# EAGLE schematic xio (EAGLE 9.1.0), part 1 of 2

## Sheet 1 of 16: Block diagram
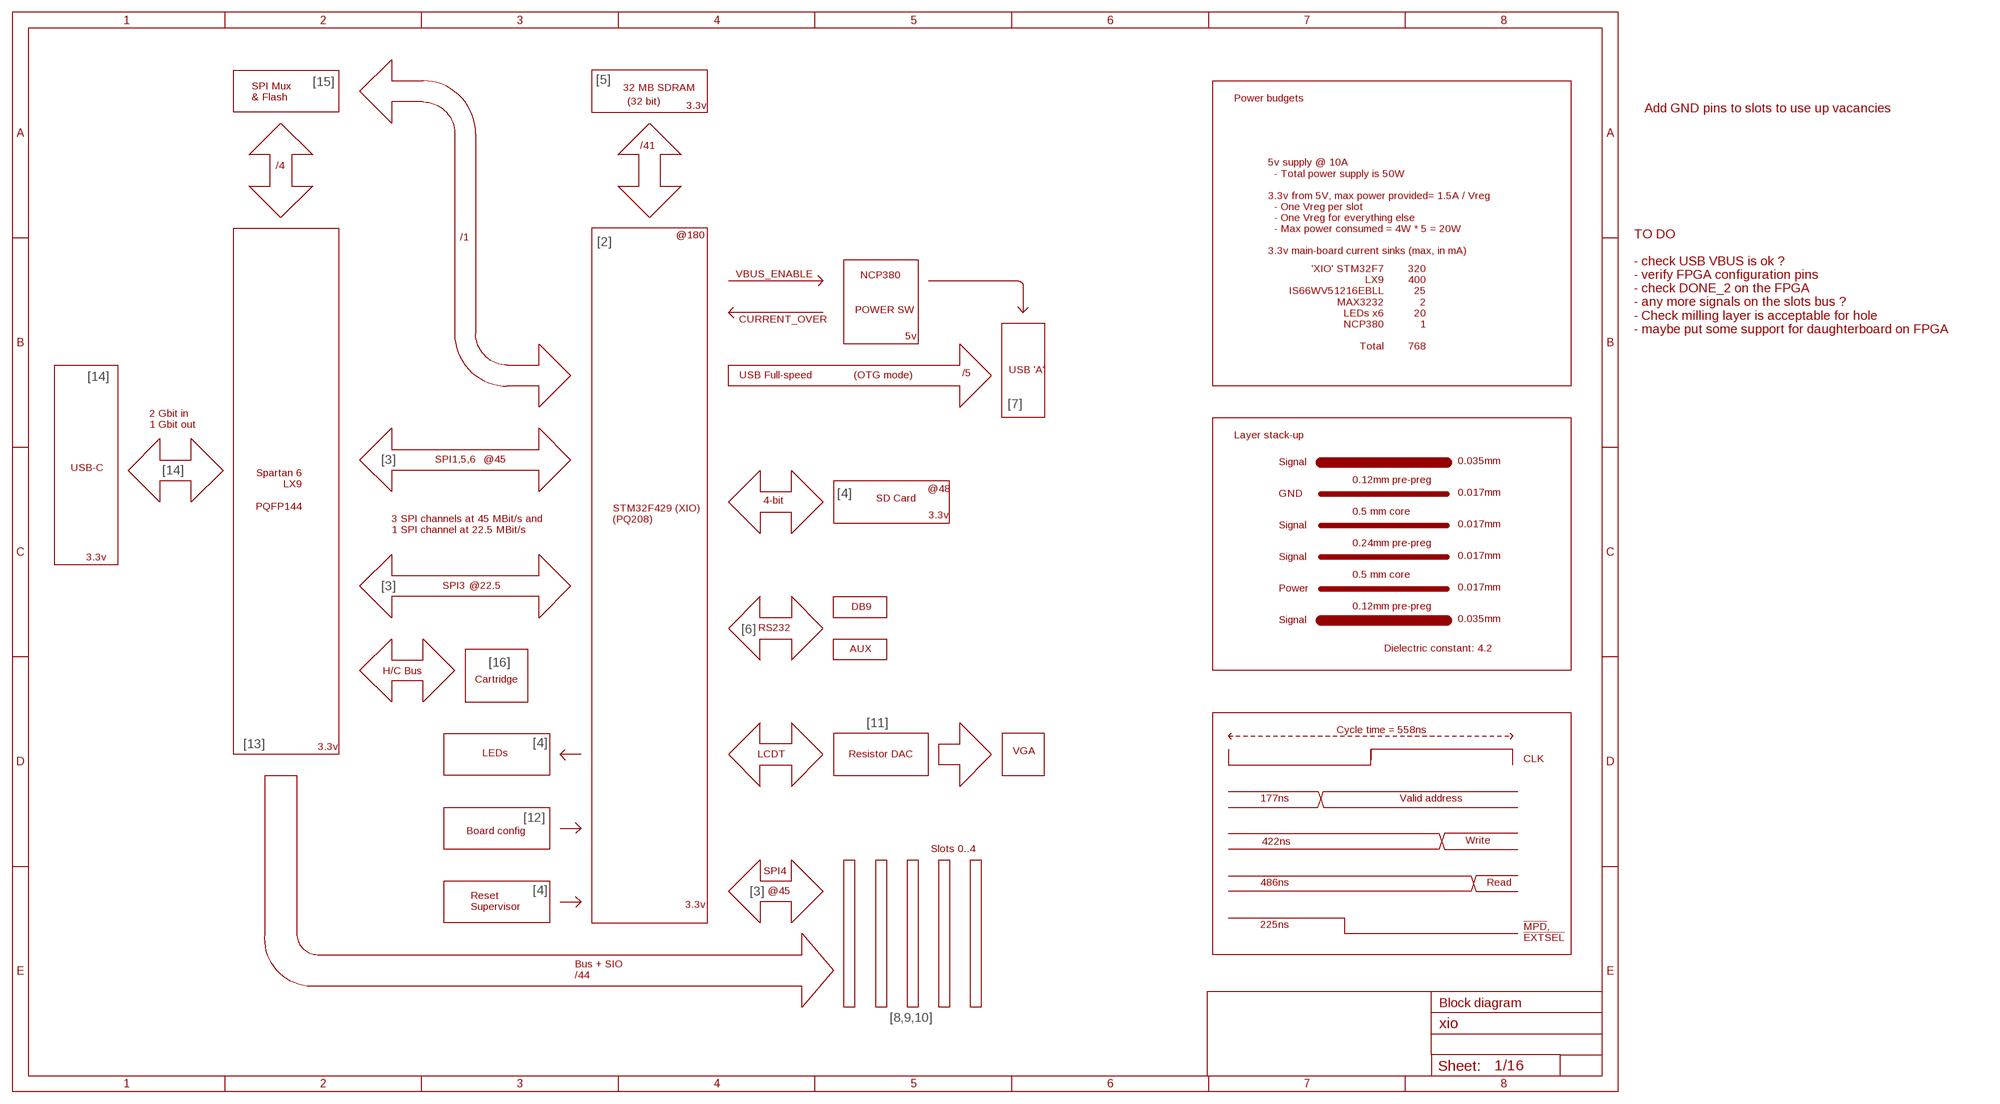
[diagram p0: schematic, sheet 1]

### Notes on the sheet
- [15] | [5]
- 32 MB SDRAM
- SPI Mux
  & Flash
- Power budgets
- (32 bit)
- 3.3v
- Add GND pins to slots to use up vacancies
- /41
- /4
- /1 | @180
- [2]
- 5v supply @ 10A
    - Total power supply is 50W
  
  3.3v from 5V, max power provided= 1.5A / Vreg
    - One Vreg per slot
    - One Vreg for everything else
    - Max power consumed = 4W * 5 = 20W 
  
  3.3v main-board current sinks (max, in mA)
- 'XIO' STM32F7
  LX9
  IS66WV51216EBLL
  MAX3232
  LEDs x6
  NCP380
  
  Total
- 320
  400
  25
  2
  20
  1
  
  768
- VBUS_ENABLE
- NCP380
- POWER SW
- CURRENT_OVER
- TO DO
  
  - check USB VBUS is ok ?
  - verify FPGA configuration pins
  - check DONE_2 on the FPGA
  - any more signals on the slots bus ?
  - Check milling layer is acceptable for hole
  - maybe put some support for daughterboard on FPGA
- 5v
- USB 'A'
- USB Full-speed | (OTG mode) | /5
- [14]
- [7]
- 2 Gbit in
  1 Gbit out
- Layer stack-up
- SPI1,5,6 | @45
- [3] | Signal | 0.035mm
- Spartan 6
      LX9
  
   PQFP144
- USB-C
- [14]
- 0.12mm pre-preg
- @48
- [4] | GND | 0.017mm
- 4-bit | SD Card
- 0.5 mm core
- 3.3v
- STM32F429 (XIO)
  (PQ208)
- Signal | 0.017mm
- 3 SPI channels at 45 MBit/s and
  1 SPI channel at 22.5 MBit/s
- 0.24mm pre-preg
- 3.3v | Signal | 0.017mm
- 0.5 mm core
- SPI3 | @22.5
- [3] | Power | 0.017mm
- DB9 | 0.12mm pre-preg
- Signal | 0.035mm
- [6] | RS232
- AUX | Dielectric constant: 4.2
- [16]
- H/C Bus
- Cartridge
- [11]
- Cycle time = 558ns
- [13] | [4]
- 3.3v
- LEDs | VGA
- LCDT | Resistor DAC
- CLK
- 177ns | Valid address
- [12]
- Board config
- 422ns | Write
- Slots 0..4
- SPI4
- @45 | 486ns | Read
- [4] | [3]
- 3.3v
- Reset
  Supervisor
- 225ns
- !MPD!,
  !EXTSEL!
- Bus + SIO
  /44
- Block diagram
- [8,9,10]

## Sheet 2 of 16: XIO Power
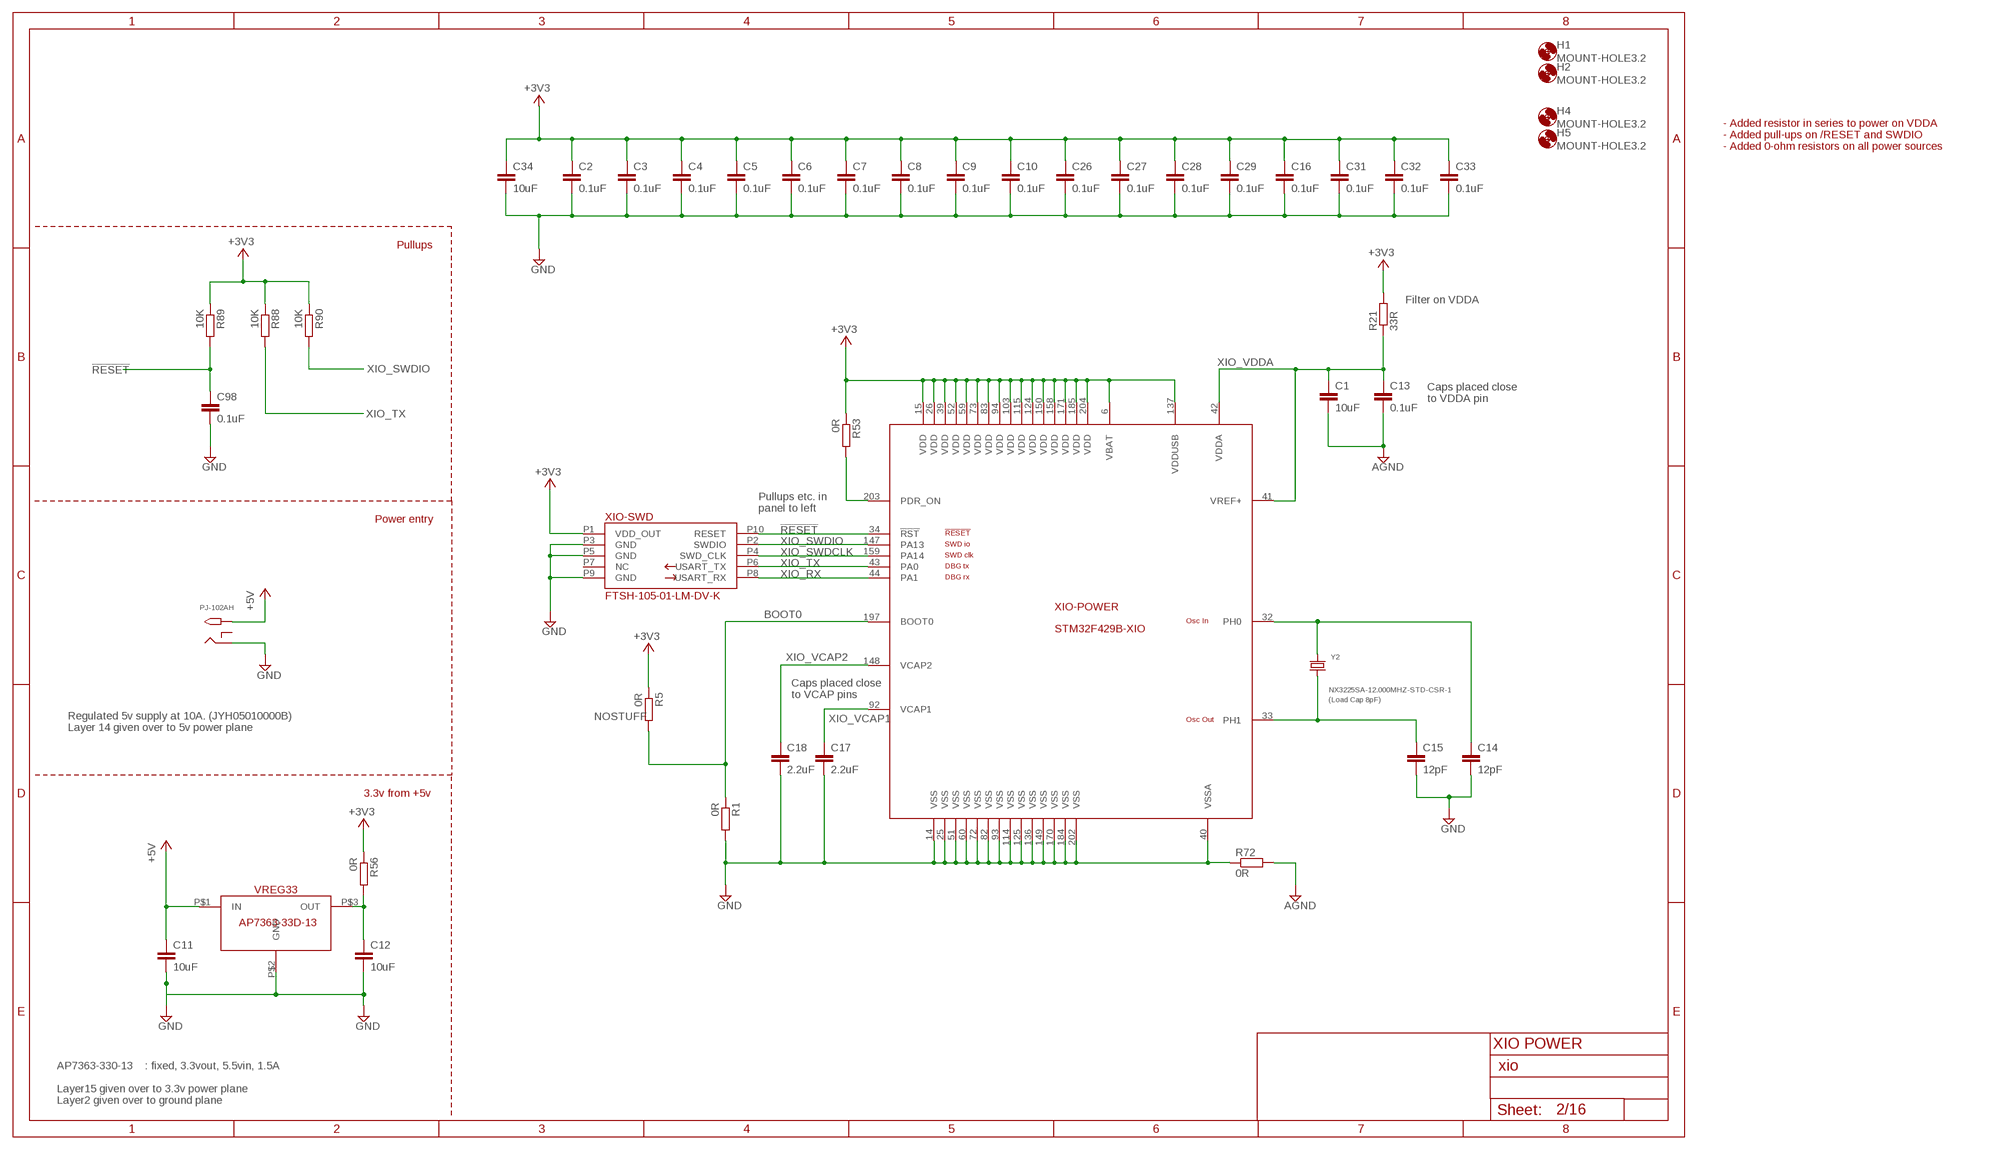
[diagram p1: schematic, sheet 2]

### Parts
C1  10uF  C-EUC0402K  [C0402K]
C2  0.1uF  C-EUC0402K  [C0402K]
C3  0.1uF  C-EUC0402K  [C0402K]
C4  0.1uF  C-EUC0402K  [C0402K]
C5  0.1uF  C-EUC0402K  [C0402K]
C6  0.1uF  C-EUC0402K  [C0402K]
C7  0.1uF  C-EUC0402K  [C0402K]
C8  0.1uF  C-EUC0402K  [C0402K]
C9  0.1uF  C-EUC0402K  [C0402K]
C10  0.1uF  C-EUC0402K  [C0402K]
C11  10uF  C-EUC0402K  [C0402K]
C12  10uF  C-EUC0402K  [C0402K]
C13  0.1uF  C-EUC0402K  [C0402K]
C14  12pF  C-EUC0402K  [C0402K]
C15  12pF  C-EUC0402K  [C0402K]
C16  0.1uF  C-EUC0402K  [C0402K]
C17  2.2uF  C-EUC0402K  [C0402K]
C18  2.2uF  C-EUC0402K  [C0402K]
C26  0.1uF  C-EUC0402K  [C0402K]
C27  0.1uF  C-EUC0402K  [C0402K]
C28  0.1uF  C-EUC0402K  [C0402K]
C29  0.1uF  C-EUC0402K  [C0402K]
C31  0.1uF  C-EUC0402K  [C0402K]
C32  0.1uF  C-EUC0402K  [C0402K]
C33  0.1uF  C-EUC0402K  [C0402K]
C34  10uF  C-EUC0402K  [C0402K]
C98  0.1uF  C-EUC0402K  [C0402K]
H1  MOUNT-HOLE3.2  [3,2]
H2  MOUNT-HOLE3.2  [3,2]
H4  MOUNT-HOLE3.2  [3,2]
H5  MOUNT-HOLE3.2  [3,2]
PJ-102AH  PJ-102AH  2.1MMJACKTHM  [PJ-102A]
R1  0R  R-EU_R0402  [R0402]
R5  0R  R-EU_R0402  [R0402]
R21  33R  R-EU_R0402  [R0402]
R53  0R  R-EU_R0402  [R0402]
R56  0R  R-EU_R0402  [R0402]
R72  0R  R-EU_R0402  [R0402]
R88  10K  R-EU_R0402  [R0402]
R89  10K  R-EU_R0402  [R0402]
R90  10K  R-EU_R0402  [R0402]
VREG33  AP7363-33D-13  AP7363  [TO252-3L]
XIO  STM32F429B-XIO  [PQFP208]
XIO-SWD  FTSH-105-01-LM-DV-K  STM_DEBUG  [SWD_DEBUG]
Y2  NX3225SA-12.000MHZ-STD-CSR-1  CRYSTALTHIN  [CRYSTAL_3.2X2.5]

### Nets
!RESET!: C98.1 R89.2 XIO-SWD.P10(RESET) XIO.34(-POWER:!RST!) ; also sheet 4
+3V3 [3v3]: C2.1 C3.1 C4.1 C5.1 C6.1 C7.1 C8.1 C9.1 C10.1 C16.1 C26.1 C27.1 C28.1 C29.1 C31.1 C32.1 C33.1 C34.1 R5.1 R21.2 R53.1 R56.1 R88.1 R89.1 R90.1 XIO-SWD.P1(VDD_OUT) XIO.6(-POWER:VBAT) XIO.15(-POWER:VDD) XIO.26(-POWER:VDD) XIO.39(-POWER:VDD) XIO.52(-POWER:VDD) XIO.59(-POWER:VDD) XIO.73(-POWER:VDD) XIO.83(-POWER:VDD) XIO.94(-POWER:VDD) XIO.103(-POWER:VDD) XIO.115(-POWER:VDD) XIO.124(-POWER:VDD) XIO.137(-POWER:VDDUSB) XIO.150(-POWER:VDD) XIO.158(-POWER:VDD) XIO.171(-POWER:VDD) XIO.185(-POWER:VDD) XIO.204(-POWER:VDD) ; also sheet 4,5,6,11,12,13,14,15,16
+5V: C11.1 PJ-102AH.TIP VREG33.P$1(IN) ; also sheet 7,8,9,10,11,16
AGND: C1.2 C13.2 R72.2
BOOT0: R1.1 R5.2 XIO.197(-POWER:BOOT0)
GND: C2.2 C3.2 C4.2 C5.2 C6.2 C7.2 C8.2 C9.2 C10.2 C11.2 C12.2 C14.2 C15.2 C16.2 C17.2 C18.2 C26.2 C27.2 C28.2 C29.2 C31.2 C32.2 C33.2 C34.2 C98.2 PJ-102AH.RING R1.2 R72.1 VREG33.P$2(GND) XIO-SWD.P3(GND) XIO-SWD.P5(GND) XIO-SWD.P9(GND) XIO.14(-POWER:VSS) XIO.25(-POWER:VSS) XIO.40(-POWER:VSSA) XIO.51(-POWER:VSS) XIO.60(-POWER:VSS) XIO.72(-POWER:VSS) XIO.82(-POWER:VSS) XIO.93(-POWER:VSS) XIO.114(-POWER:VSS) XIO.125(-POWER:VSS) XIO.136(-POWER:VSS) XIO.149(-POWER:VSS) XIO.170(-POWER:VSS) XIO.184(-POWER:VSS) XIO.202(-POWER:VSS) ; also sheet 4,5,6,7,8,9,10,11,12,13,14,15,16
N$1: C15.1 XIO.33(-POWER:PH1) Y2.1
N$2: C14.1 XIO.32(-POWER:PH0) Y2.2
N$9: C12.1 R56.2 VREG33.P$3(OUT)
PDR_ON: R53.2 XIO.203(-POWER:PDR_ON)
XIO_RX: XIO-SWD.P8(USART_RX) XIO.44(-POWER:PA1)
XIO_SWDCLK: XIO-SWD.P4(SWD_CLK) XIO.159(-POWER:PA14)
XIO_SWDIO: R90.2 XIO-SWD.P2(SWDIO) XIO.147(-POWER:PA13)
XIO_TX: R88.2 XIO-SWD.P6(USART_TX) XIO.43(-POWER:PA0)
XIO_VCAP1: C17.1 XIO.92(-POWER:VCAP1)
XIO_VCAP2: C18.1 XIO.148(-POWER:VCAP2)
XIO_VDDA: C1.1 C13.1 R21.1 XIO.41(-POWER:VREF+) XIO.42(-POWER:VDDA)
Unconnected: PJ-102AH.RING_SW XIO-SWD.P7(NC)

### Notes on the sheet
- - Added resistor in series to power on VDDA
  - Added pull-ups on /RESET and SWDIO
  - Added 0-ohm resistors on all power sources
- Pullups
- Filter on VDDA
- Caps placed close 
  to VDDA pin
- Pullups etc. in
  panel to left
- Power entry
- Caps placed close 
  to VCAP pins
- (Load Cap 8pF)
- Regulated 5v supply at 10A. (JYH05010000B)
  Layer 14 given over to 5v power plane
- 3.3v from +5v
- XIO POWER
- AP7363-330-13    : fixed, 3.3vout, 5.5vin, 1.5A
  
  Layer15 given over to 3.3v power plane
  Layer2 given over to ground plane

## Sheet 3 of 16: XIO SPI, IO-BUS
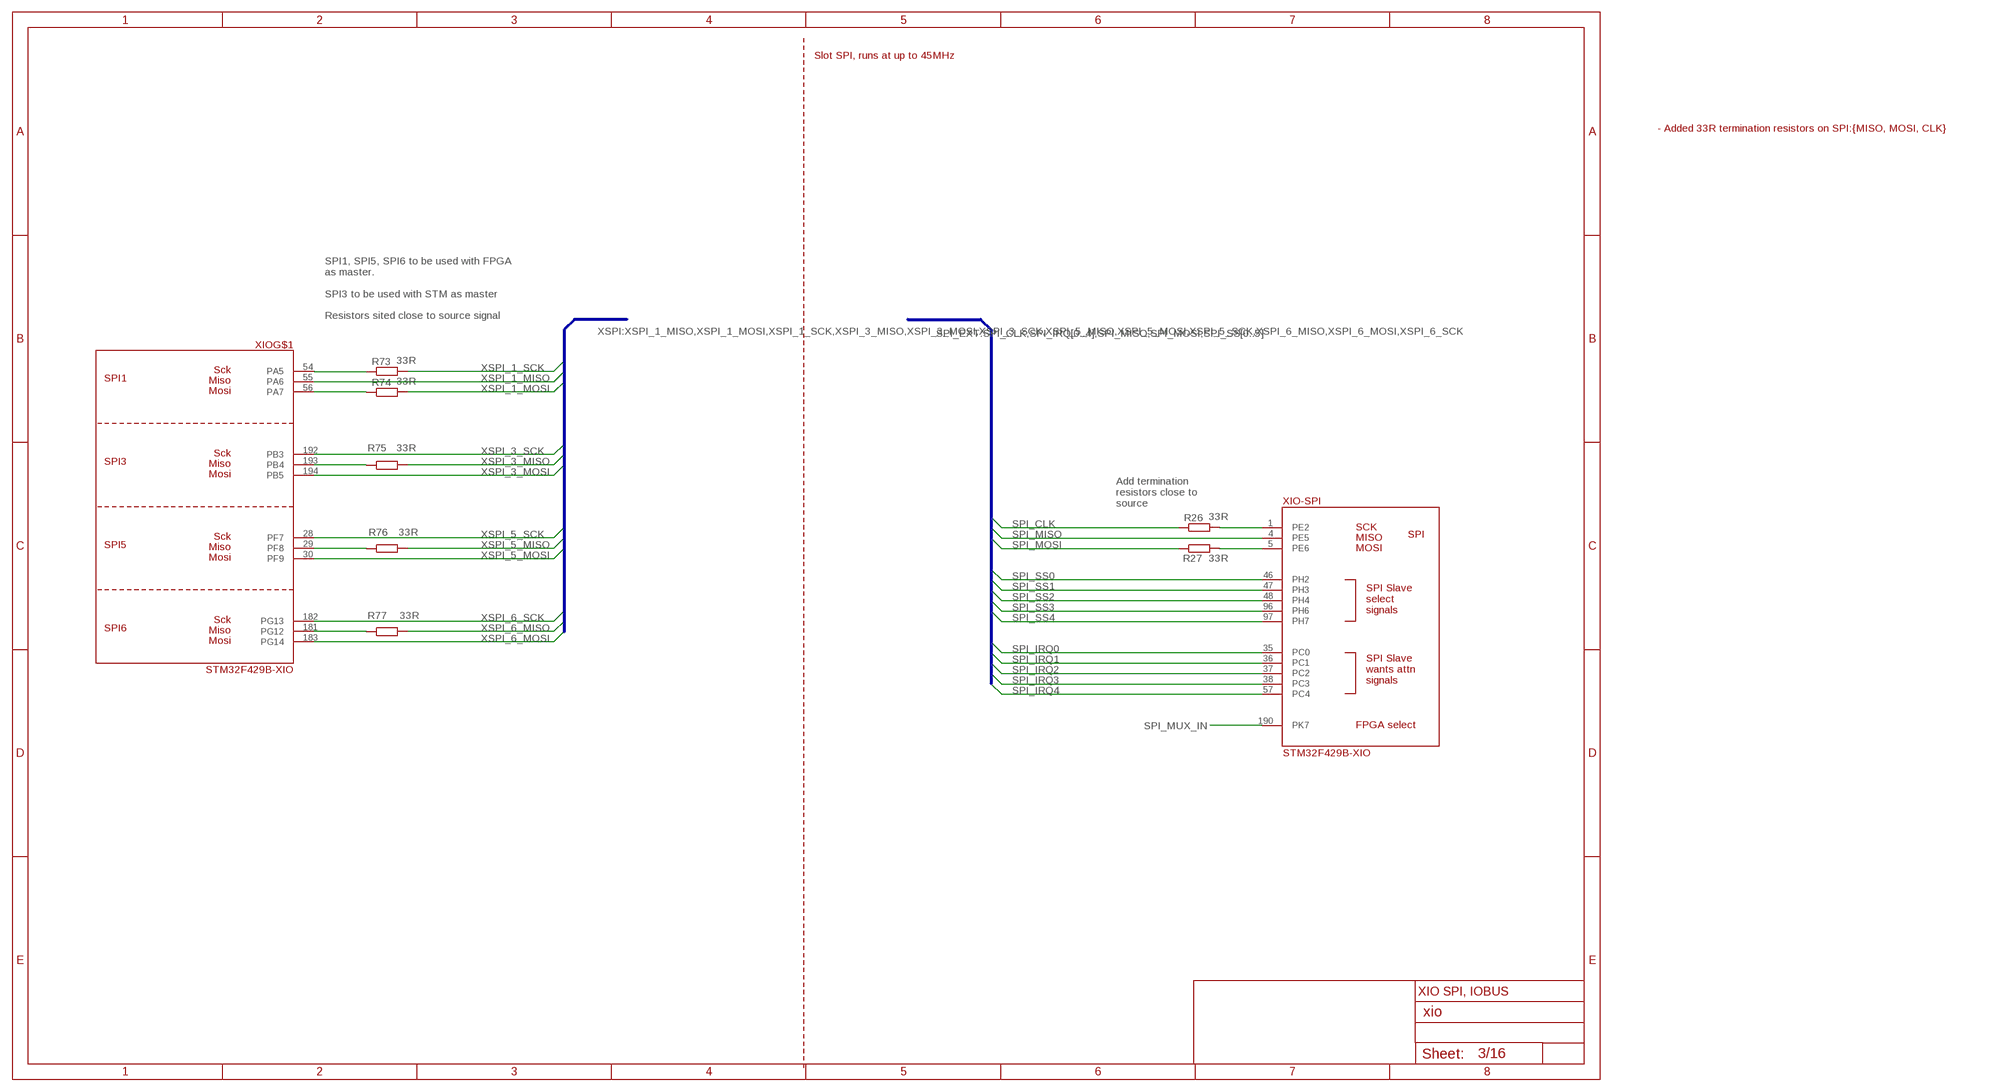
[diagram p2: schematic, sheet 3]

### Parts
R26  33R  R-EU_R0402  [R0402]
R27  33R  R-EU_R0402  [R0402]
R73  33R  R-EU_R0402  [R0402]
R74  33R  R-EU_R0402  [R0402]
R75  33R  R-EU_R0402  [R0402]
R76  33R  R-EU_R0402  [R0402]
R77  33R  R-EU_R0402  [R0402]

### Nets
N$57: R26.2 XIO.1(-SPI:PE2)
N$61: R27.2 XIO.5(-SPI:PE6)
N$72: R75.1 XIO.193(PB4)
N$73: R76.1 XIO.29(PF8)
N$74: R77.1 XIO.181(PG12)
N$75: R73.1 XIO.54(PA5)
N$76: R74.1 XIO.56(PA7)
SPI_CLK: R26.1 ; also sheet 8,9,10,15
SPI_IRQ0: XIO.35(-SPI:PC0) ; also sheet 8
SPI_IRQ1: XIO.36(-SPI:PC1) ; also sheet 8
SPI_IRQ2: XIO.37(-SPI:PC2) ; also sheet 9
SPI_IRQ3: XIO.38(-SPI:PC3) ; also sheet 9
SPI_IRQ4: XIO.57(-SPI:PC4) ; also sheet 10
SPI_MISO: XIO.4(-SPI:PE5) ; also sheet 8,9,10,15
SPI_MOSI: R27.1 ; also sheet 8,9,10,15
SPI_MUX_IN: XIO.190(-SPI:PK7) ; also sheet 15
SPI_SS0: XIO.46(-SPI:PH2) ; also sheet 8
SPI_SS1: XIO.47(-SPI:PH3) ; also sheet 8
SPI_SS2: XIO.48(-SPI:PH4) ; also sheet 9
SPI_SS3: XIO.96(-SPI:PH6) ; also sheet 9
SPI_SS4: XIO.97(-SPI:PH7) ; also sheet 10
XSPI_1_MISO: XIO.55(PA6) ; also sheet 14
XSPI_1_MOSI: R74.2 ; also sheet 14
XSPI_1_SCK: R73.2 ; also sheet 14
XSPI_3_MISO: R75.2 ; also sheet 14
XSPI_3_MOSI: XIO.194(PB5) ; also sheet 14
XSPI_3_SCK: XIO.192(PB3) ; also sheet 14
XSPI_5_MISO: R76.2 ; also sheet 14
XSPI_5_MOSI: XIO.30(PF9) ; also sheet 14
XSPI_5_SCK: XIO.28(PF7) ; also sheet 14
XSPI_6_MISO: R77.2 ; also sheet 14
XSPI_6_MOSI: XIO.183(PG14) ; also sheet 14
XSPI_6_SCK: XIO.182(PG13) ; also sheet 14

### Buses
SPI_EXT:SPI_CLK,SPI_IRQ[0..4],SPI_MISO,SPI_MOSI,SPI_SS[0..5]
XSPI:XSPI_1_MISO,XSPI_1_MOSI,XSPI_1_SCK,XSPI_3_MISO,XSPI_3_MOSI,XSPI_3_SCK,XSPI_5_MISO,XSPI_5_MOSI,XSPI_5_SCK,XSPI_6_MISO,XSPI_6_MOSI,XSPI_6_SCK

### Notes on the sheet
- Slot SPI, runs at up to 45MHz
- - Added 33R termination resistors on SPI:{MISO, MOSI, CLK}
- SPI1, SPI5, SPI6 to be used with FPGA
  as master. 
  
  SPI3 to be used with STM as master
  
  Resistors sited close to source signal
- Add termination 
  resistors close to
  source
- XIO SPI, IOBUS

## Sheet 4 of 16: Reset / GPIO / Leds / SD card
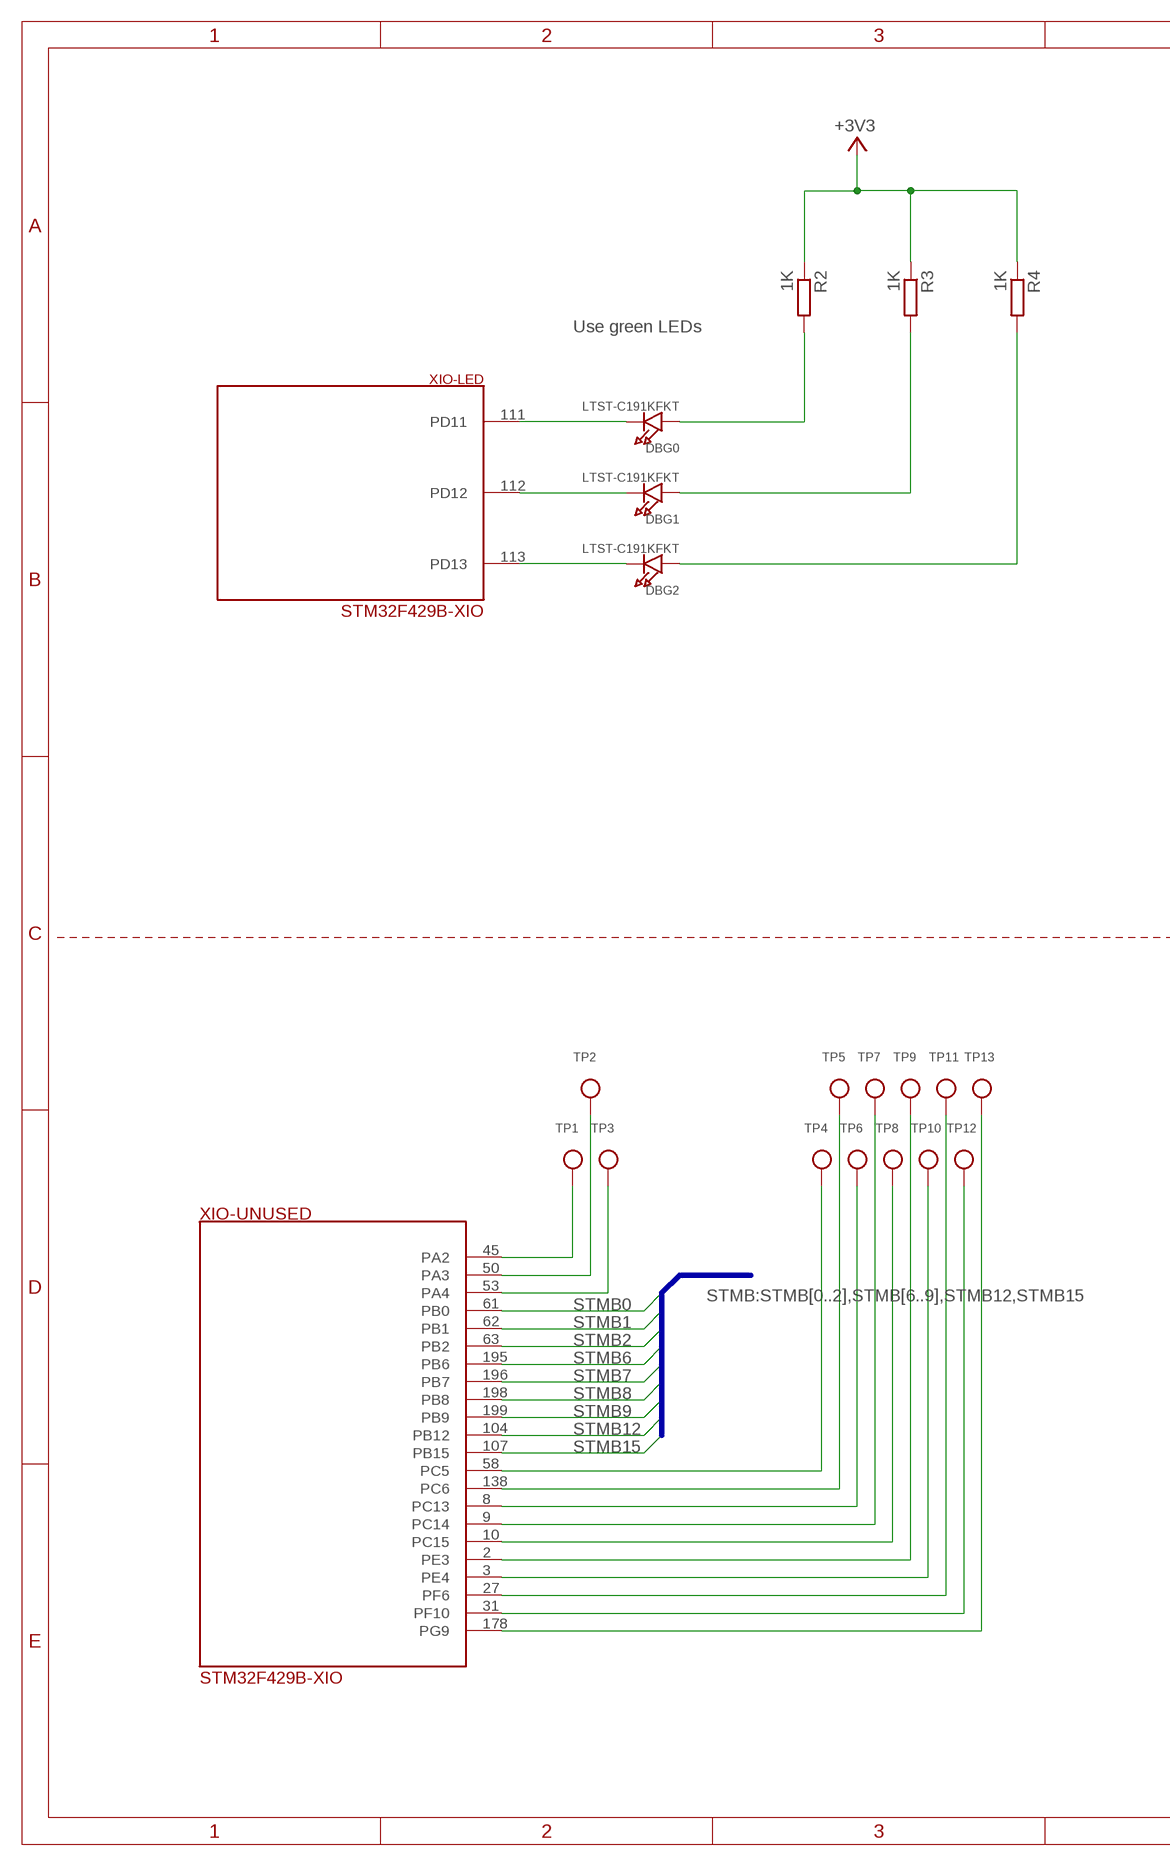
[diagram p3: schematic, sheet 4, part 1 of 2]
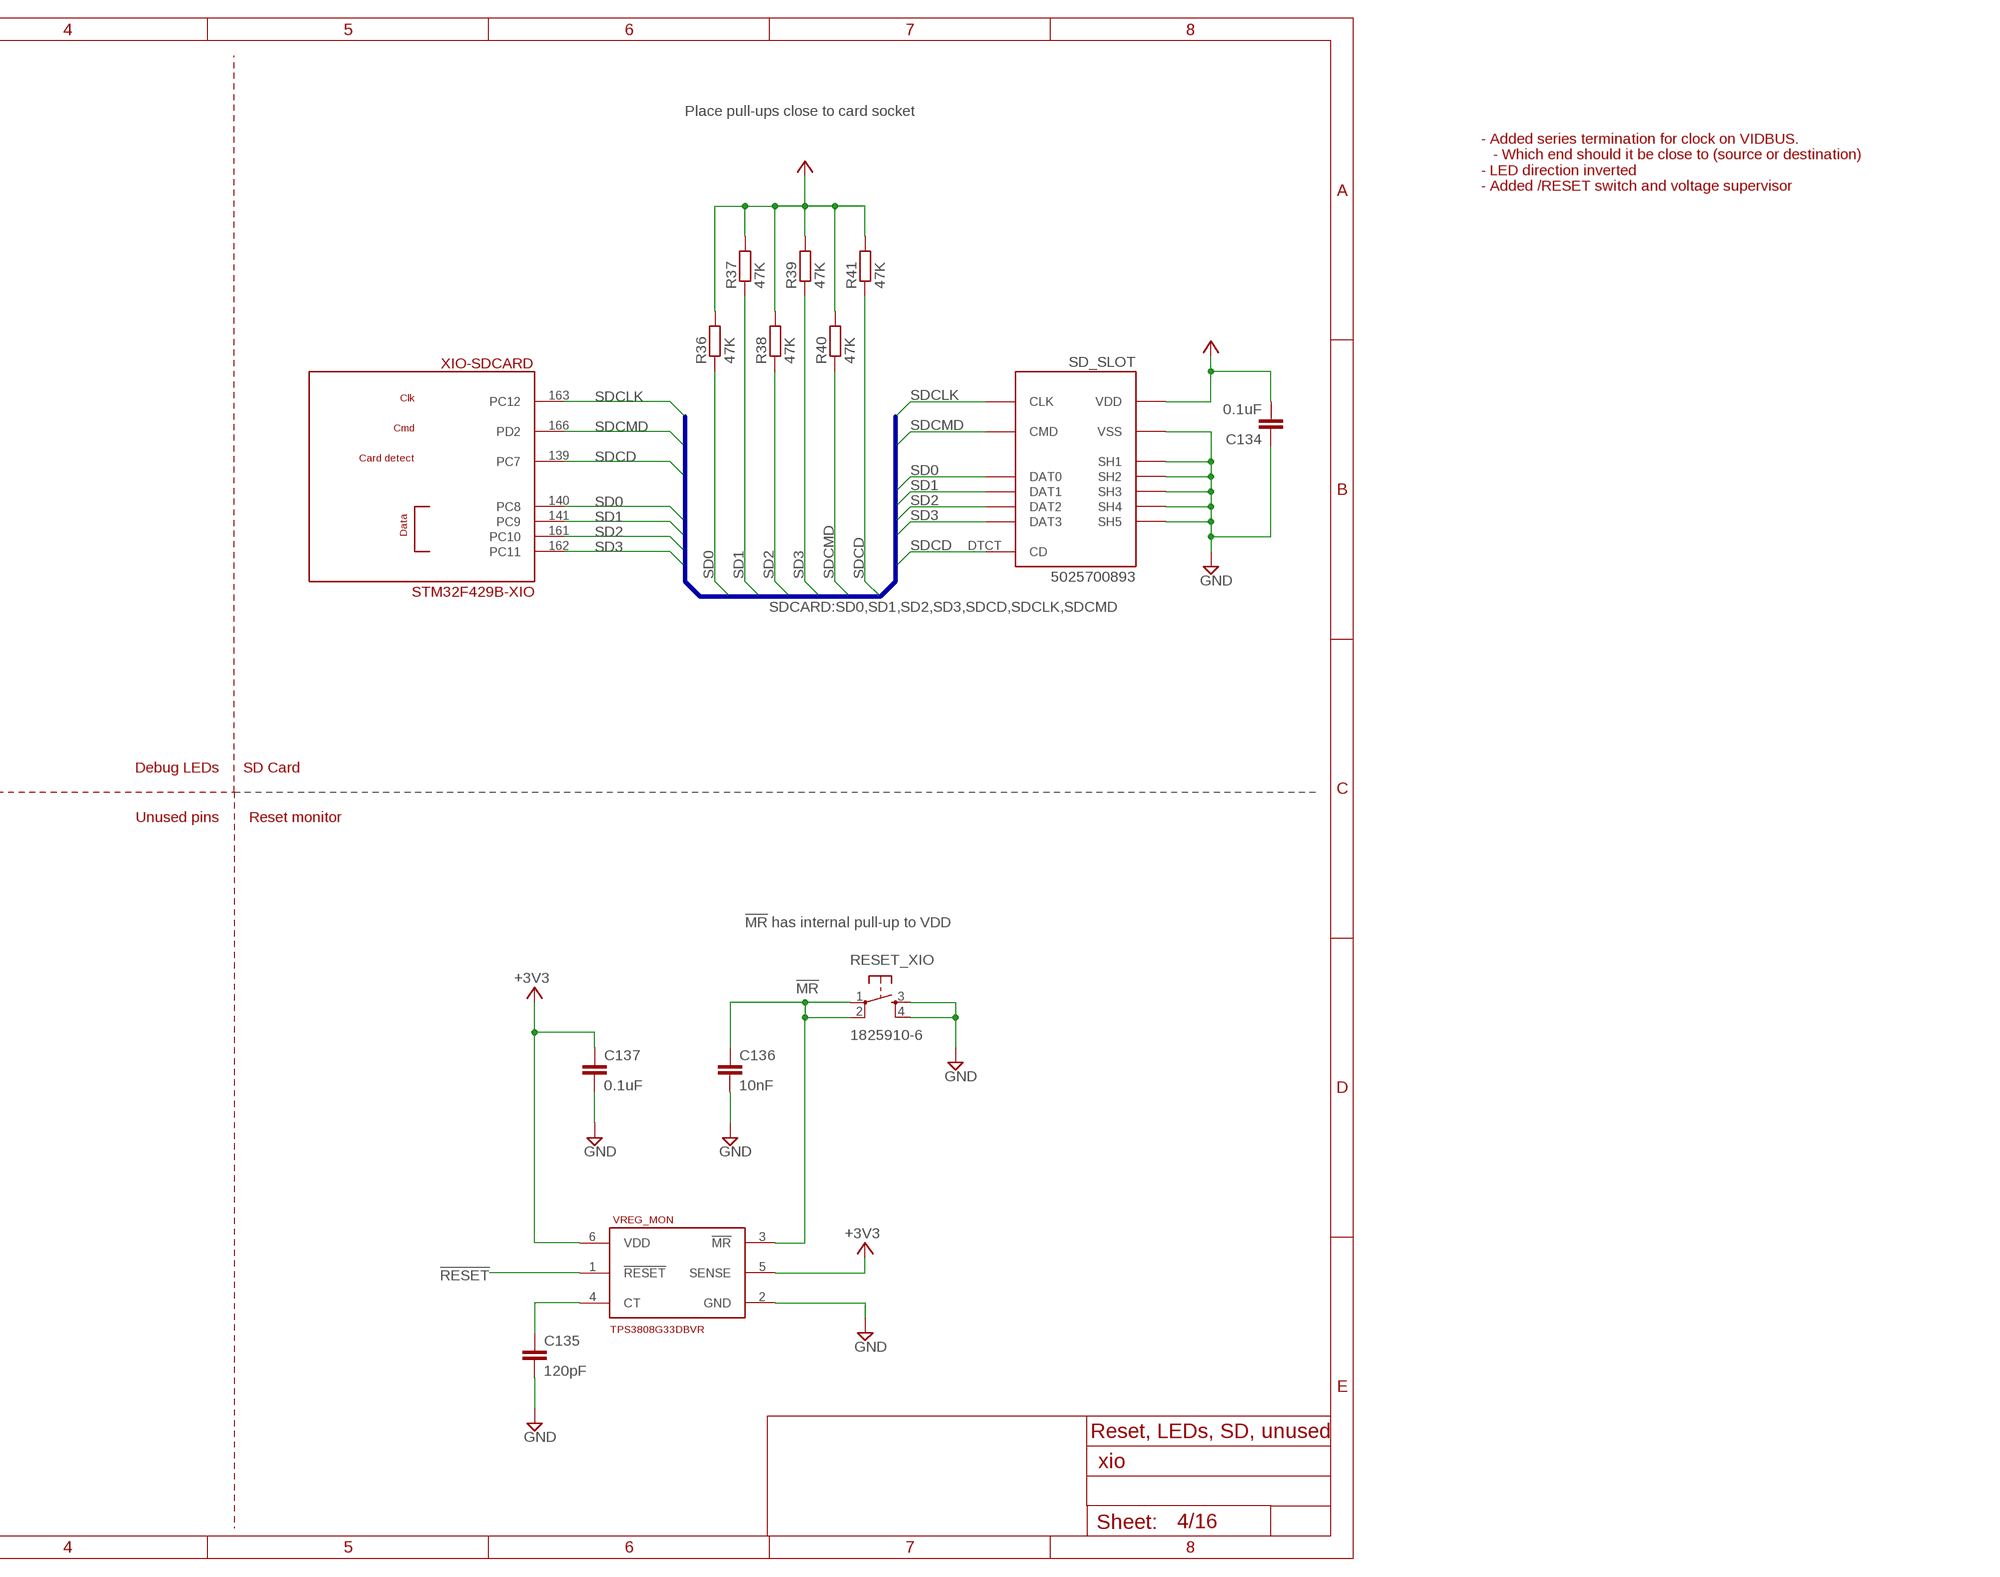
[diagram p4: schematic, sheet 4, part 2 of 2]

### Parts
C134  0.1uF  C-EUC0402K  [C0402K]
C135  120pF  C-EUC0402K  [C0402K]
C136  10nF  C-EUC0402K  [C0402K]
C137  0.1uF  C-EUC0402K  [C0402K]
DBG0  LTST-C191KFKT  LED0603  [CHIPLED_0603]
DBG1  LTST-C191KFKT  LED0603  [CHIPLED_0603]
DBG2  LTST-C191KFKT  LED0603  [CHIPLED_0603]
R2  1K  R-EU_R0402  [R0402]
R3  1K  R-EU_R0402  [R0402]
R4  1K  R-EU_R0402  [R0402]
R36  47K  R-EU_R0402  [R0402]
R37  47K  R-EU_R0402  [R0402]
R38  47K  R-EU_R0402  [R0402]
R39  47K  R-EU_R0402  [R0402]
R40  47K  R-EU_R0402  [R0402]
R41  47K  R-EU_R0402  [R0402]
RESET_XIO  1825910-6  TAC_SWITCHPTH  [TACTILE-PTH]
SD_SLOT  5025700893  MICROSD_MOLEX_5025700893  [5025700893]
TP1  TESTPOINTROUND0.5MM  [TESTPOINT_ROUND_0.5MM]
TP2  TESTPOINTROUND0.5MM  [TESTPOINT_ROUND_0.5MM]
TP3  TESTPOINTROUND0.5MM  [TESTPOINT_ROUND_0.5MM]
TP4  TESTPOINTROUND0.5MM  [TESTPOINT_ROUND_0.5MM]
TP5  TESTPOINTROUND0.5MM  [TESTPOINT_ROUND_0.5MM]
TP6  TESTPOINTROUND0.5MM  [TESTPOINT_ROUND_0.5MM]
TP7  TESTPOINTROUND0.5MM  [TESTPOINT_ROUND_0.5MM]
TP8  TESTPOINTROUND0.5MM  [TESTPOINT_ROUND_0.5MM]
TP9  TESTPOINTROUND0.5MM  [TESTPOINT_ROUND_0.5MM]
TP10  TESTPOINTROUND0.5MM  [TESTPOINT_ROUND_0.5MM]
TP11  TESTPOINTROUND0.5MM  [TESTPOINT_ROUND_0.5MM]
TP12  TESTPOINTROUND0.5MM  [TESTPOINT_ROUND_0.5MM]
TP13  TESTPOINTROUND0.5MM  [TESTPOINT_ROUND_0.5MM]
VREG_MON  TPS3808G33DBVR  TPS3808DBVR  [SOT23-6]

### Nets
!MR!: C136.1 RESET_XIO.1 RESET_XIO.2 VREG_MON.3(!MR!)
!RESET!: VREG_MON.1(!RESET!) ; also sheet 2
+3V3 [3v3]: C134.2 C137.1 R2.1 R3.1 R4.1 R36.2 R37.2 R38.2 R39.2 R40.2 R41.2 SD_SLOT.P$4(VDD) VREG_MON.5(SENSE) VREG_MON.6(VDD) ; also sheet 2,5,6,11,12,13,14,15,16
GND: C134.1 C135.2 C136.2 C137.2 RESET_XIO.3 RESET_XIO.4 SD_SLOT.GND0(SH1) SD_SLOT.GND1(SH2) SD_SLOT.GND2(SH3) SD_SLOT.GND3(SH4) SD_SLOT.GND4(SH5) SD_SLOT.P$6(VSS) VREG_MON.2(GND) ; also sheet 2,5,6,7,8,9,10,11,12,13,14,15,16
N$12: DBG0.A R2.2
N$13: DBG0.C XIO.111(-LED:PD11)
N$14: DBG1.C XIO.112(-LED:PD12)
N$15: DBG2.C XIO.113(-LED:PD13)
N$16: DBG1.A R3.2
N$19: DBG2.A R4.2
N$60: C135.1 VREG_MON.4(CT)
N$85: TP1.P$1 XIO.45(-UNUSED:PA2)
N$86: TP2.P$1 XIO.50(-UNUSED:PA3)
N$87: TP3.P$1 XIO.53(-UNUSED:PA4)
N$88: TP4.P$1 XIO.58(-UNUSED:PC5)
N$89: TP5.P$1 XIO.138(-UNUSED:PC6)
N$90: TP6.P$1 XIO.8(-UNUSED:PC13)
N$91: TP7.P$1 XIO.9(-UNUSED:PC14)
N$92: TP8.P$1 XIO.10(-UNUSED:PC15)
N$93: TP9.P$1 XIO.2(-UNUSED:PE3)
N$94: TP10.P$1 XIO.3(-UNUSED:PE4)
N$95: TP11.P$1 XIO.27(-UNUSED:PF6)
N$96: TP12.P$1 XIO.31(-UNUSED:PF10)
N$97: TP13.P$1 XIO.178(-UNUSED:PG9)
SD0: R36.1 SD_SLOT.P$7(DAT0) XIO.140(-SDCARD:PC8)
SD1: R37.1 SD_SLOT.P$8(DAT1) XIO.141(-SDCARD:PC9)
SD2: R38.1 SD_SLOT.P$1(DAT2) XIO.161(-SDCARD:PC10)
SD3: R39.1 SD_SLOT.P$2(DAT3) XIO.162(-SDCARD:PC11)
SDCD: R41.1 SD_SLOT.DTCT(CD) XIO.139(-SDCARD:PC7)
SDCLK: SD_SLOT.P$5(CLK) XIO.163(-SDCARD:PC12)
SDCMD: R40.1 SD_SLOT.P$3(CMD) XIO.166(-SDCARD:PD2)
STMB0: XIO.61(-UNUSED:PB0) ; also sheet 8,9,10
STMB1: XIO.62(-UNUSED:PB1) ; also sheet 8,9,10
STMB2: XIO.63(-UNUSED:PB2) ; also sheet 8,9,10
STMB6: XIO.195(-UNUSED:PB6) ; also sheet 8,9,10
STMB7: XIO.196(-UNUSED:PB7) ; also sheet 8,9,10
STMB8: XIO.198(-UNUSED:PB8) ; also sheet 8,9,10
STMB9: XIO.199(-UNUSED:PB9) ; also sheet 8,9,10
STMB12: XIO.104(-UNUSED:PB12) ; also sheet 8,9,10
STMB15: XIO.107(-UNUSED:PB15) ; also sheet 8,9,10

### Buses
SDCARD:SD0,SD1,SD2,SD3,SDCD,SDCLK,SDCMD
STMB:STMB[0..2],STMB[6..9],STMB12,STMB15

### Notes on the sheet
- Place pull-ups close to card socket
- - Added series termination for clock on VIDBUS. 
     - Which end should it be close to (source or destination) 
  - LED direction inverted
  - Added /RESET switch and voltage supervisor
- Use green LEDs
- Debug LEDs | SD Card
- Unused pins
- Reset monitor
- !MR! has internal pull-up to VDD
- Reset, LEDs, SD, unused

## Sheet 5 of 16: XIO SDRAM
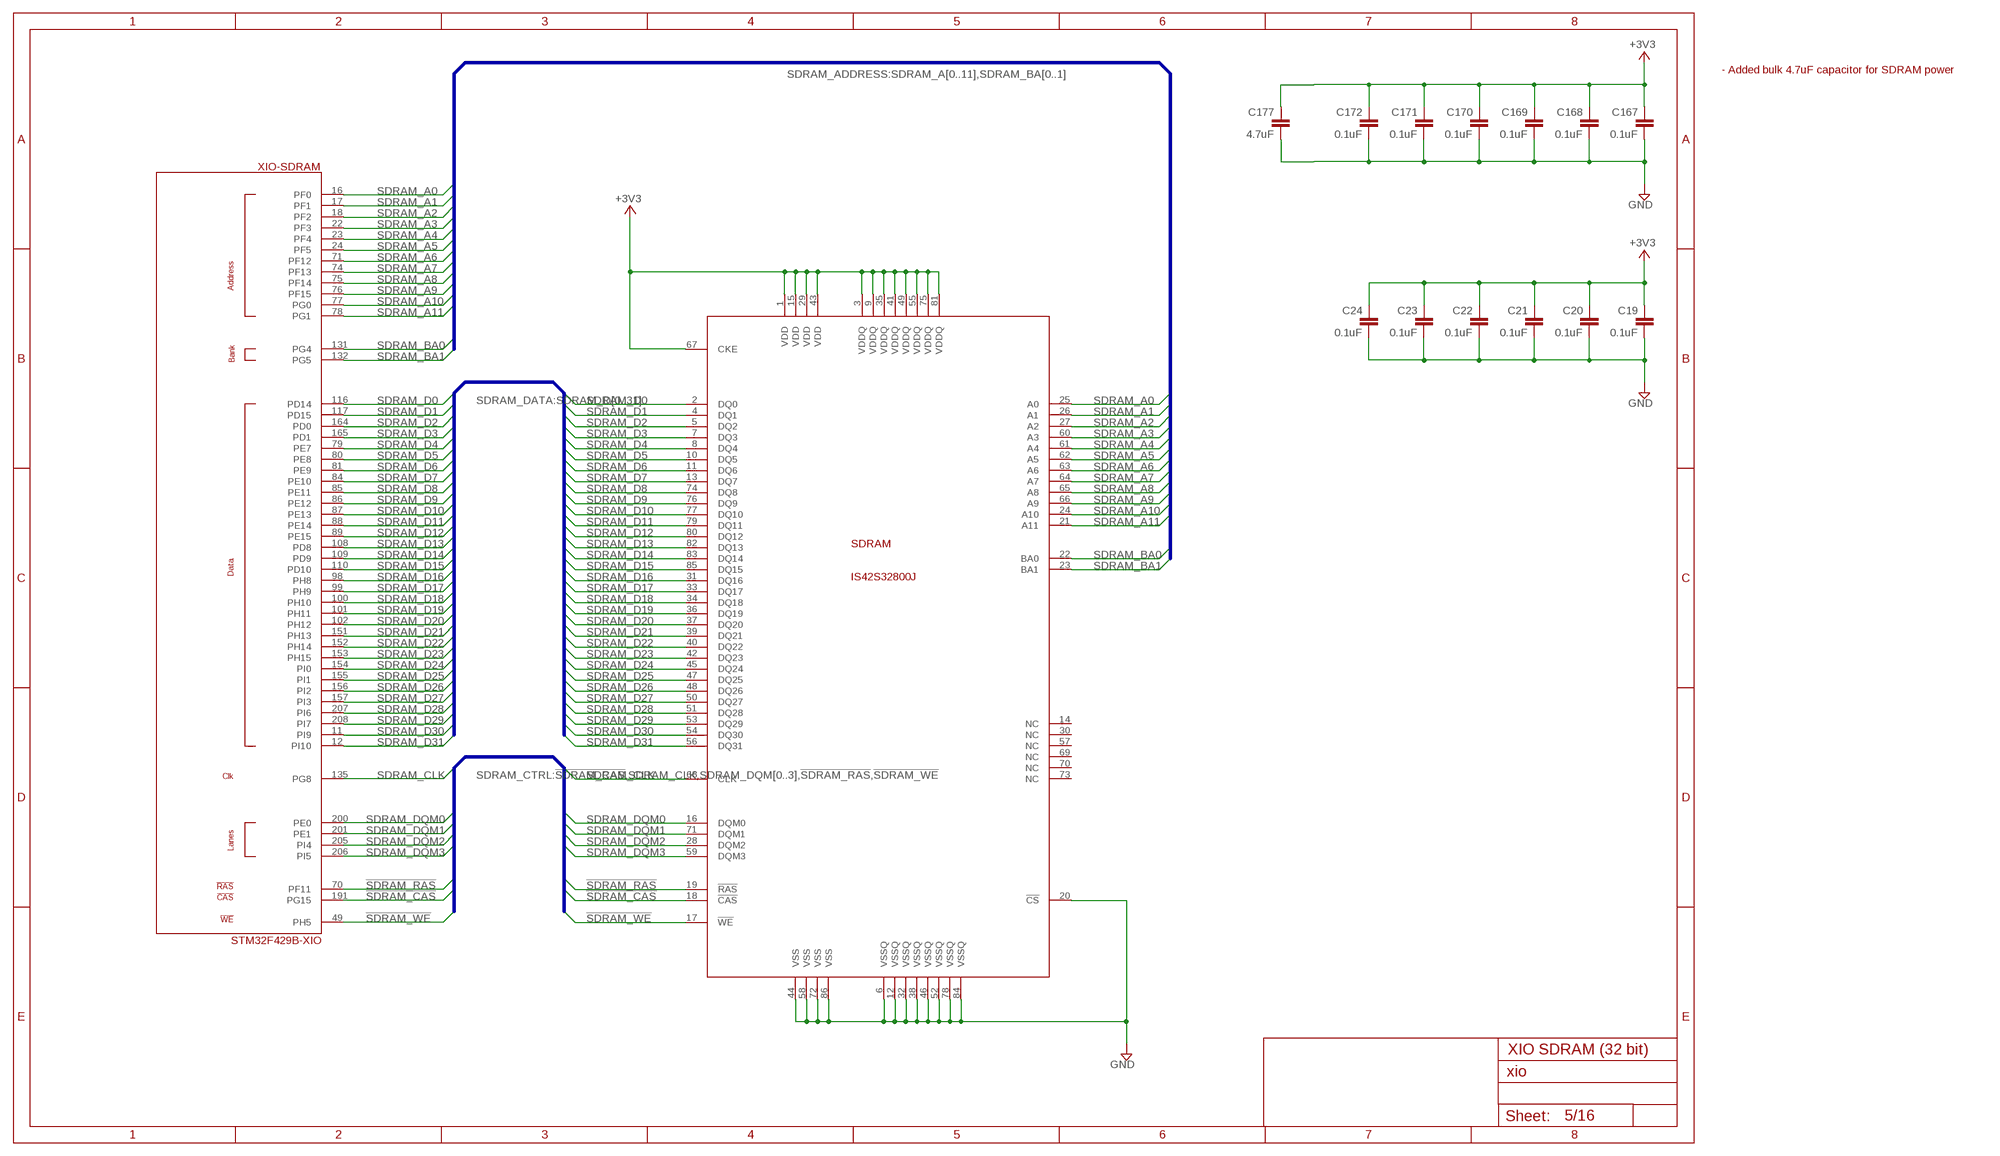
[diagram p5: schematic, sheet 5]

### Parts
C19  0.1uF  C-EUC0402K  [C0402K]
C20  0.1uF  C-EUC0402K  [C0402K]
C21  0.1uF  C-EUC0402K  [C0402K]
C22  0.1uF  C-EUC0402K  [C0402K]
C23  0.1uF  C-EUC0402K  [C0402K]
C24  0.1uF  C-EUC0402K  [C0402K]
C167  0.1uF  C-EUC0402K  [C0402K]
C168  0.1uF  C-EUC0402K  [C0402K]
C169  0.1uF  C-EUC0402K  [C0402K]
C170  0.1uF  C-EUC0402K  [C0402K]
C171  0.1uF  C-EUC0402K  [C0402K]
C172  0.1uF  C-EUC0402K  [C0402K]
C177  4.7uF  C-EUC0402K  [C0402K]
SDRAM  IS42S32800J  [SOP50P1176X120-86]

### Nets
!SDRAM_CAS!: SDRAM.18(!CAS!) XIO.191(-SDRAM:PG15)
!SDRAM_RAS!: SDRAM.19(!RAS!) XIO.70(-SDRAM:PF11)
!SDRAM_WE!: SDRAM.17(!WE!) XIO.49(-SDRAM:PH5)
+3V3 [3v3]: C19.1 C20.1 C21.1 C22.1 C23.1 C24.1 C167.1 C168.1 C169.1 C170.1 C171.1 C172.1 C177.1 SDRAM.1(VDD) SDRAM.3(VDDQ) SDRAM.9(VDDQ) SDRAM.15(VDD) SDRAM.29(VDD) SDRAM.35(VDDQ) SDRAM.41(VDDQ) SDRAM.43(VDD) SDRAM.49(VDDQ) SDRAM.55(VDDQ) SDRAM.67(CKE) SDRAM.75(VDDQ) SDRAM.81(VDDQ) ; also sheet 2,4,6,11,12,13,14,15,16
GND: C19.2 C20.2 C21.2 C22.2 C23.2 C24.2 C167.2 C168.2 C169.2 C170.2 C171.2 C172.2 C177.2 SDRAM.6(VSSQ) SDRAM.12(VSSQ) SDRAM.20(!CS!) SDRAM.32(VSSQ) SDRAM.38(VSSQ) SDRAM.44(VSS) SDRAM.46(VSSQ) SDRAM.52(VSSQ) SDRAM.58(VSS) SDRAM.72(VSS) SDRAM.78(VSSQ) SDRAM.84(VSSQ) SDRAM.86(VSS) ; also sheet 2,4,6,7,8,9,10,11,12,13,14,15,16
SDRAM_A0: SDRAM.25(A0) XIO.16(-SDRAM:PF0)
SDRAM_A1: SDRAM.26(A1) XIO.17(-SDRAM:PF1)
SDRAM_A2: SDRAM.27(A2) XIO.18(-SDRAM:PF2)
SDRAM_A3: SDRAM.60(A3) XIO.22(-SDRAM:PF3)
SDRAM_A4: SDRAM.61(A4) XIO.23(-SDRAM:PF4)
SDRAM_A5: SDRAM.62(A5) XIO.24(-SDRAM:PF5)
SDRAM_A6: SDRAM.63(A6) XIO.71(-SDRAM:PF12)
SDRAM_A7: SDRAM.64(A7) XIO.74(-SDRAM:PF13)
SDRAM_A8: SDRAM.65(A8) XIO.75(-SDRAM:PF14)
SDRAM_A9: SDRAM.66(A9) XIO.76(-SDRAM:PF15)
SDRAM_A10: SDRAM.24(A10) XIO.77(-SDRAM:PG0)
SDRAM_A11: SDRAM.21(A11) XIO.78(-SDRAM:PG1)
SDRAM_BA0: SDRAM.22(BA0) XIO.131(-SDRAM:PG4)
SDRAM_BA1: SDRAM.23(BA1) XIO.132(-SDRAM:PG5)
SDRAM_CLK: SDRAM.68(CLK) XIO.135(-SDRAM:PG8)
SDRAM_D0: SDRAM.2(DQ0) XIO.116(-SDRAM:PD14)
SDRAM_D1: SDRAM.4(DQ1) XIO.117(-SDRAM:PD15)
SDRAM_D2: SDRAM.5(DQ2) XIO.164(-SDRAM:PD0)
SDRAM_D3: SDRAM.7(DQ3) XIO.165(-SDRAM:PD1)
SDRAM_D4: SDRAM.8(DQ4) XIO.79(-SDRAM:PE7)
SDRAM_D5: SDRAM.10(DQ5) XIO.80(-SDRAM:PE8)
SDRAM_D6: SDRAM.11(DQ6) XIO.81(-SDRAM:PE9)
SDRAM_D7: SDRAM.13(DQ7) XIO.84(-SDRAM:PE10)
SDRAM_D8: SDRAM.74(DQ8) XIO.85(-SDRAM:PE11)
SDRAM_D9: SDRAM.76(DQ9) XIO.86(-SDRAM:PE12)
SDRAM_D10: SDRAM.77(DQ10) XIO.87(-SDRAM:PE13)
SDRAM_D11: SDRAM.79(DQ11) XIO.88(-SDRAM:PE14)
SDRAM_D12: SDRAM.80(DQ12) XIO.89(-SDRAM:PE15)
SDRAM_D13: SDRAM.82(DQ13) XIO.108(-SDRAM:PD8)
SDRAM_D14: SDRAM.83(DQ14) XIO.109(-SDRAM:PD9)
SDRAM_D15: SDRAM.85(DQ15) XIO.110(-SDRAM:PD10)
SDRAM_D16: SDRAM.31(DQ16) XIO.98(-SDRAM:PH8)
SDRAM_D17: SDRAM.33(DQ17) XIO.99(-SDRAM:PH9)
SDRAM_D18: SDRAM.34(DQ18) XIO.100(-SDRAM:PH10)
SDRAM_D19: SDRAM.36(DQ19) XIO.101(-SDRAM:PH11)
SDRAM_D20: SDRAM.37(DQ20) XIO.102(-SDRAM:PH12)
SDRAM_D21: SDRAM.39(DQ21) XIO.151(-SDRAM:PH13)
SDRAM_D22: SDRAM.40(DQ22) XIO.152(-SDRAM:PH14)
SDRAM_D23: SDRAM.42(DQ23) XIO.153(-SDRAM:PH15)
SDRAM_D24: SDRAM.45(DQ24) XIO.154(-SDRAM:PI0)
SDRAM_D25: SDRAM.47(DQ25) XIO.155(-SDRAM:PI1)
SDRAM_D26: SDRAM.48(DQ26) XIO.156(-SDRAM:PI2)
SDRAM_D27: SDRAM.50(DQ27) XIO.157(-SDRAM:PI3)
SDRAM_D28: SDRAM.51(DQ28) XIO.207(-SDRAM:PI6)
SDRAM_D29: SDRAM.53(DQ29) XIO.208(-SDRAM:PI7)
SDRAM_D30: SDRAM.54(DQ30) XIO.11(-SDRAM:PI9)
SDRAM_D31: SDRAM.56(DQ31) XIO.12(-SDRAM:PI10)
SDRAM_DQM0: SDRAM.16(DQM0) XIO.200(-SDRAM:PE0)
SDRAM_DQM1: SDRAM.71(DQM1) XIO.201(-SDRAM:PE1)
SDRAM_DQM2: SDRAM.28(DQM2) XIO.205(-SDRAM:PI4)
SDRAM_DQM3: SDRAM.59(DQM3) XIO.206(-SDRAM:PI5)
Unconnected: SDRAM.14(NC) SDRAM.30(NC) SDRAM.57(NC) SDRAM.69(NC) SDRAM.70(NC) SDRAM.73(NC)

### Buses
SDRAM_CTRL:!SDRAM_CAS!,SDRAM_CLK,SDRAM_DQM[0..3],!SDRAM_RAS!,!SDRAM_WE!
SDRAM_DATA:SDRAM_D[0..31]
SDRAM_ADDRESS:SDRAM_A[0..11],SDRAM_BA[0..1]

### Notes on the sheet
- - Added bulk 4.7uF capacitor for SDRAM power
- XIO SDRAM (32 bit)

## Sheet 6 of 16: XIO Serial I/O
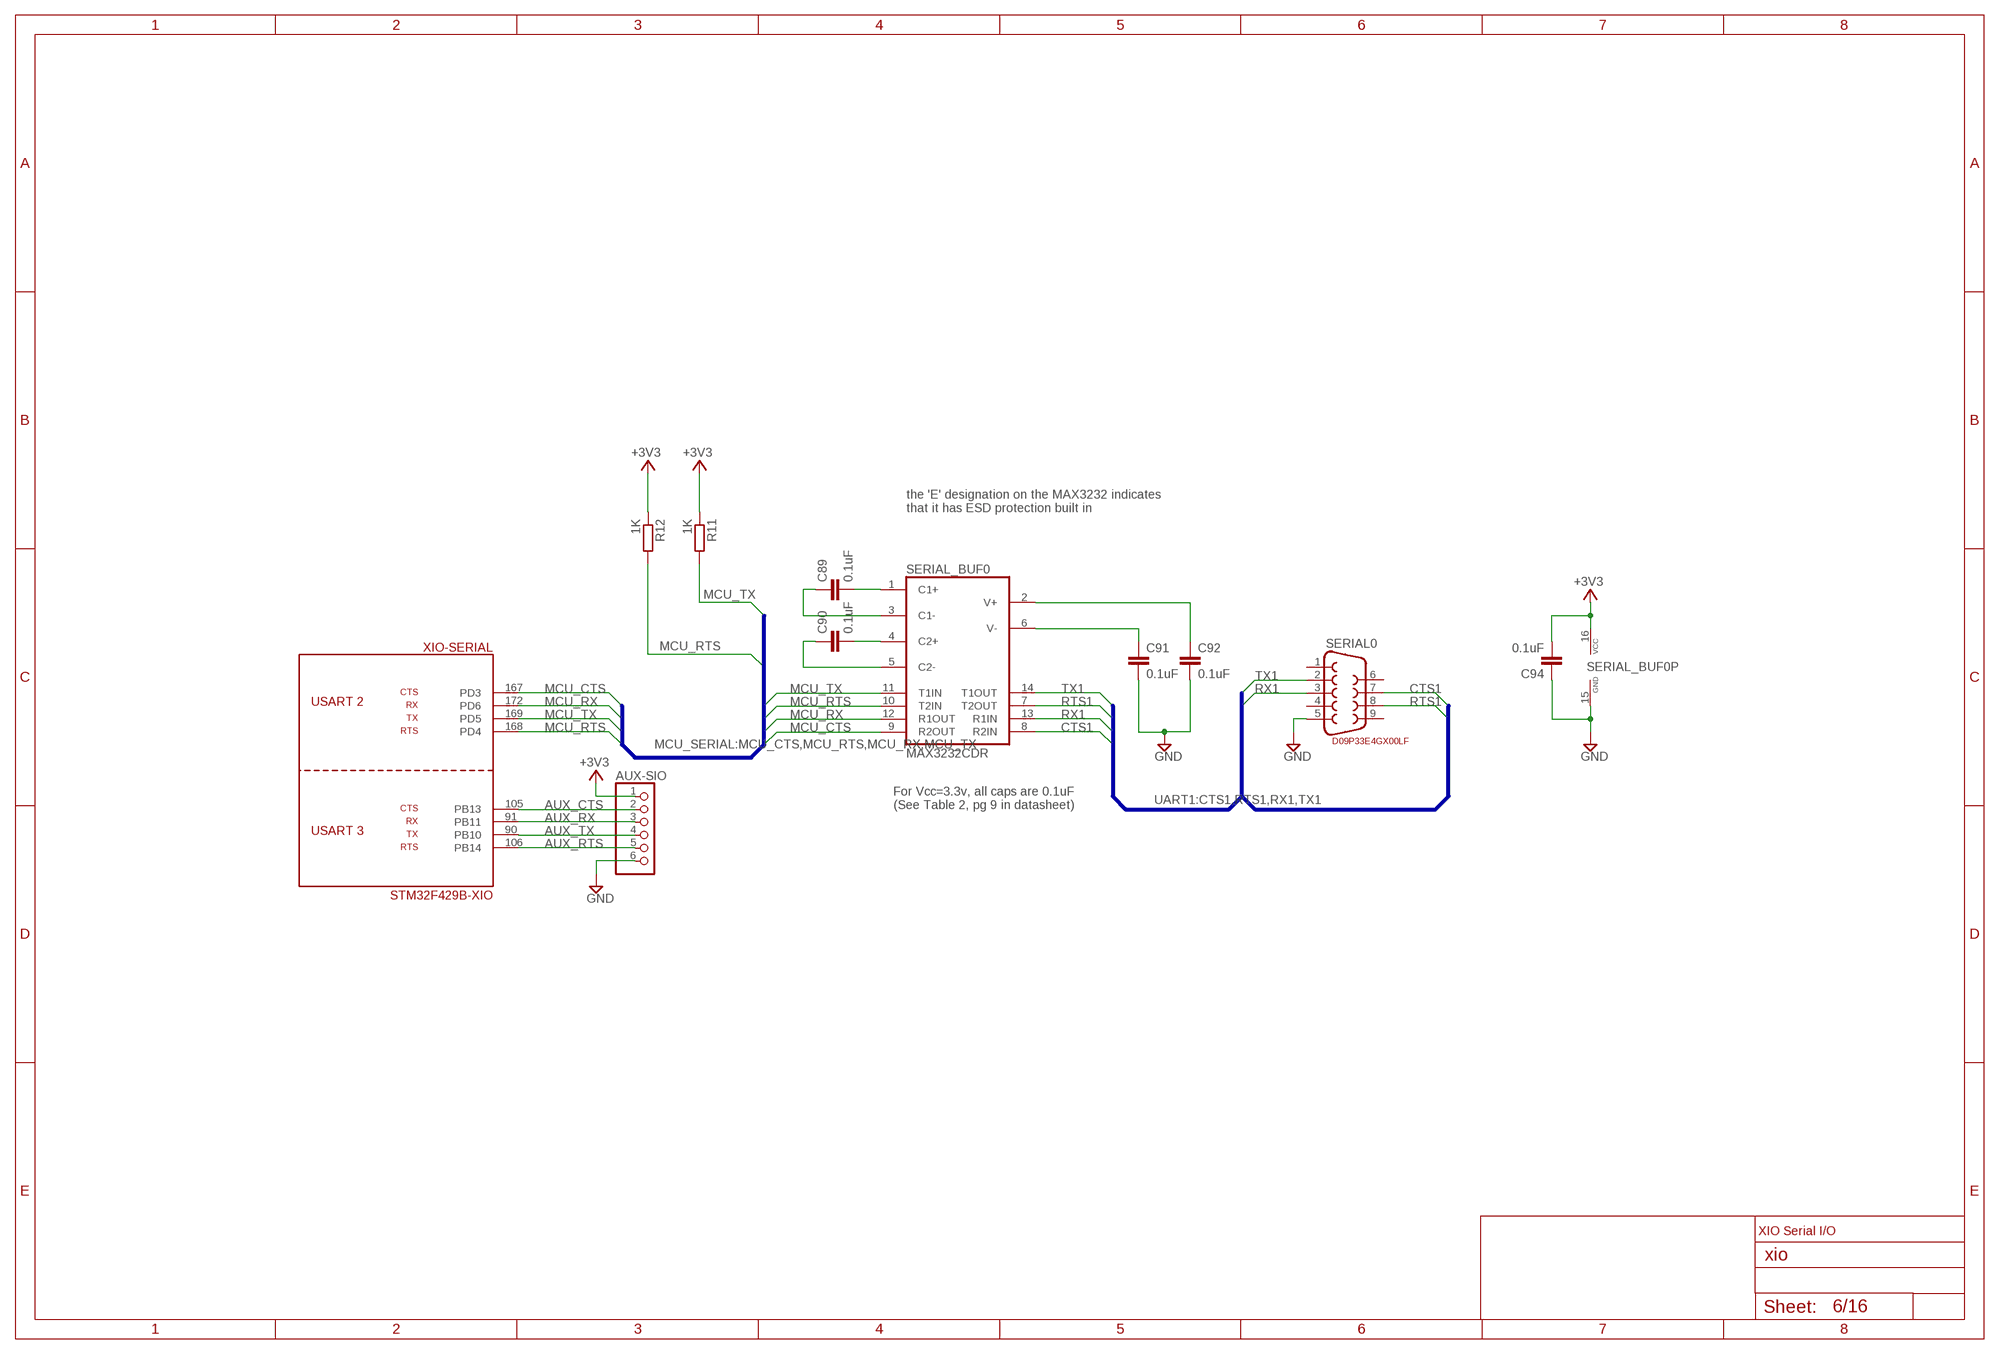
[diagram p6: schematic, sheet 6]

### Parts
AUX-SIO  PINHD-1X6  [1X06]
C89  0.1uF  C-EUC0402K  [C0402K]
C90  0.1uF  C-EUC0402K  [C0402K]
C91  0.1uF  C-EUC0402K  [C0402K]
C92  0.1uF  C-EUC0402K  [C0402K]
C94  0.1uF  C-EUC0402K  [C0402K]
R11  1K  R-EU_R0402  [R0402]
R12  1K  R-EU_R0402  [R0402]
SERIAL0  DB9  [DB9]
SERIAL_BUF0  MAX3232CDR  MAX3232CSE  [SO16]

### Nets
+3V3 [3v3]: AUX-SIO.1 C94.2 R11.1 R12.1 SERIAL_BUF0.16(VCC) ; also sheet 2,4,5,11,12,13,14,15,16
AUX_CTS: AUX-SIO.2 XIO.105(-SERIAL:PB13)
AUX_RTS: AUX-SIO.5 XIO.106(-SERIAL:PB14)
AUX_RX: AUX-SIO.3 XIO.91(-SERIAL:PB11)
AUX_TX: AUX-SIO.4 XIO.90(-SERIAL:PB10)
CTS1: SERIAL0.7 SERIAL_BUF0.8(R2IN)
GND: AUX-SIO.6 C91.2 C92.2 C94.1 SERIAL0.5 SERIAL_BUF0.15(GND) ; also sheet 2,4,5,7,8,9,10,11,12,13,14,15,16
MCU_CTS: SERIAL_BUF0.9(R2OUT) XIO.167(-SERIAL:PD3)
MCU_RTS: R12.2 SERIAL_BUF0.10(T2IN) XIO.168(-SERIAL:PD4)
MCU_RX: SERIAL_BUF0.12(R1OUT) XIO.172(-SERIAL:PD6)
MCU_TX: R11.2 SERIAL_BUF0.11(T1IN) XIO.169(-SERIAL:PD5)
N$28: C89.2 SERIAL_BUF0.1(C1+)
N$29: C89.1 SERIAL_BUF0.3(C1-)
N$30: C90.2 SERIAL_BUF0.4(C2+)
N$31: C90.1 SERIAL_BUF0.5(C2-)
N$32: C91.1 SERIAL_BUF0.6(V-)
N$33: C92.1 SERIAL_BUF0.2(V+)
RTS1: SERIAL0.8 SERIAL_BUF0.7(T2OUT)
RX1: SERIAL0.3 SERIAL_BUF0.13(R1IN)
TX1: SERIAL0.2 SERIAL_BUF0.14(T1OUT)
Unconnected: SERIAL0.1 SERIAL0.4 SERIAL0.6 SERIAL0.9

### Buses
UART1:CTS1,RTS1,RX1,TX1
MCU_SERIAL:MCU_CTS,MCU_RTS,MCU_RX,MCU_TX

### Notes on the sheet
- the 'E' designation on the MAX3232 indicates
  that it has ESD protection built in
- D09P33E4GX00LF
- For Vcc=3.3v, all caps are 0.1uF
  (See Table 2, pg 9 in datasheet)
- XIO Serial I/O

## Sheet 7 of 16: XIO USB OTG
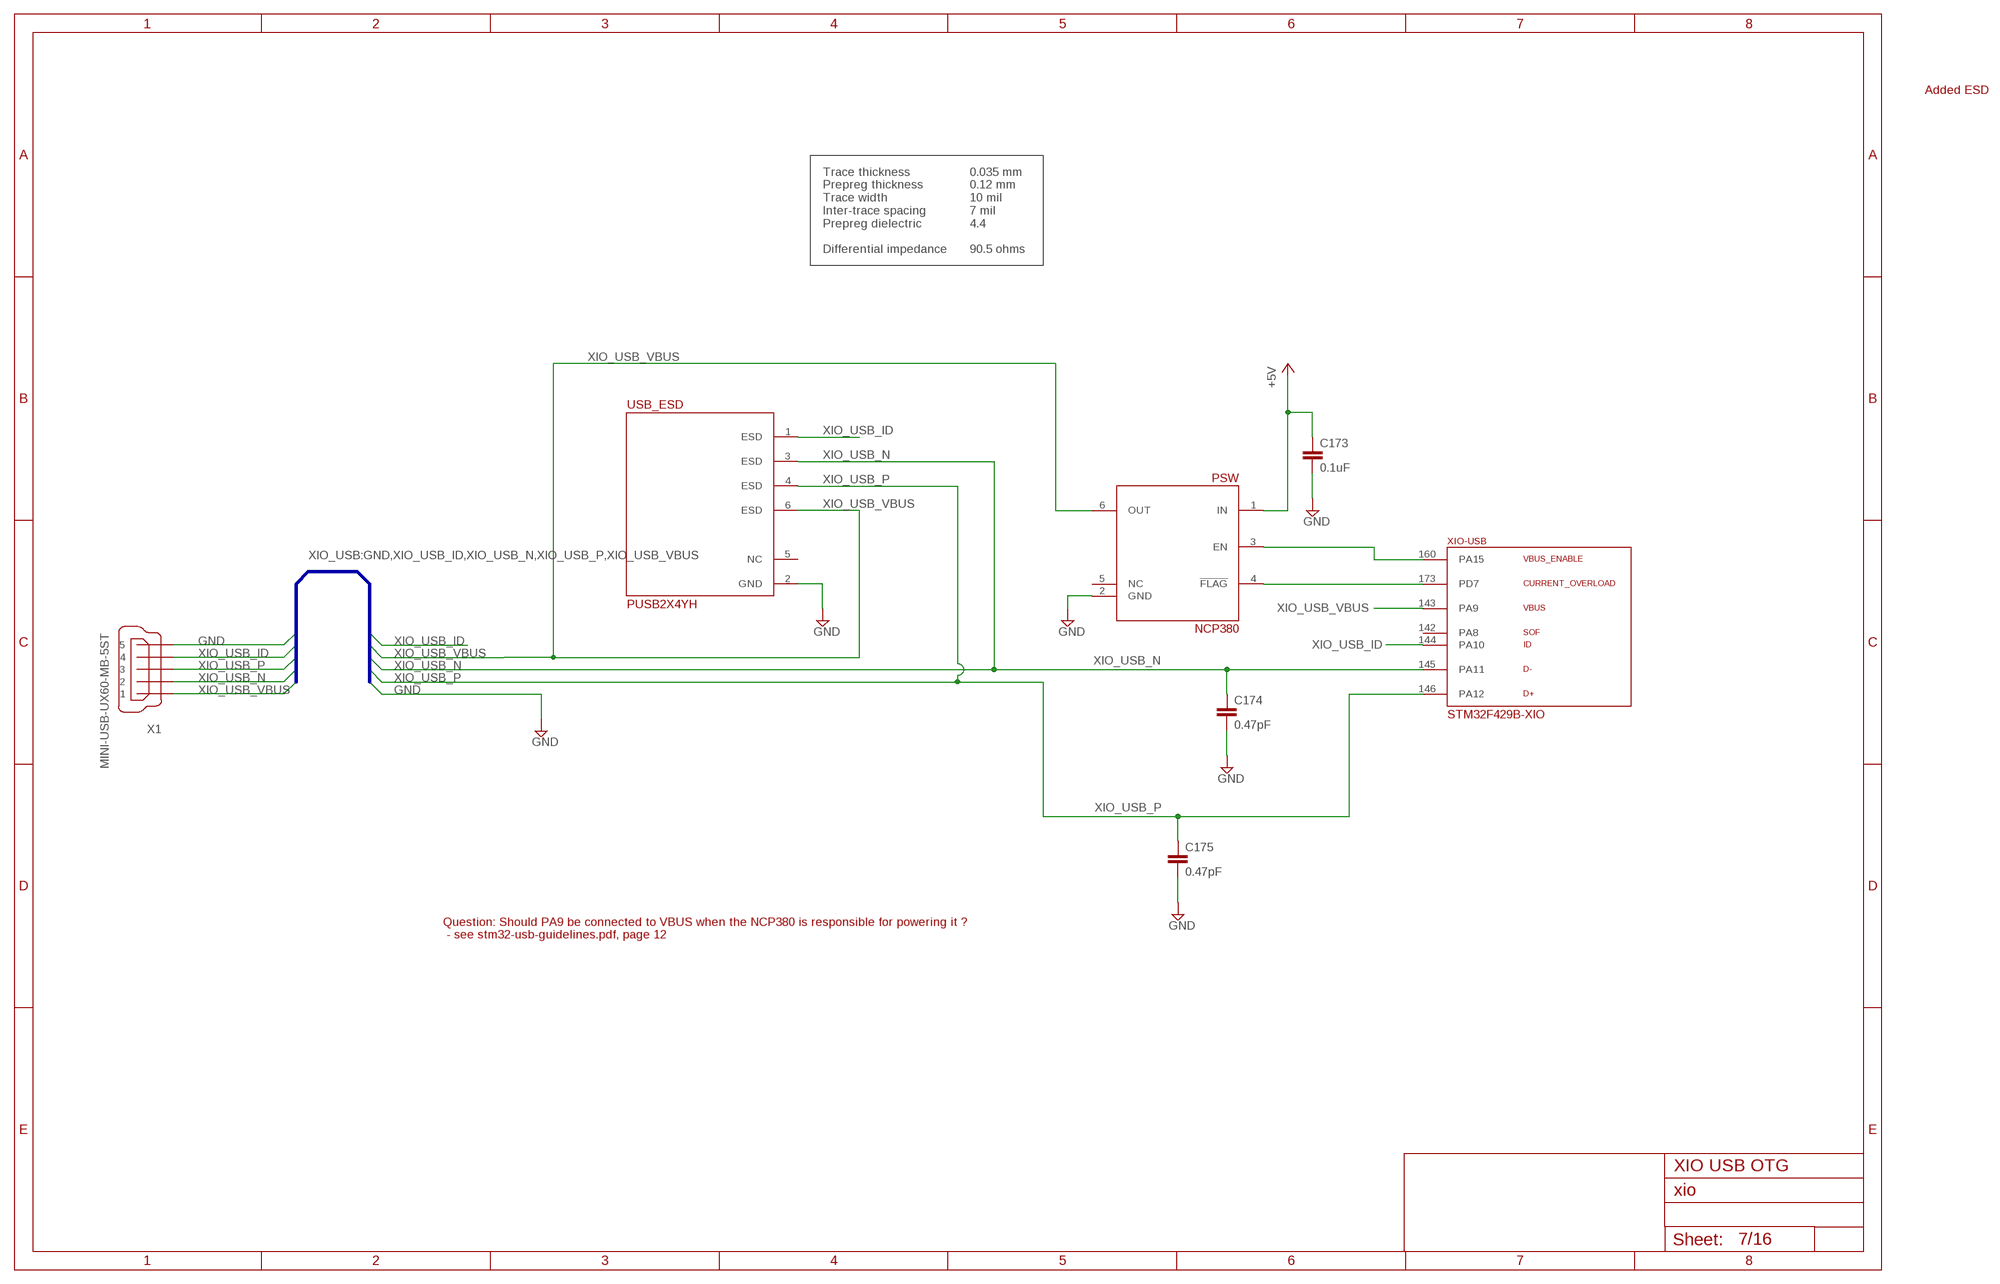
[diagram p7: schematic, sheet 7]

### Parts
C173  0.1uF  C-EUC0402K  [C0402K]
C174  0.47pF  C-EUC0402K  [C0402K]
C175  0.47pF  C-EUC0402K  [C0402K]
PSW  NCP380  [SOT23-6]
USB_ESD  PUSB2X4YH  [SOT363]
X1  MINI-USB-UX60-MB-5ST  [UX60-MB-5ST]

### Nets
+5V: C173.1 PSW.1(IN) ; also sheet 2,8,9,10,11,16
GND: C173.2 C174.2 C175.2 PSW.2(GND) USB_ESD.2(GND) X1.5 ; also sheet 2,4,5,6,8,9,10,11,12,13,14,15,16
N$64: PSW.3(EN) XIO.160(-USB:PA15)
N$65: PSW.4(!FLAG!) XIO.173(-USB:PD7)
XIO_USB_ID: USB_ESD.1(ESD) X1.4 XIO.144(-USB:PA10)
XIO_USB_N [usb90]: C174.1 USB_ESD.3(ESD) X1.2 XIO.145(-USB:PA11)
XIO_USB_P [usb90]: C175.1 USB_ESD.4(ESD) X1.3 XIO.146(-USB:PA12)
XIO_USB_VBUS: PSW.6(OUT) USB_ESD.6(ESD) X1.1 XIO.143(-USB:PA9)
Unconnected: PSW.5(NC) USB_ESD.5(NC) XIO.142(-USB:PA8)

### Buses
XIO_USB:GND,XIO_USB_ID,XIO_USB_N,XIO_USB_P,XIO_USB_VBUS

### Notes on the sheet
- Added ESD
- Trace thickness
  Prepreg thickness
  Trace width
  Inter-trace spacing
  Prepreg dielectric
  
  Differential impedance
- 0.035 mm
  0.12 mm
  10 mil
  7 mil
  4.4
  
  90.5 ohms
- Question: Should PA9 be connected to VBUS when the NCP380 is responsible for powering it ?
   - see stm32-usb-guidelines.pdf, page 12
- XIO USB OTG

## Sheet 8 of 16: Expansion slots 0 & 1
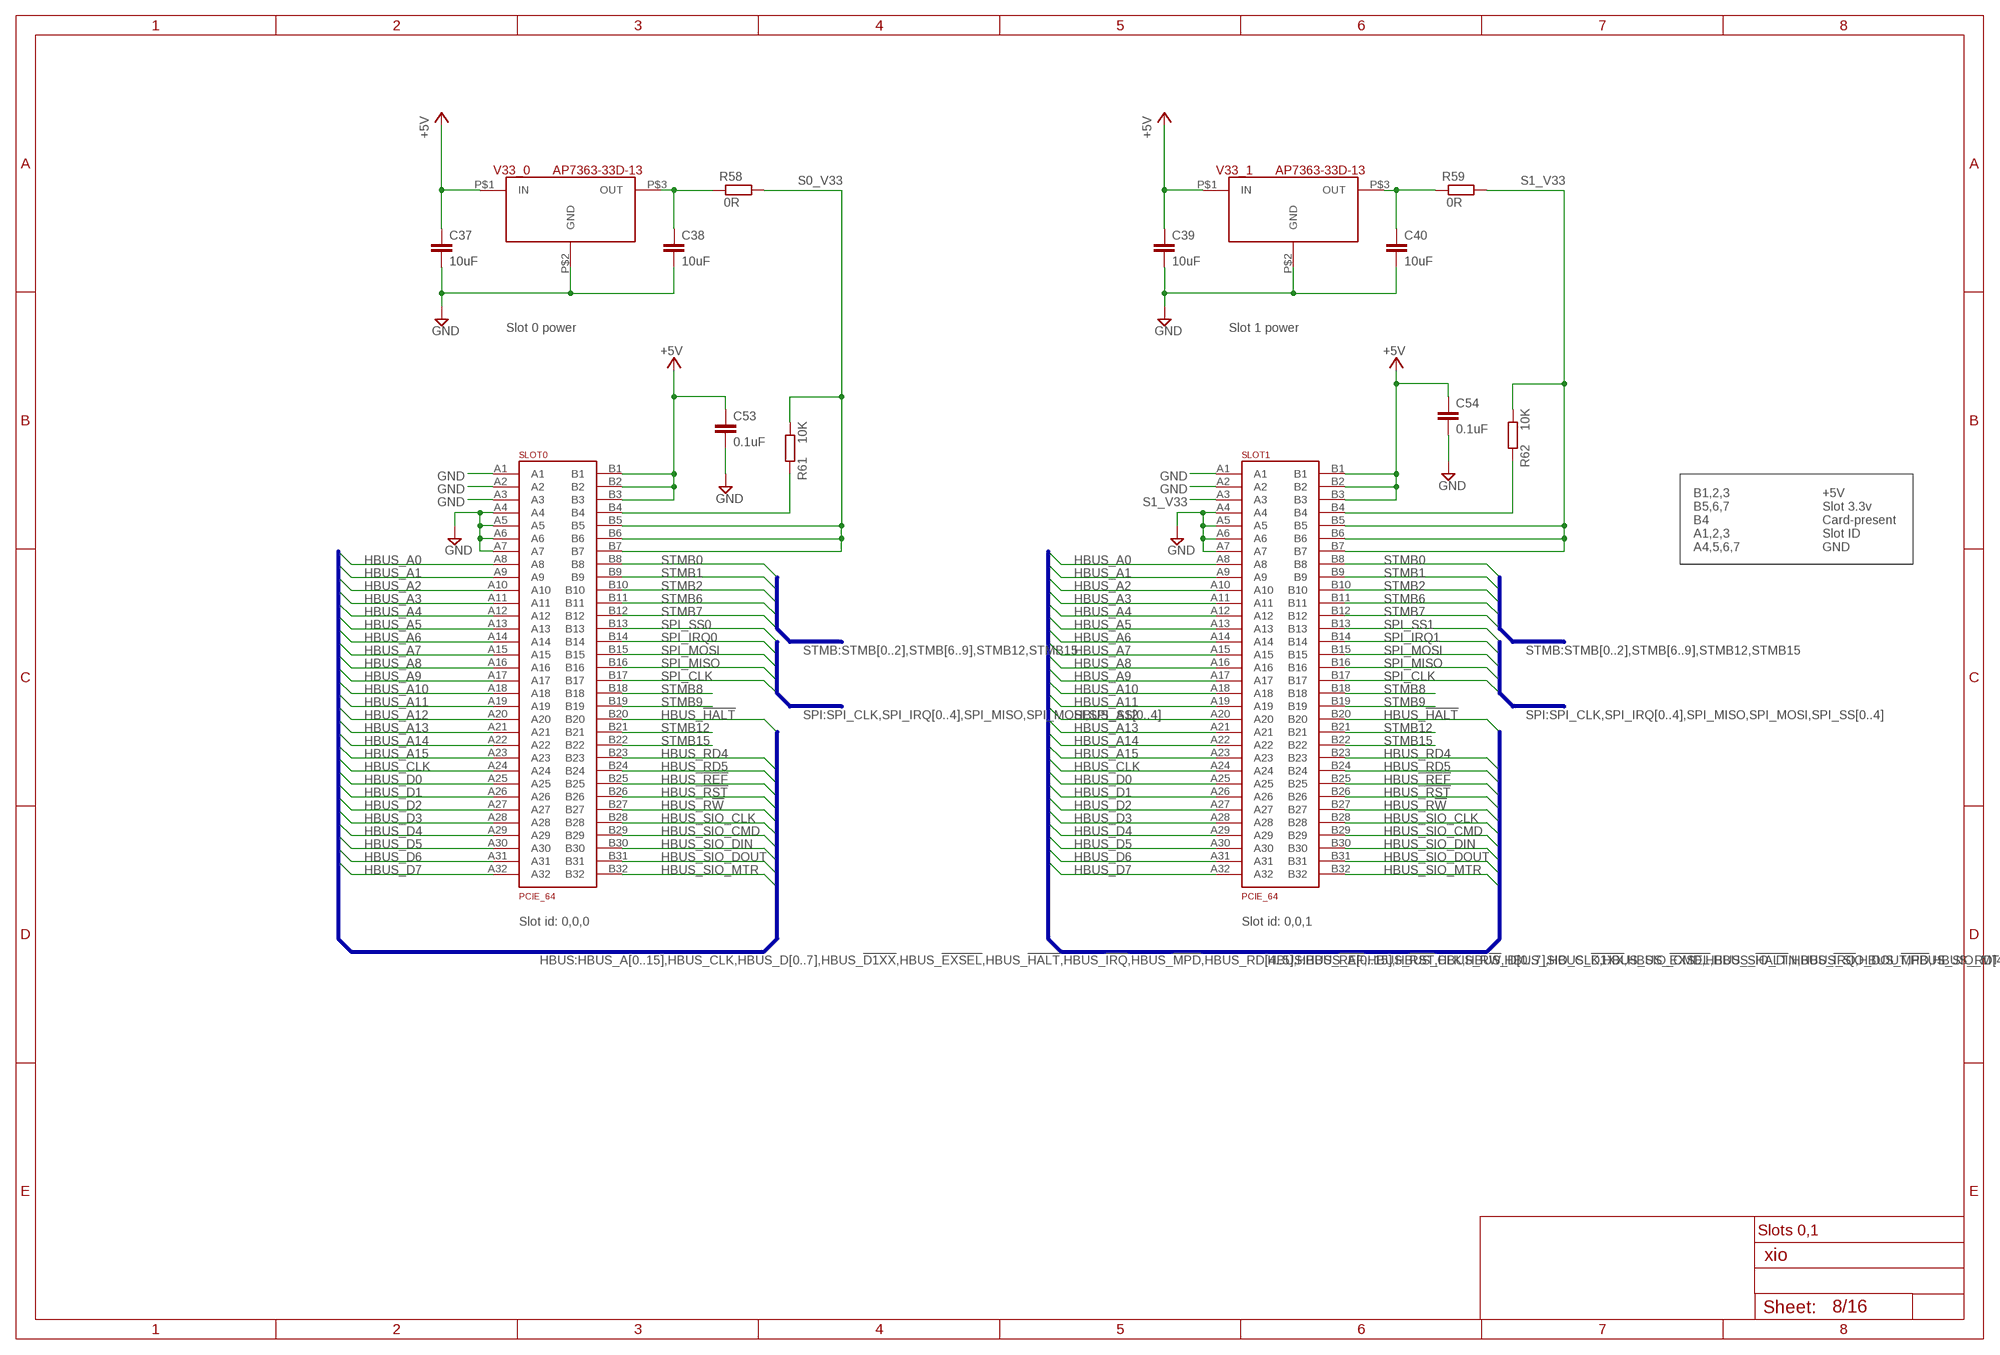
[diagram p8: schematic, sheet 8, part 1 of 2]
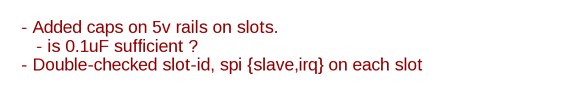
[diagram p9: schematic, sheet 8, part 2 of 2]

### Parts
C37  10uF  C-EUC0402K  [C0402K]
C38  10uF  C-EUC0402K  [C0402K]
C39  10uF  C-EUC0402K  [C0402K]
C40  10uF  C-EUC0402K  [C0402K]
C53  0.1uF  C-EUC0402K  [C0402K]
C54  0.1uF  C-EUC0402K  [C0402K]
R58  0R  R-EU_R0402  [R0402]
R59  0R  R-EU_R0402  [R0402]
R61  10K  R-EU_R0402  [R0402]
R62  10K  R-EU_R0402  [R0402]
SLOT0  PCIE_64  [PCI-E_64]
SLOT1  PCIE_64  [PCI-E_64]
V33_0  AP7363-33D-13  AP7363  [TO252-3L]
V33_1  AP7363-33D-13  AP7363  [TO252-3L]

### Nets
+5V: C37.1 C39.1 C53.1 C54.1 SLOT0.B1 SLOT0.B2 SLOT0.B3 SLOT1.B1 SLOT1.B2 SLOT1.B3 V33_0.P$1(IN) V33_1.P$1(IN) ; also sheet 2,7,9,10,11,16
GND: C37.2 C38.2 C39.2 C40.2 C53.2 C54.2 SLOT0.A1 SLOT0.A2 SLOT0.A3 SLOT0.A4 SLOT0.A5 SLOT0.A6 SLOT0.A7 SLOT1.A1 SLOT1.A2 SLOT1.A4 SLOT1.A5 SLOT1.A6 SLOT1.A7 V33_0.P$2(GND) V33_1.P$2(GND) ; also sheet 2,4,5,6,7,9,10,11,12,13,14,15,16
HBUS_!HALT!: SLOT0.B20 SLOT1.B20 ; also sheet 9,10
HBUS_!REF!: SLOT0.B25 SLOT1.B25 ; also sheet 9,10,15
HBUS_!RST!: SLOT0.B26 SLOT1.B26 ; also sheet 9,10,15
HBUS_A0: SLOT0.A8 SLOT1.A8 ; also sheet 9,10,16
HBUS_A1: SLOT0.A9 SLOT1.A9 ; also sheet 9,10,16
HBUS_A2: SLOT0.A10 SLOT1.A10 ; also sheet 9,10,16
HBUS_A3: SLOT0.A11 SLOT1.A11 ; also sheet 9,10,16
HBUS_A4: SLOT0.A12 SLOT1.A12 ; also sheet 9,10,16
HBUS_A5: SLOT0.A13 SLOT1.A13 ; also sheet 9,10,16
HBUS_A6: SLOT0.A14 SLOT1.A14 ; also sheet 9,10,16
HBUS_A7: SLOT0.A15 SLOT1.A15 ; also sheet 9,10,16
HBUS_A8: SLOT0.A16 SLOT1.A16 ; also sheet 9,10,16
HBUS_A9: SLOT0.A17 SLOT1.A17 ; also sheet 9,10,16
HBUS_A10: SLOT0.A18 SLOT1.A18 ; also sheet 9,10,16
HBUS_A11: SLOT0.A19 SLOT1.A19 ; also sheet 9,10,16
HBUS_A12: SLOT0.A20 SLOT1.A20 ; also sheet 9,10,16
HBUS_A13: SLOT0.A21 SLOT1.A21 ; also sheet 9,10,16
HBUS_A14: SLOT0.A22 SLOT1.A22 ; also sheet 9,10,16
HBUS_A15: SLOT0.A23 SLOT1.A23 ; also sheet 9,10,16
HBUS_CLK: SLOT0.A24 SLOT1.A24 ; also sheet 9,10,16
HBUS_D0: SLOT0.A25 SLOT1.A25 ; also sheet 9,10,16
HBUS_D1: SLOT0.A26 SLOT1.A26 ; also sheet 9,10,16
HBUS_D2: SLOT0.A27 SLOT1.A27 ; also sheet 9,10,16
HBUS_D3: SLOT0.A28 SLOT1.A28 ; also sheet 9,10,16
HBUS_D4: SLOT0.A29 SLOT1.A29 ; also sheet 9,10,16
HBUS_D5: SLOT0.A30 SLOT1.A30 ; also sheet 9,10,16
HBUS_D6: SLOT0.A31 SLOT1.A31 ; also sheet 9,10,16
HBUS_D7: SLOT0.A32 SLOT1.A32 ; also sheet 9,10,16
HBUS_R!W!: SLOT0.B27 SLOT1.B27 ; also sheet 9,10,15,16
HBUS_RD4: SLOT0.B23 SLOT1.B23 ; also sheet 9,10,15,16
HBUS_RD5: SLOT0.B24 SLOT1.B24 ; also sheet 9,10,15,16
HBUS_SIO_CLK: SLOT0.B28 SLOT1.B28 ; also sheet 9,10,15
HBUS_SIO_CMD: SLOT0.B29 SLOT1.B29 ; also sheet 9,10,15
HBUS_SIO_DIN: SLOT0.B30 SLOT1.B30 ; also sheet 9,10,15
HBUS_SIO_DOUT: SLOT0.B31 SLOT1.B31 ; also sheet 9,10,15
HBUS_SIO_MTR: SLOT0.B32 SLOT1.B32 ; also sheet 9,10,15
N$3: R62.2 SLOT1.B4
N$5 [Slot-power]: R61.2 SLOT0.B4
N$10 [Slot-power]: C38.1 R58.2 V33_0.P$3(OUT)
N$25 [Slot-power]: C40.1 R59.2 V33_1.P$3(OUT)
S0_V33 [Slot-power]: R58.1 R61.1 SLOT0.B5 SLOT0.B6 SLOT0.B7
S1_V33 [Slot-power]: R59.1 R62.1 SLOT1.A3 SLOT1.B5 SLOT1.B6 SLOT1.B7
SPI_CLK: SLOT0.B17 SLOT1.B17 ; also sheet 3,9,10,15
SPI_IRQ0: SLOT0.B14 ; also sheet 3
SPI_IRQ1: SLOT1.B14 ; also sheet 3
SPI_MISO: SLOT0.B16 SLOT1.B16 ; also sheet 3,9,10,15
SPI_MOSI: SLOT0.B15 SLOT1.B15 ; also sheet 3,9,10,15
SPI_SS0: SLOT0.B13 ; also sheet 3
SPI_SS1: SLOT1.B13 ; also sheet 3
STMB0: SLOT0.B8 SLOT1.B8 ; also sheet 4,9,10
STMB1: SLOT0.B9 SLOT1.B9 ; also sheet 4,9,10
STMB2: SLOT0.B10 SLOT1.B10 ; also sheet 4,9,10
STMB6: SLOT0.B11 SLOT1.B11 ; also sheet 4,9,10
STMB7: SLOT0.B12 SLOT1.B12 ; also sheet 4,9,10
STMB8: SLOT0.B18 SLOT1.B18 ; also sheet 4,9,10
STMB9: SLOT0.B19 SLOT1.B19 ; also sheet 4,9,10
STMB12: SLOT0.B21 SLOT1.B21 ; also sheet 4,9,10
STMB15: SLOT0.B22 SLOT1.B22 ; also sheet 4,9,10

### Buses
HBUS:HBUS_A[0..15],HBUS_CLK,HBUS_D[0..7],HBUS_!D1XX!,HBUS_!EXSEL!,HBUS_!HALT!,HBUS_!IRQ!,HBUS_!MPD!,HBUS_RD[4..5],HBUS_!REF!,HBUS_!RST!,HBUS_R!W!,HBUS_SIO_CLK,HBUS_SIO_CMD,HBUS_SIO_DIN,HBUS_SIO_DOUT,HBUS_SIO_MTR
SPI:SPI_CLK,SPI_IRQ[0..4],SPI_MISO,SPI_MOSI,SPI_SS[0..4]
STMB:STMB[0..2],STMB[6..9],STMB12,STMB15

### Notes on the sheet
- - Added caps on 5v rails on slots. 
     - is 0.1uF sufficient ?
  - Double-checked slot-id, spi {slave,irq} on each slot
- Slot 0 power | Slot 1 power
- B1,2,3
  B5,6,7
  B4
  A1,2,3
  A4,5,6,7
- +5V
  Slot 3.3v
  Card-present
  Slot ID
  GND
- Slot id: 0,0,0 | Slot id: 0,0,1
- Slots 0,1

## Sheet 9 of 16: Expansion slots 2 & 3
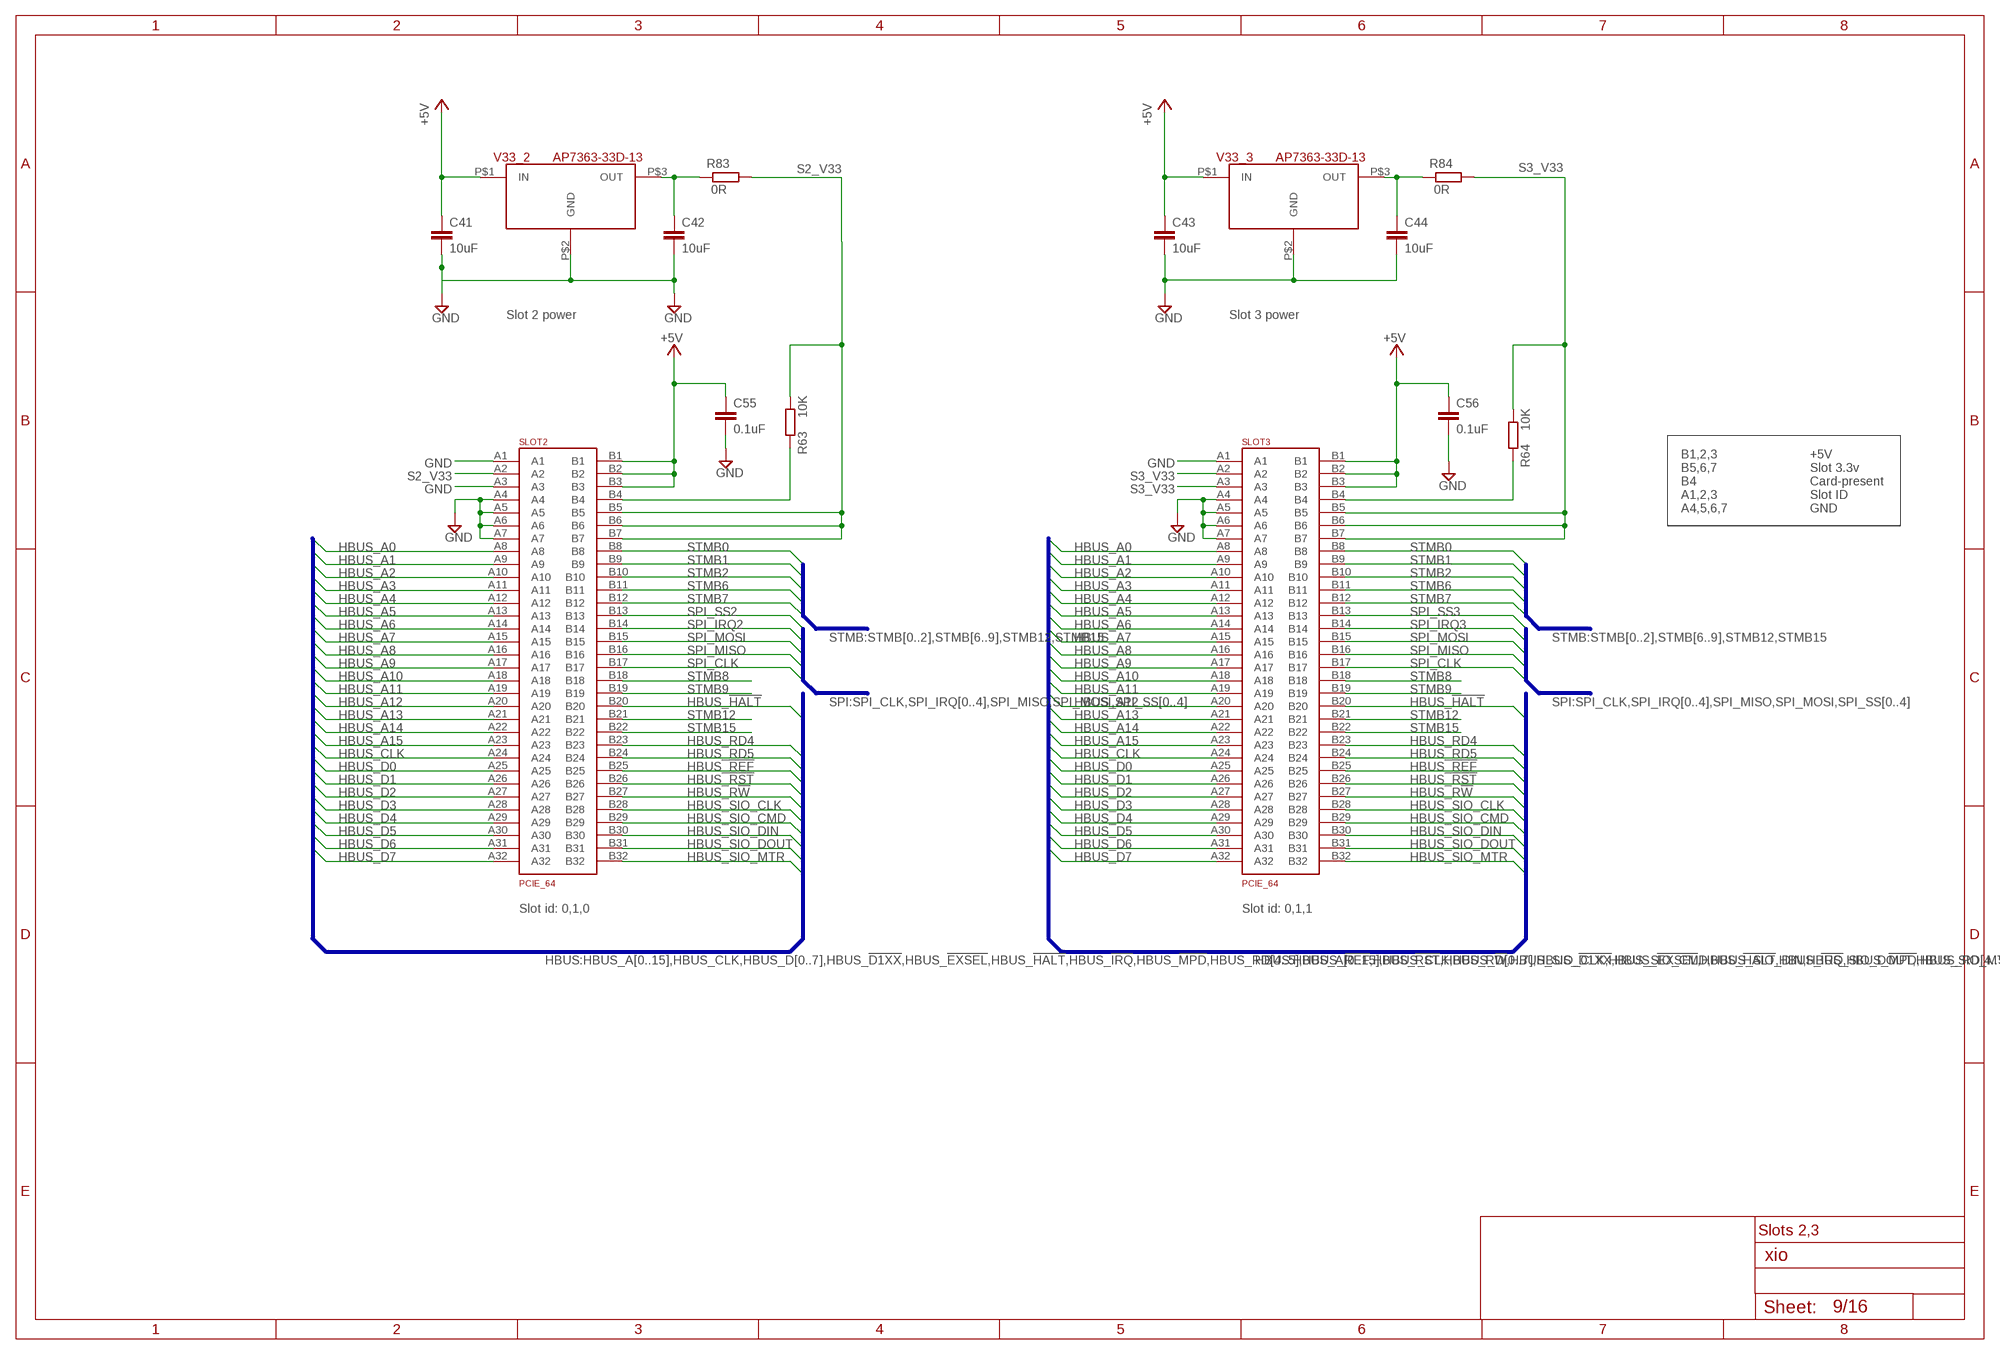
[diagram p10: schematic, sheet 9]

### Parts
C41  10uF  C-EUC0402K  [C0402K]
C42  10uF  C-EUC0402K  [C0402K]
C43  10uF  C-EUC0402K  [C0402K]
C44  10uF  C-EUC0402K  [C0402K]
C55  0.1uF  C-EUC0402K  [C0402K]
C56  0.1uF  C-EUC0402K  [C0402K]
R63  10K  R-EU_R0402  [R0402]
R64  10K  R-EU_R0402  [R0402]
R83  0R  R-EU_R0402  [R0402]
R84  0R  R-EU_R0402  [R0402]
SLOT2  PCIE_64  [PCI-E_64]
SLOT3  PCIE_64  [PCI-E_64]
V33_2  AP7363-33D-13  AP7363  [TO252-3L]
V33_3  AP7363-33D-13  AP7363  [TO252-3L]

### Nets
+5V: C41.1 C43.1 C55.1 C56.1 SLOT2.B1 SLOT2.B2 SLOT2.B3 SLOT3.B1 SLOT3.B2 SLOT3.B3 V33_2.P$1(IN) V33_3.P$1(IN) ; also sheet 2,7,8,10,11,16
GND: C41.2 C42.2 C43.2 C44.2 C55.2 C56.2 SLOT2.A1 SLOT2.A3 SLOT2.A4 SLOT2.A5 SLOT2.A6 SLOT2.A7 SLOT3.A1 SLOT3.A4 SLOT3.A5 SLOT3.A6 SLOT3.A7 V33_2.P$2(GND) V33_3.P$2(GND) ; also sheet 2,4,5,6,7,8,10,11,12,13,14,15,16
HBUS_!HALT!: SLOT2.B20 SLOT3.B20 ; also sheet 8,10
HBUS_!REF!: SLOT2.B25 SLOT3.B25 ; also sheet 8,10,15
HBUS_!RST!: SLOT2.B26 SLOT3.B26 ; also sheet 8,10,15
HBUS_A0: SLOT2.A8 SLOT3.A8 ; also sheet 8,10,16
HBUS_A1: SLOT2.A9 SLOT3.A9 ; also sheet 8,10,16
HBUS_A2: SLOT2.A10 SLOT3.A10 ; also sheet 8,10,16
HBUS_A3: SLOT2.A11 SLOT3.A11 ; also sheet 8,10,16
HBUS_A4: SLOT2.A12 SLOT3.A12 ; also sheet 8,10,16
HBUS_A5: SLOT2.A13 SLOT3.A13 ; also sheet 8,10,16
HBUS_A6: SLOT2.A14 SLOT3.A14 ; also sheet 8,10,16
HBUS_A7: SLOT2.A15 SLOT3.A15 ; also sheet 8,10,16
HBUS_A8: SLOT2.A16 SLOT3.A16 ; also sheet 8,10,16
HBUS_A9: SLOT2.A17 SLOT3.A17 ; also sheet 8,10,16
HBUS_A10: SLOT2.A18 SLOT3.A18 ; also sheet 8,10,16
HBUS_A11: SLOT2.A19 SLOT3.A19 ; also sheet 8,10,16
HBUS_A12: SLOT2.A20 SLOT3.A20 ; also sheet 8,10,16
HBUS_A13: SLOT2.A21 SLOT3.A21 ; also sheet 8,10,16
HBUS_A14: SLOT2.A22 SLOT3.A22 ; also sheet 8,10,16
HBUS_A15: SLOT2.A23 SLOT3.A23 ; also sheet 8,10,16
HBUS_CLK: SLOT2.A24 SLOT3.A24 ; also sheet 8,10,16
HBUS_D0: SLOT2.A25 SLOT3.A25 ; also sheet 8,10,16
HBUS_D1: SLOT2.A26 SLOT3.A26 ; also sheet 8,10,16
HBUS_D2: SLOT2.A27 SLOT3.A27 ; also sheet 8,10,16
HBUS_D3: SLOT2.A28 SLOT3.A28 ; also sheet 8,10,16
HBUS_D4: SLOT2.A29 SLOT3.A29 ; also sheet 8,10,16
HBUS_D5: SLOT2.A30 SLOT3.A30 ; also sheet 8,10,16
HBUS_D6: SLOT2.A31 SLOT3.A31 ; also sheet 8,10,16
HBUS_D7: SLOT2.A32 SLOT3.A32 ; also sheet 8,10,16
HBUS_R!W!: SLOT2.B27 SLOT3.B27 ; also sheet 8,10,15,16
HBUS_RD4: SLOT2.B23 SLOT3.B23 ; also sheet 8,10,15,16
HBUS_RD5: SLOT2.B24 SLOT3.B24 ; also sheet 8,10,15,16
HBUS_SIO_CLK: SLOT2.B28 SLOT3.B28 ; also sheet 8,10,15
HBUS_SIO_CMD: SLOT2.B29 SLOT3.B29 ; also sheet 8,10,15
HBUS_SIO_DIN: SLOT2.B30 SLOT3.B30 ; also sheet 8,10,15
HBUS_SIO_DOUT: SLOT2.B31 SLOT3.B31 ; also sheet 8,10,15
HBUS_SIO_MTR: SLOT2.B32 SLOT3.B32 ; also sheet 8,10,15
N$37 [Slot-power]: C42.1 R83.2 V33_2.P$3(OUT)
N$53 [Slot-power]: C44.1 R84.2 V33_3.P$3(OUT)
N$82 [Slot-power]: R63.2 SLOT2.B4
N$83: R64.2 SLOT3.B4
S2_V33 [Slot-power]: R63.1 R83.1 SLOT2.A2 SLOT2.B5 SLOT2.B6 SLOT2.B7
S3_V33 [Slot-power]: R64.1 R84.1 SLOT3.A2 SLOT3.A3 SLOT3.B5 SLOT3.B6 SLOT3.B7
SPI_CLK: SLOT2.B17 SLOT3.B17 ; also sheet 3,8,10,15
SPI_IRQ2: SLOT2.B14 ; also sheet 3
SPI_IRQ3: SLOT3.B14 ; also sheet 3
SPI_MISO: SLOT2.B16 SLOT3.B16 ; also sheet 3,8,10,15
SPI_MOSI: SLOT2.B15 SLOT3.B15 ; also sheet 3,8,10,15
SPI_SS2: SLOT2.B13 ; also sheet 3
SPI_SS3: SLOT3.B13 ; also sheet 3
STMB0: SLOT2.B8 SLOT3.B8 ; also sheet 4,8,10
STMB1: SLOT2.B9 SLOT3.B9 ; also sheet 4,8,10
STMB2: SLOT2.B10 SLOT3.B10 ; also sheet 4,8,10
STMB6: SLOT2.B11 SLOT3.B11 ; also sheet 4,8,10
STMB7: SLOT2.B12 SLOT3.B12 ; also sheet 4,8,10
STMB8: SLOT2.B18 SLOT3.B18 ; also sheet 4,8,10
STMB9: SLOT2.B19 SLOT3.B19 ; also sheet 4,8,10
STMB12: SLOT2.B21 SLOT3.B21 ; also sheet 4,8,10
STMB15: SLOT2.B22 SLOT3.B22 ; also sheet 4,8,10

### Buses
SPI:SPI_CLK,SPI_IRQ[0..4],SPI_MISO,SPI_MOSI,SPI_SS[0..4]
HBUS:HBUS_A[0..15],HBUS_CLK,HBUS_D[0..7],HBUS_!D1XX!,HBUS_!EXSEL!,HBUS_!HALT!,HBUS_!IRQ!,HBUS_!MPD!,HBUS_RD[4..5],HBUS_!REF!,HBUS_!RST!,HBUS_R!W!,HBUS_SIO_CLK,HBUS_SIO_CMD,HBUS_SIO_DIN,HBUS_SIO_DOUT,HBUS_SIO_MTR
STMB:STMB[0..2],STMB[6..9],STMB12,STMB15

### Notes on the sheet
- Slot 2 power | Slot 3 power
- B1,2,3
  B5,6,7
  B4
  A1,2,3
  A4,5,6,7
- +5V
  Slot 3.3v
  Card-present
  Slot ID
  GND
- Slot id: 0,1,0 | Slot id: 0,1,1
- Slots 2,3

## Sheet 10 of 16: Expansion slots 4 & 5
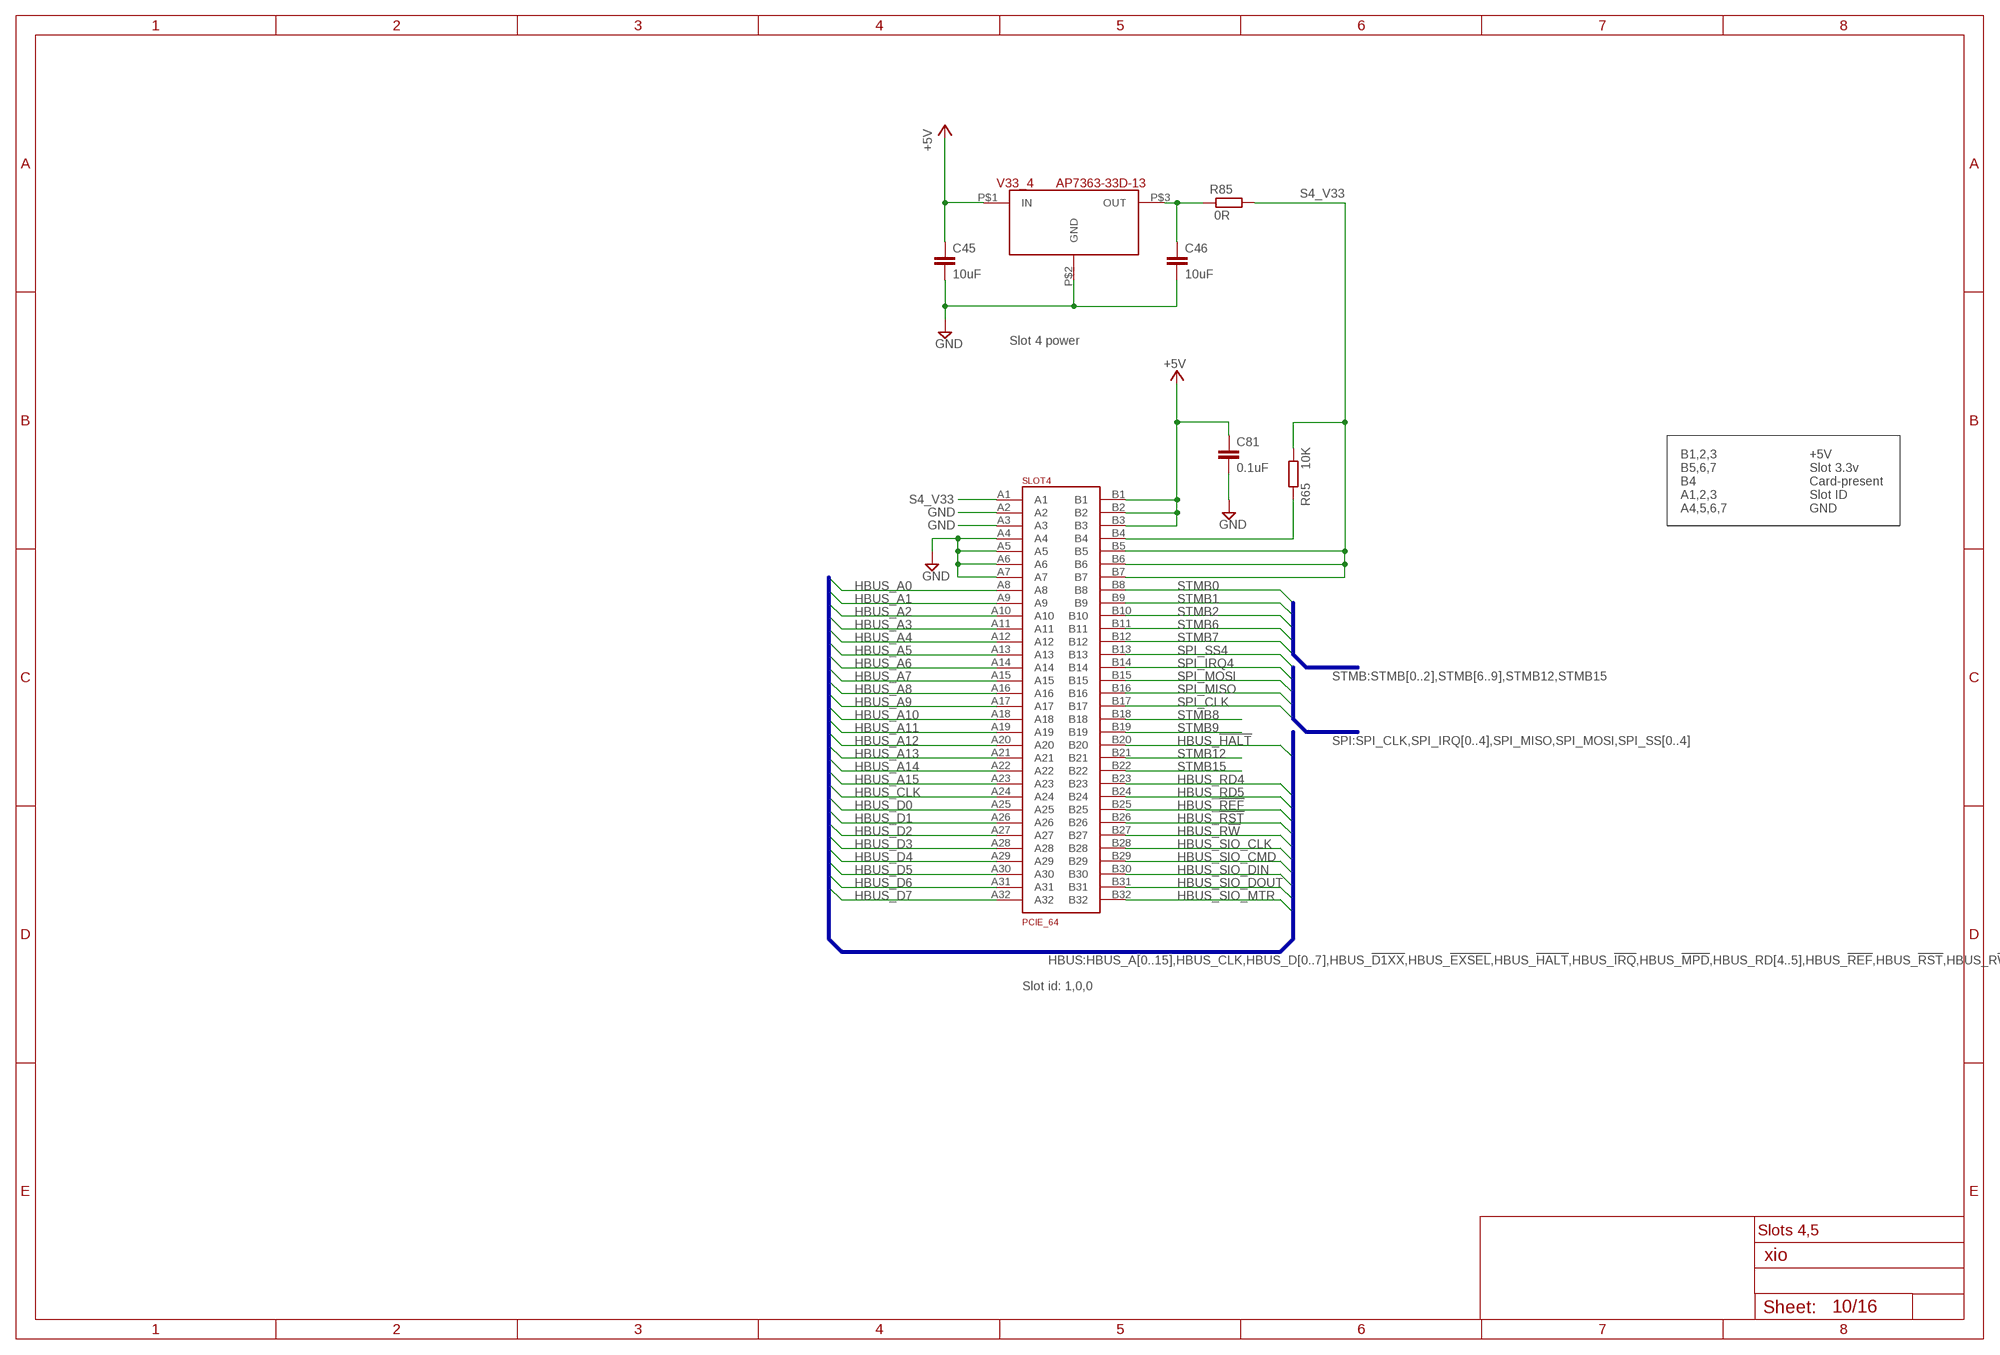
[diagram p11: schematic, sheet 10]

### Parts
C45  10uF  C-EUC0402K  [C0402K]
C46  10uF  C-EUC0402K  [C0402K]
C81  0.1uF  C-EUC0402K  [C0402K]
R65  10K  R-EU_R0402  [R0402]
R85  0R  R-EU_R0402  [R0402]
SLOT4  PCIE_64  [PCI-E_64]
V33_4  AP7363-33D-13  AP7363  [TO252-3L]

### Nets
+5V: C45.1 C81.1 SLOT4.B1 SLOT4.B2 SLOT4.B3 V33_4.P$1(IN) ; also sheet 2,7,8,9,11,16
GND: C45.2 C46.2 C81.2 SLOT4.A2 SLOT4.A3 SLOT4.A4 SLOT4.A5 SLOT4.A6 SLOT4.A7 V33_4.P$2(GND) ; also sheet 2,4,5,6,7,8,9,11,12,13,14,15,16
HBUS_!HALT!: SLOT4.B20 ; also sheet 8,9
HBUS_!REF!: SLOT4.B25 ; also sheet 8,9,15
HBUS_!RST!: SLOT4.B26 ; also sheet 8,9,15
HBUS_A0: SLOT4.A8 ; also sheet 8,9,16
HBUS_A1: SLOT4.A9 ; also sheet 8,9,16
HBUS_A2: SLOT4.A10 ; also sheet 8,9,16
HBUS_A3: SLOT4.A11 ; also sheet 8,9,16
HBUS_A4: SLOT4.A12 ; also sheet 8,9,16
HBUS_A5: SLOT4.A13 ; also sheet 8,9,16
HBUS_A6: SLOT4.A14 ; also sheet 8,9,16
HBUS_A7: SLOT4.A15 ; also sheet 8,9,16
HBUS_A8: SLOT4.A16 ; also sheet 8,9,16
HBUS_A9: SLOT4.A17 ; also sheet 8,9,16
HBUS_A10: SLOT4.A18 ; also sheet 8,9,16
HBUS_A11: SLOT4.A19 ; also sheet 8,9,16
HBUS_A12: SLOT4.A20 ; also sheet 8,9,16
HBUS_A13: SLOT4.A21 ; also sheet 8,9,16
HBUS_A14: SLOT4.A22 ; also sheet 8,9,16
HBUS_A15: SLOT4.A23 ; also sheet 8,9,16
HBUS_CLK: SLOT4.A24 ; also sheet 8,9,16
HBUS_D0: SLOT4.A25 ; also sheet 8,9,16
HBUS_D1: SLOT4.A26 ; also sheet 8,9,16
HBUS_D2: SLOT4.A27 ; also sheet 8,9,16
HBUS_D3: SLOT4.A28 ; also sheet 8,9,16
HBUS_D4: SLOT4.A29 ; also sheet 8,9,16
HBUS_D5: SLOT4.A30 ; also sheet 8,9,16
HBUS_D6: SLOT4.A31 ; also sheet 8,9,16
HBUS_D7: SLOT4.A32 ; also sheet 8,9,16
HBUS_R!W!: SLOT4.B27 ; also sheet 8,9,15,16
HBUS_RD4: SLOT4.B23 ; also sheet 8,9,15,16
HBUS_RD5: SLOT4.B24 ; also sheet 8,9,15,16
HBUS_SIO_CLK: SLOT4.B28 ; also sheet 8,9,15
HBUS_SIO_CMD: SLOT4.B29 ; also sheet 8,9,15
HBUS_SIO_DIN: SLOT4.B30 ; also sheet 8,9,15
HBUS_SIO_DOUT: SLOT4.B31 ; also sheet 8,9,15
HBUS_SIO_MTR: SLOT4.B32 ; also sheet 8,9,15
N$54 [Slot-power]: C46.1 R85.2 V33_4.P$3(OUT)
N$84: R65.2 SLOT4.B4
S4_V33 [Slot-power]: R65.1 R85.1 SLOT4.A1 SLOT4.B5 SLOT4.B6 SLOT4.B7
SPI_CLK: SLOT4.B17 ; also sheet 3,8,9,15
SPI_IRQ4: SLOT4.B14 ; also sheet 3
SPI_MISO: SLOT4.B16 ; also sheet 3,8,9,15
SPI_MOSI: SLOT4.B15 ; also sheet 3,8,9,15
SPI_SS4: SLOT4.B13 ; also sheet 3
STMB0: SLOT4.B8 ; also sheet 4,8,9
STMB1: SLOT4.B9 ; also sheet 4,8,9
STMB2: SLOT4.B10 ; also sheet 4,8,9
STMB6: SLOT4.B11 ; also sheet 4,8,9
STMB7: SLOT4.B12 ; also sheet 4,8,9
STMB8: SLOT4.B18 ; also sheet 4,8,9
STMB9: SLOT4.B19 ; also sheet 4,8,9
STMB12: SLOT4.B21 ; also sheet 4,8,9
STMB15: SLOT4.B22 ; also sheet 4,8,9

### Buses
HBUS:HBUS_A[0..15],HBUS_CLK,HBUS_D[0..7],HBUS_!D1XX!,HBUS_!EXSEL!,HBUS_!HALT!,HBUS_!IRQ!,HBUS_!MPD!,HBUS_RD[4..5],HBUS_!REF!,HBUS_!RST!,HBUS_R!W!,HBUS_SIO_CLK,HBUS_SIO_CMD,HBUS_SIO_DIN,HBUS_SIO_DOUT,HBUS_SIO_MTR
SPI:SPI_CLK,SPI_IRQ[0..4],SPI_MISO,SPI_MOSI,SPI_SS[0..4]
STMB:STMB[0..2],STMB[6..9],STMB12,STMB15

### Notes on the sheet
- Slot 4 power
- B1,2,3
  B5,6,7
  B4
  A1,2,3
  A4,5,6,7
- +5V
  Slot 3.3v
  Card-present
  Slot ID
  GND
- Slot id: 1,0,0
- Slots 4,5

## Sheet 11 of 16: LTDC VGA
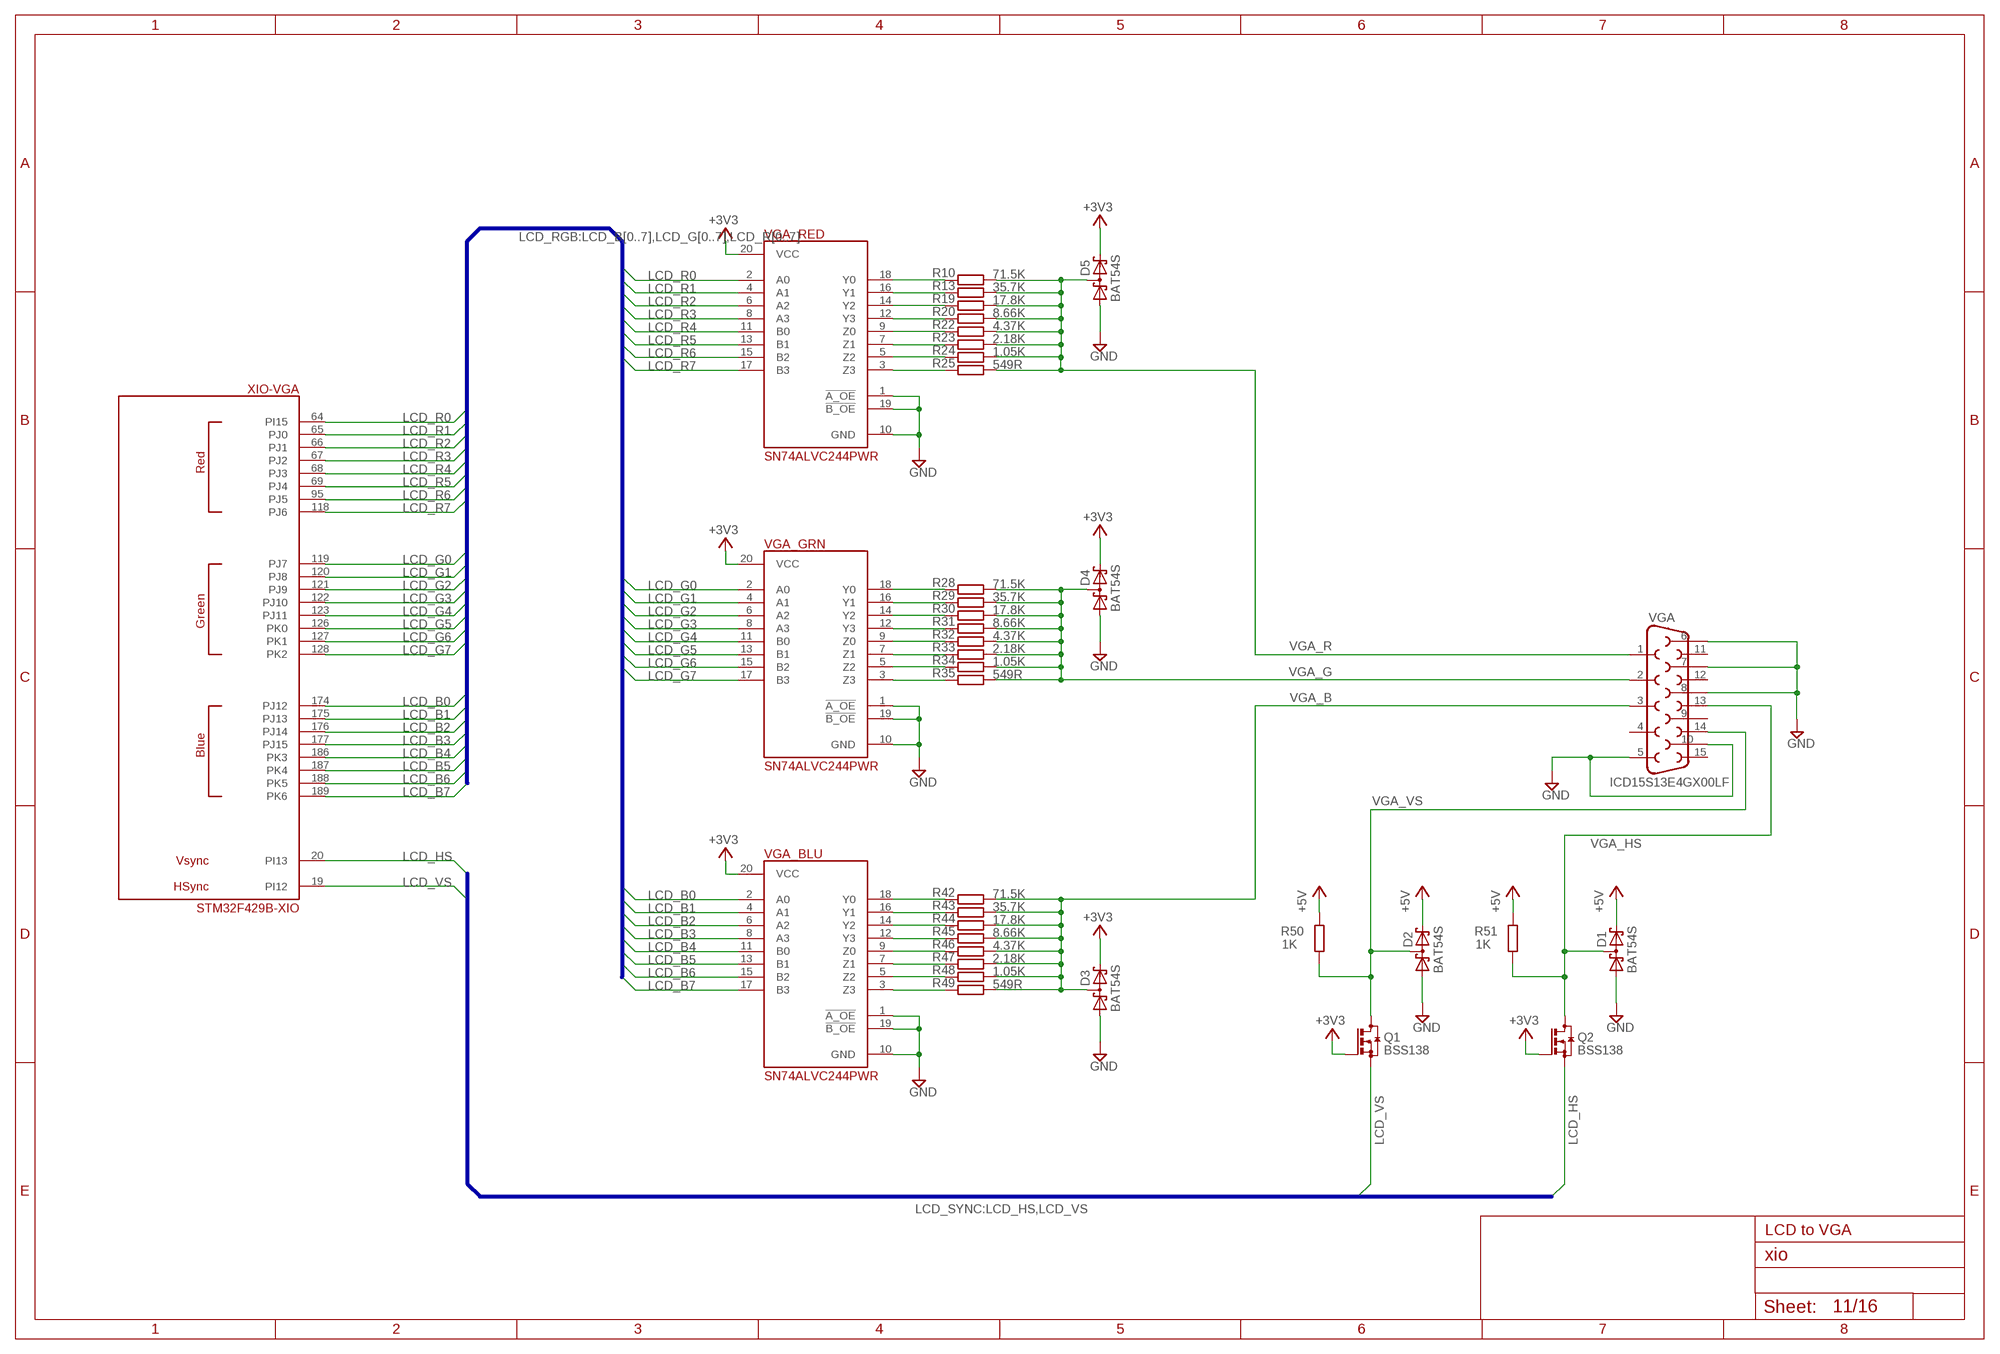
[diagram p12: schematic, sheet 11]

### Parts
D1  BAT54S  [SOT23]
D2  BAT54S  [SOT23]
D3  BAT54S  [SOT23]
D4  BAT54S  [SOT23]
D5  BAT54S  [SOT23]
Q1  BSS138  BSS123  [SOT23]
Q2  BSS138  BSS123  [SOT23]
R10  71.5K  R-EU_R0402  [R0402]
R13  35.7K  R-EU_R0402  [R0402]
R19  17.8K  R-EU_R0402  [R0402]
R20  8.66K  R-EU_R0402  [R0402]
R22  4.37K  R-EU_R0402  [R0402]
R23  2.18K  R-EU_R0402  [R0402]
R24  1.05K  R-EU_R0402  [R0402]
R25  549R  R-EU_R0402  [R0402]
R28  71.5K  R-EU_R0402  [R0402]
R29  35.7K  R-EU_R0402  [R0402]
R30  17.8K  R-EU_R0402  [R0402]
R31  8.66K  R-EU_R0402  [R0402]
R32  4.37K  R-EU_R0402  [R0402]
R33  2.18K  R-EU_R0402  [R0402]
R34  1.05K  R-EU_R0402  [R0402]
R35  549R  R-EU_R0402  [R0402]
R42  71.5K  R-EU_R0402  [R0402]
R43  35.7K  R-EU_R0402  [R0402]
R44  17.8K  R-EU_R0402  [R0402]
R45  8.66K  R-EU_R0402  [R0402]
R46  4.37K  R-EU_R0402  [R0402]
R47  2.18K  R-EU_R0402  [R0402]
R48  1.05K  R-EU_R0402  [R0402]
R49  549R  R-EU_R0402  [R0402]
R50  1K  R-EU_R0402  [R0402]
R51  1K  R-EU_R0402  [R0402]
VGA  ICD15S13E4GX00LF  DB15  [DB15]
VGA_BLU  SN74ALVC244PWR  SN74ALVC244  [TSSOP20]
VGA_GRN  SN74ALVC244PWR  SN74ALVC244  [TSSOP20]
VGA_RED  SN74ALVC244PWR  SN74ALVC244  [TSSOP20]

### Nets
+3V3 [3v3]: D3.2(C2) D4.2(C2) D5.2(C2) Q1.1(G) Q2.1(G) VGA_BLU.20(VCC) VGA_GRN.20(VCC) VGA_RED.20(VCC) ; also sheet 2,4,5,6,12,13,14,15,16
+5V: D1.2(C2) D2.2(C2) R50.1 R51.1 ; also sheet 2,7,8,9,10,16
GND: D1.1(A1) D2.1(A1) D3.1(A1) D4.1(A1) D5.1(A1) VGA.5 VGA.6 VGA.7 VGA.8 VGA.10 VGA_BLU.1(!A_OE!) VGA_BLU.10(GND) VGA_BLU.19(!B_OE!) VGA_GRN.1(!A_OE!) VGA_GRN.10(GND) VGA_GRN.19(!B_OE!) VGA_RED.1(!A_OE!) VGA_RED.10(GND) VGA_RED.19(!B_OE!) ; also sheet 2,4,5,6,7,8,9,10,12,13,14,15,16
LCD_B0: VGA_BLU.2(A0) XIO.174(-VGA:PJ12)
LCD_B1: VGA_BLU.4(A1) XIO.175(-VGA:PJ13)
LCD_B2: VGA_BLU.6(A2) XIO.176(-VGA:PJ14)
LCD_B3: VGA_BLU.8(A3) XIO.177(-VGA:PJ15)
LCD_B4: VGA_BLU.11(B0) XIO.186(-VGA:PK3)
LCD_B5: VGA_BLU.13(B1) XIO.187(-VGA:PK4)
LCD_B6: VGA_BLU.15(B2) XIO.188(-VGA:PK5)
LCD_B7: VGA_BLU.17(B3) XIO.189(-VGA:PK6)
LCD_G0: VGA_GRN.2(A0) XIO.119(-VGA:PJ7)
LCD_G1: VGA_GRN.4(A1) XIO.120(-VGA:PJ8)
LCD_G2: VGA_GRN.6(A2) XIO.121(-VGA:PJ9)
LCD_G3: VGA_GRN.8(A3) XIO.122(-VGA:PJ10)
LCD_G4: VGA_GRN.11(B0) XIO.123(-VGA:PJ11)
LCD_G5: VGA_GRN.13(B1) XIO.126(-VGA:PK0)
LCD_G6: VGA_GRN.15(B2) XIO.127(-VGA:PK1)
LCD_G7: VGA_GRN.17(B3) XIO.128(-VGA:PK2)
LCD_HS: Q2.2(S) XIO.20(-VGA:PI13)
LCD_R0: VGA_RED.2(A0) XIO.64(-VGA:PI15)
LCD_R1: VGA_RED.4(A1) XIO.65(-VGA:PJ0)
LCD_R2: VGA_RED.6(A2) XIO.66(-VGA:PJ1)
LCD_R3: VGA_RED.8(A3) XIO.67(-VGA:PJ2)
LCD_R4: VGA_RED.11(B0) XIO.68(-VGA:PJ3)
LCD_R5: VGA_RED.13(B1) XIO.69(-VGA:PJ4)
LCD_R6: VGA_RED.15(B2) XIO.95(-VGA:PJ5)
LCD_R7: VGA_RED.17(B3) XIO.118(-VGA:PJ6)
LCD_VS: Q1.2(S) XIO.19(-VGA:PI12)
N$6: R10.2 VGA_RED.18(Y0)
N$8: R13.2 VGA_RED.16(Y1)
N$17: R19.2 VGA_RED.14(Y2)
N$18: R20.2 VGA_RED.12(Y3)
N$20: R22.2 VGA_RED.9(Z0)
N$21: R23.2 VGA_RED.7(Z1)
N$22: R24.2 VGA_RED.5(Z2)
N$23: R25.2 VGA_RED.3(Z3)
N$24: R35.2 VGA_GRN.3(Z3)
N$26: R34.2 VGA_GRN.5(Z2)
N$27: R33.2 VGA_GRN.7(Z1)
N$34: R32.2 VGA_GRN.9(Z0)
N$35: R31.2 VGA_GRN.12(Y3)
N$36: R30.2 VGA_GRN.14(Y2)
N$38: R29.2 VGA_GRN.16(Y1)
N$39: R28.2 VGA_GRN.18(Y0)
N$40: R49.2 VGA_BLU.3(Z3)
N$41: R48.2 VGA_BLU.5(Z2)
N$42: R47.2 VGA_BLU.7(Z1)
N$43: R46.2 VGA_BLU.9(Z0)
N$44: R45.2 VGA_BLU.12(Y3)
N$45: R44.2 VGA_BLU.14(Y2)
N$46: R43.2 VGA_BLU.16(Y1)
N$47: R42.2 VGA_BLU.18(Y0)
VGA_B: D3.3(C1A2) R42.1 R43.1 R44.1 R45.1 R46.1 R47.1 R48.1 R49.1 VGA.3
VGA_G: D4.3(C1A2) R28.1 R29.1 R30.1 R31.1 R32.1 R33.1 R34.1 R35.1 VGA.2
VGA_HS: D1.3(C1A2) Q2.3(D) R51.2 VGA.13
VGA_R: D5.3(C1A2) R10.1 R13.1 R19.1 R20.1 R22.1 R23.1 R24.1 R25.1 VGA.1
VGA_VS: D2.3(C1A2) Q1.3(D) R50.2 VGA.14
Unconnected: VGA.4 VGA.9 VGA.11 VGA.12 VGA.15

### Buses
LCD_RGB:LCD_B[0..7],LCD_G[0..7],LCD_R[0..7]
LCD_SYNC:LCD_HS,LCD_VS

### Notes on the sheet
- LCD to VGA

## Sheet 12 of 16: Board config
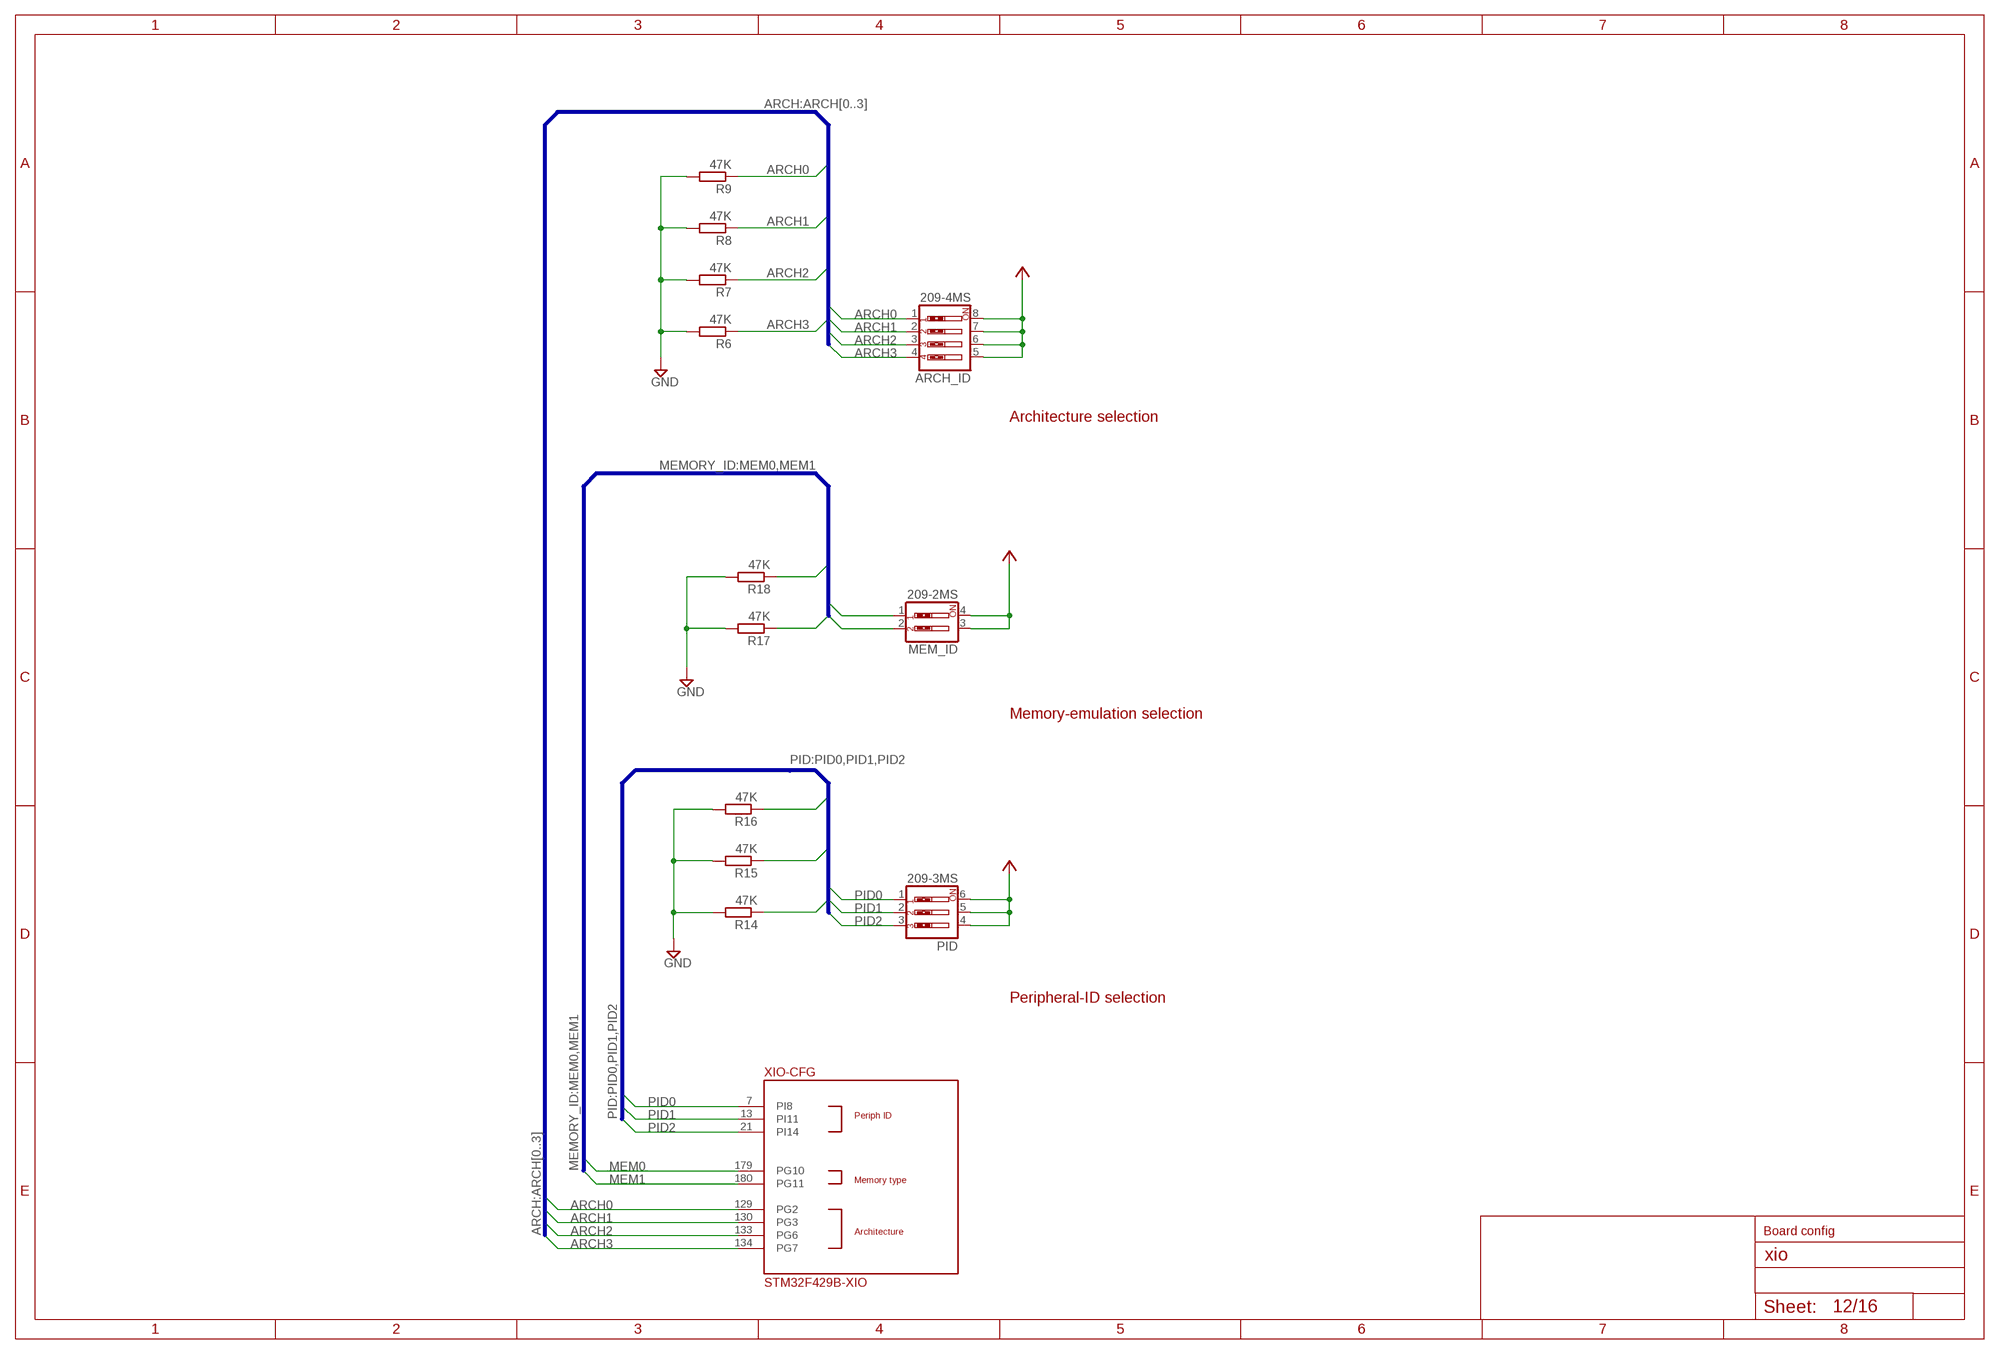
[diagram p13: schematic, sheet 12]

### Parts
ARCH_ID  209-4MS  SW_DIP-4  [EDG-04]
MEM_ID  209-2MS  SW_DIP-2  [EDG-02]
PID  209-3MS  SW_DIP-3  [EDG-03]
R6  47K  R-EU_R0402  [R0402]
R7  47K  R-EU_R0402  [R0402]
R8  47K  R-EU_R0402  [R0402]
R9  47K  R-EU_R0402  [R0402]
R14  47K  R-EU_R0402  [R0402]
R15  47K  R-EU_R0402  [R0402]
R16  47K  R-EU_R0402  [R0402]
R17  47K  R-EU_R0402  [R0402]
R18  47K  R-EU_R0402  [R0402]

### Nets
+3V3 [3v3]: ARCH_ID.5 ARCH_ID.6 ARCH_ID.7 ARCH_ID.8 MEM_ID.3 MEM_ID.4 PID.4 PID.5 PID.6 ; also sheet 2,4,5,6,11,13,14,15,16
ARCH0: ARCH_ID.1 R9.1 XIO.129(-CFG:PG2)
ARCH1: ARCH_ID.2 R8.1 XIO.130(-CFG:PG3)
ARCH2: ARCH_ID.3 R7.1 XIO.133(-CFG:PG6)
ARCH3: ARCH_ID.4 R6.1 XIO.134(-CFG:PG7)
GND: R6.2 R7.2 R8.2 R9.2 R14.2 R15.2 R16.2 R17.2 R18.2 ; also sheet 2,4,5,6,7,8,9,10,11,13,14,15,16
MEM0: MEM_ID.1 R18.1 XIO.179(-CFG:PG10)
MEM1: MEM_ID.2 R17.1 XIO.180(-CFG:PG11)
PID0: PID.1 R16.1 XIO.7(-CFG:PI8)
PID1: PID.2 R15.1 XIO.13(-CFG:PI11)
PID2: PID.3 R14.1 XIO.21(-CFG:PI14)

### Buses
PID:PID0,PID1,PID2
MEMORY_ID:MEM0,MEM1
ARCH:ARCH[0..3]

### Notes on the sheet
- Architecture selection
- Memory-emulation selection
- Peripheral-ID selection
- Board config

## Sheet 13 of 16: FPGA Power
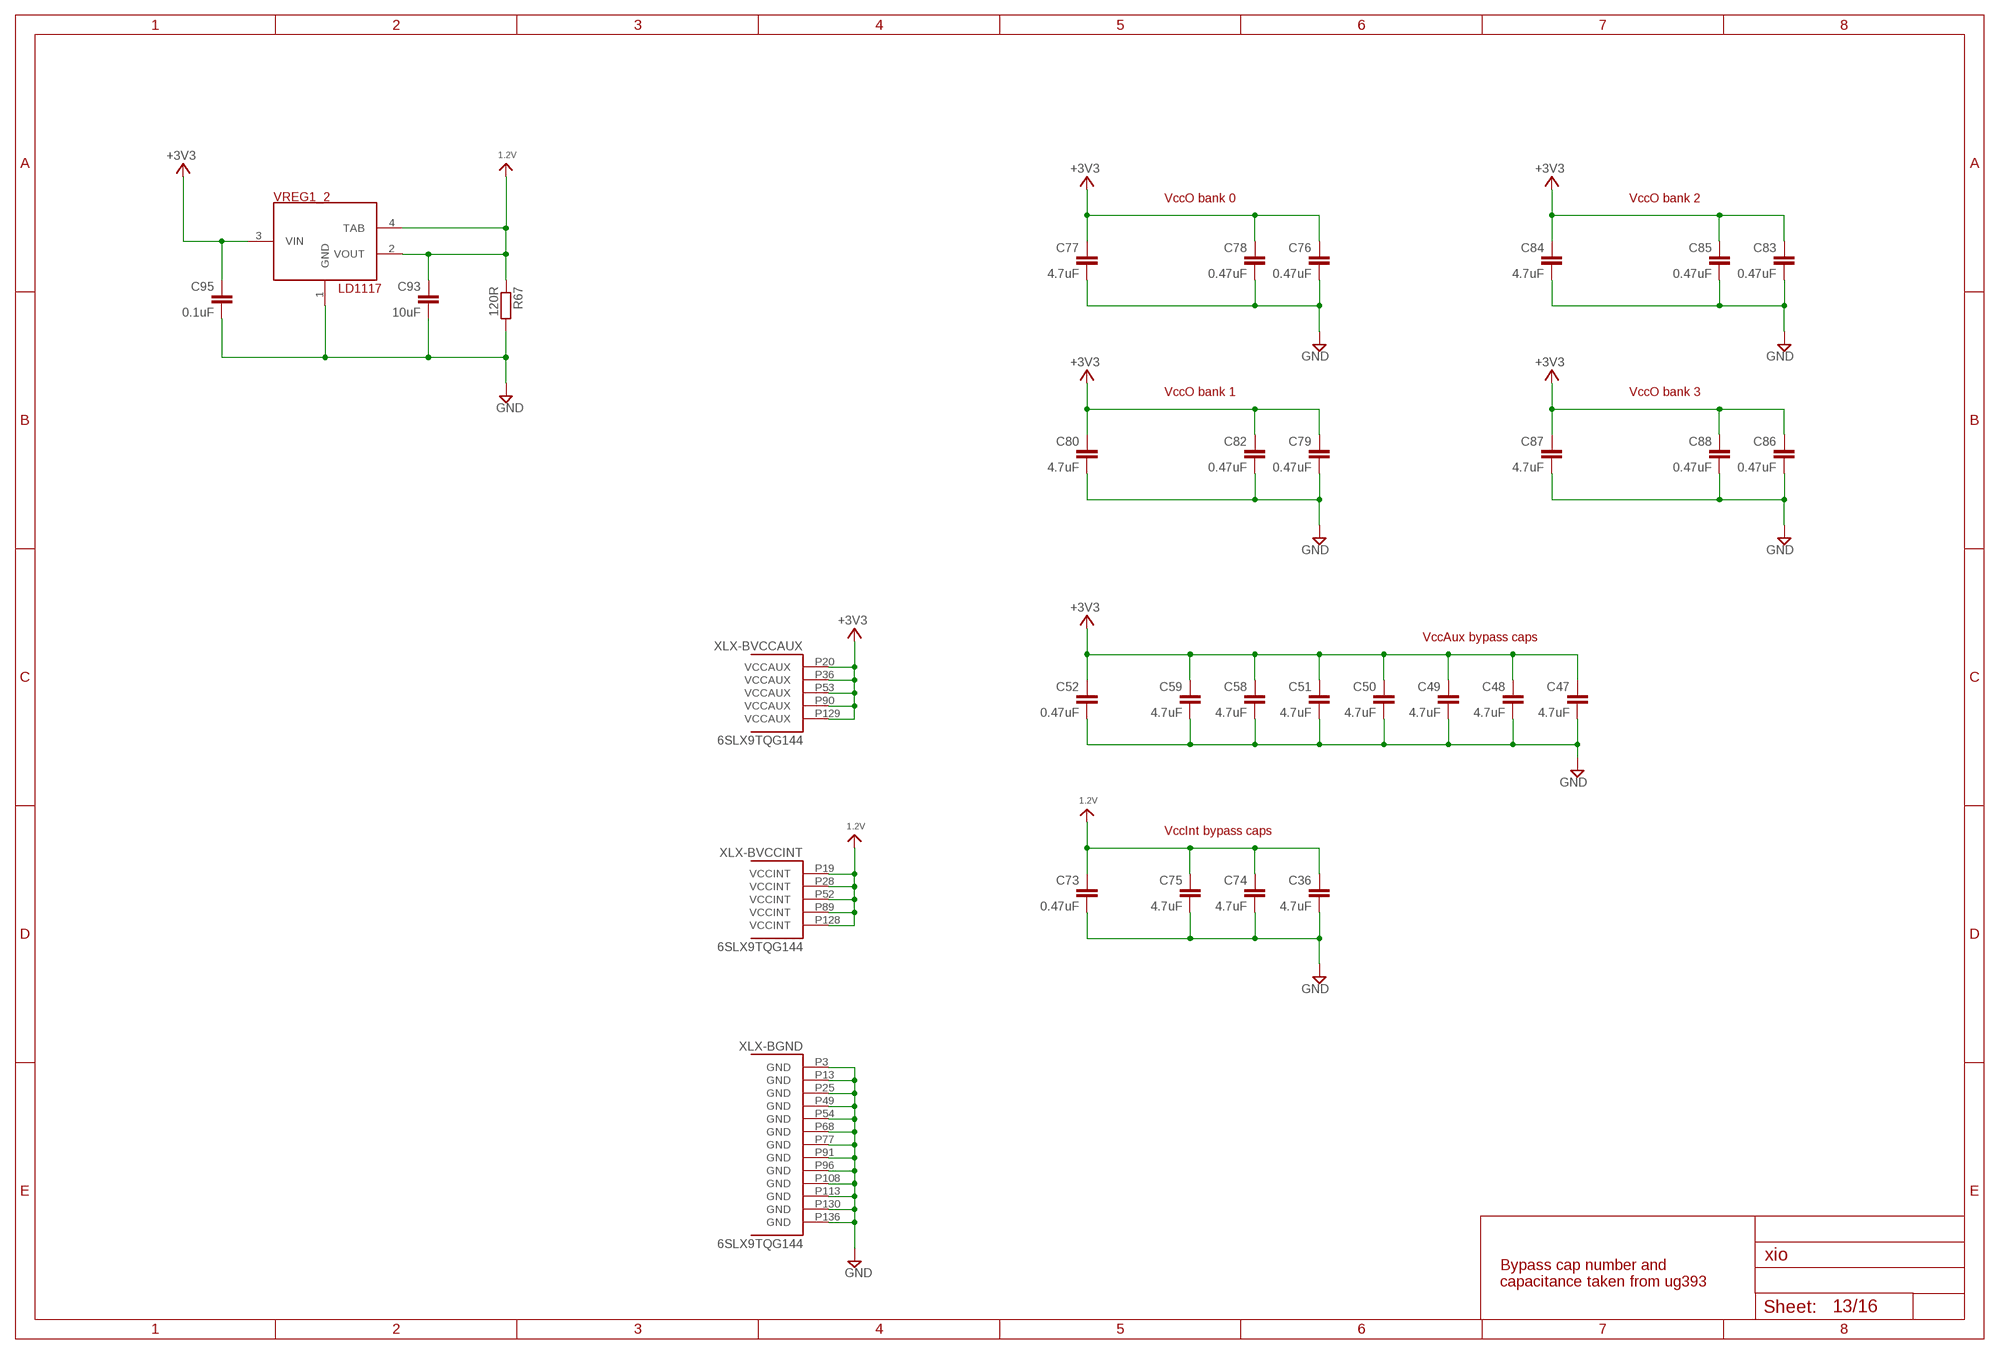
[diagram p14: schematic, sheet 13]

### Parts
C36  4.7uF  C-EUC0402K  [C0402K]
C47  4.7uF  C-EUC0402K  [C0402K]
C48  4.7uF  C-EUC0402K  [C0402K]
C49  4.7uF  C-EUC0402K  [C0402K]
C50  4.7uF  C-EUC0402K  [C0402K]
C51  4.7uF  C-EUC0402K  [C0402K]
C52  0.47uF  C-EUC0402K  [C0402K]
C58  4.7uF  C-EUC0402K  [C0402K]
C59  4.7uF  C-EUC0402K  [C0402K]
C73  0.47uF  C-EUC0402K  [C0402K]
C74  4.7uF  C-EUC0402K  [C0402K]
C75  4.7uF  C-EUC0402K  [C0402K]
C76  0.47uF  C-EUC0402K  [C0402K]
C77  4.7uF  C-EUC0402K  [C0402K]
C78  0.47uF  C-EUC0402K  [C0402K]
C79  0.47uF  C-EUC0402K  [C0402K]
C80  4.7uF  C-EUC0402K  [C0402K]
C82  0.47uF  C-EUC0402K  [C0402K]
C83  0.47uF  C-EUC0402K  [C0402K]
C84  4.7uF  C-EUC0402K  [C0402K]
C85  0.47uF  C-EUC0402K  [C0402K]
C86  0.47uF  C-EUC0402K  [C0402K]
C87  4.7uF  C-EUC0402K  [C0402K]
C88  0.47uF  C-EUC0402K  [C0402K]
C93  10uF  C-EUC0402K  [C0402K]
C95  0.1uF  C-EUC0402K  [C0402K]
R67  120R  R-EU_R0402  [R0402]
VREG1_2  LD1117  [SOT223]
XLX-  6SLX9TQG144  [TQ144]

### Nets
1.2V: C36.1 C73.1 C74.1 C75.1 C93.1 R67.1 VREG1_2.2(VOUT) VREG1_2.4(TAB) XLX-.P19(BVCCINT:VCCINT) XLX-.P28(BVCCINT:VCCINT) XLX-.P52(BVCCINT:VCCINT) XLX-.P89(BVCCINT:VCCINT) XLX-.P128(BVCCINT:VCCINT)
+3V3 [3v3]: C47.1 C48.1 C49.1 C50.1 C51.1 C52.1 C58.1 C59.1 C76.1 C77.1 C78.1 C79.1 C80.1 C82.1 C83.1 C84.1 C85.1 C86.1 C87.1 C88.1 C95.1 VREG1_2.3(VIN) XLX-.P20(BVCCAUX:VCCAUX) XLX-.P36(BVCCAUX:VCCAUX) XLX-.P53(BVCCAUX:VCCAUX) XLX-.P90(BVCCAUX:VCCAUX) XLX-.P129(BVCCAUX:VCCAUX) ; also sheet 2,4,5,6,11,12,14,15,16
GND: C36.2 C47.2 C48.2 C49.2 C50.2 C51.2 C52.2 C58.2 C59.2 C73.2 C74.2 C75.2 C76.2 C77.2 C78.2 C79.2 C80.2 C82.2 C83.2 C84.2 C85.2 C86.2 C87.2 C88.2 C93.2 C95.2 R67.2 VREG1_2.1(GND) XLX-.P3(BGND:GND) XLX-.P13(BGND:GND) XLX-.P25(BGND:GND) XLX-.P49(BGND:GND) XLX-.P54(BGND:GND) XLX-.P68(BGND:GND) XLX-.P77(BGND:GND) XLX-.P91(BGND:GND) XLX-.P96(BGND:GND) XLX-.P108(BGND:GND) XLX-.P113(BGND:GND) XLX-.P130(BGND:GND) XLX-.P136(BGND:GND) ; also sheet 2,4,5,6,7,8,9,10,11,12,14,15,16

### Notes on the sheet
- VccO bank 0 | VccO bank 2
- VccO bank 1 | VccO bank 3
- VccAux bypass caps
- VccInt bypass caps
- Bypass cap number and
  capacitance taken from ug393

## Sheet 14 of 16: FPGA Clock, Banks 0,1
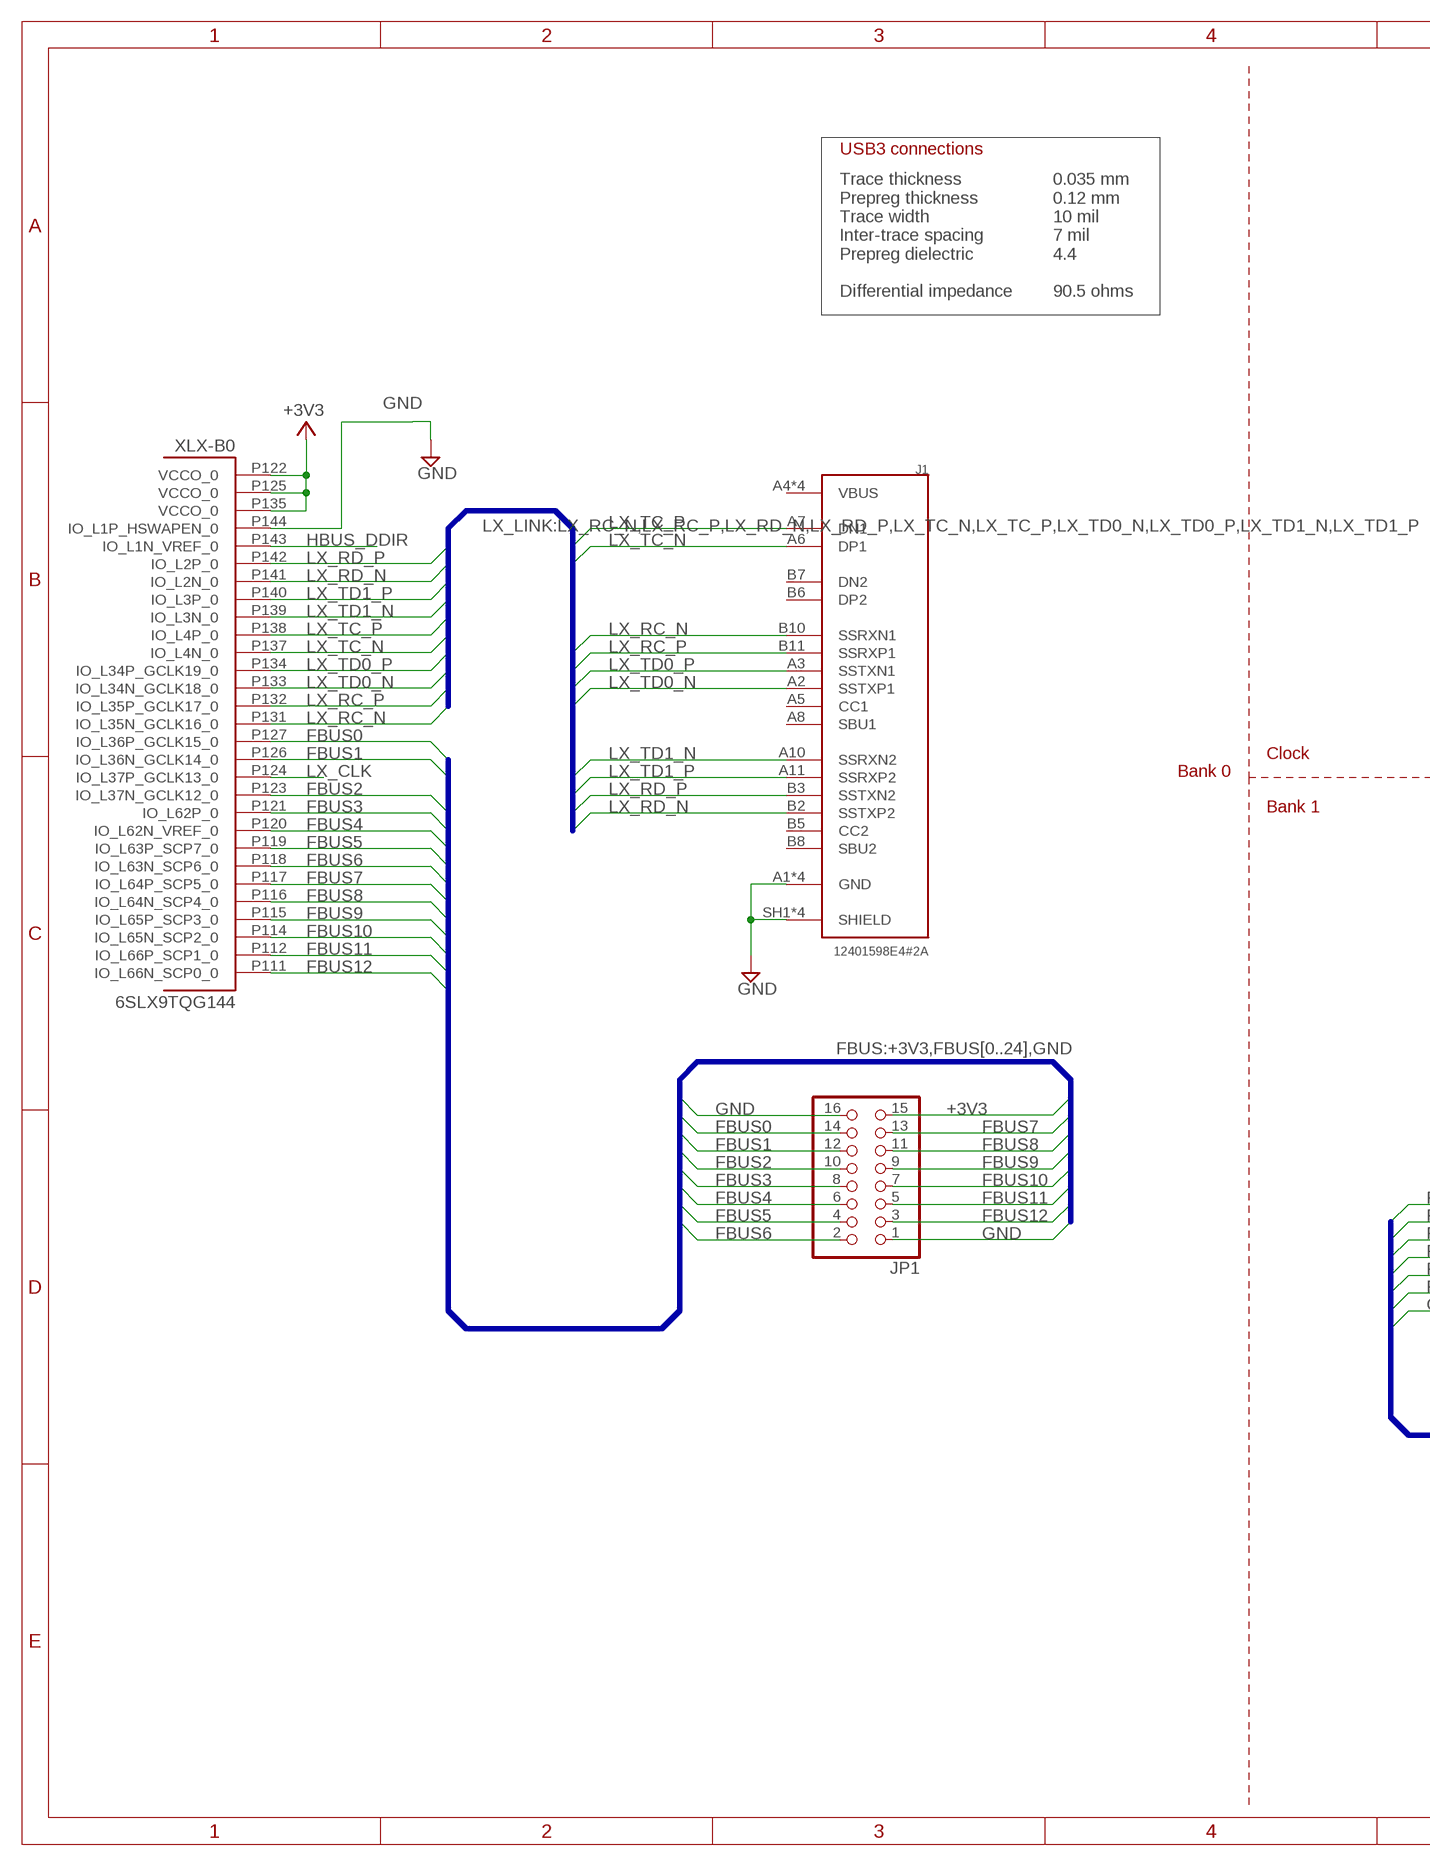
[diagram p15: schematic, sheet 14, part 1 of 2]
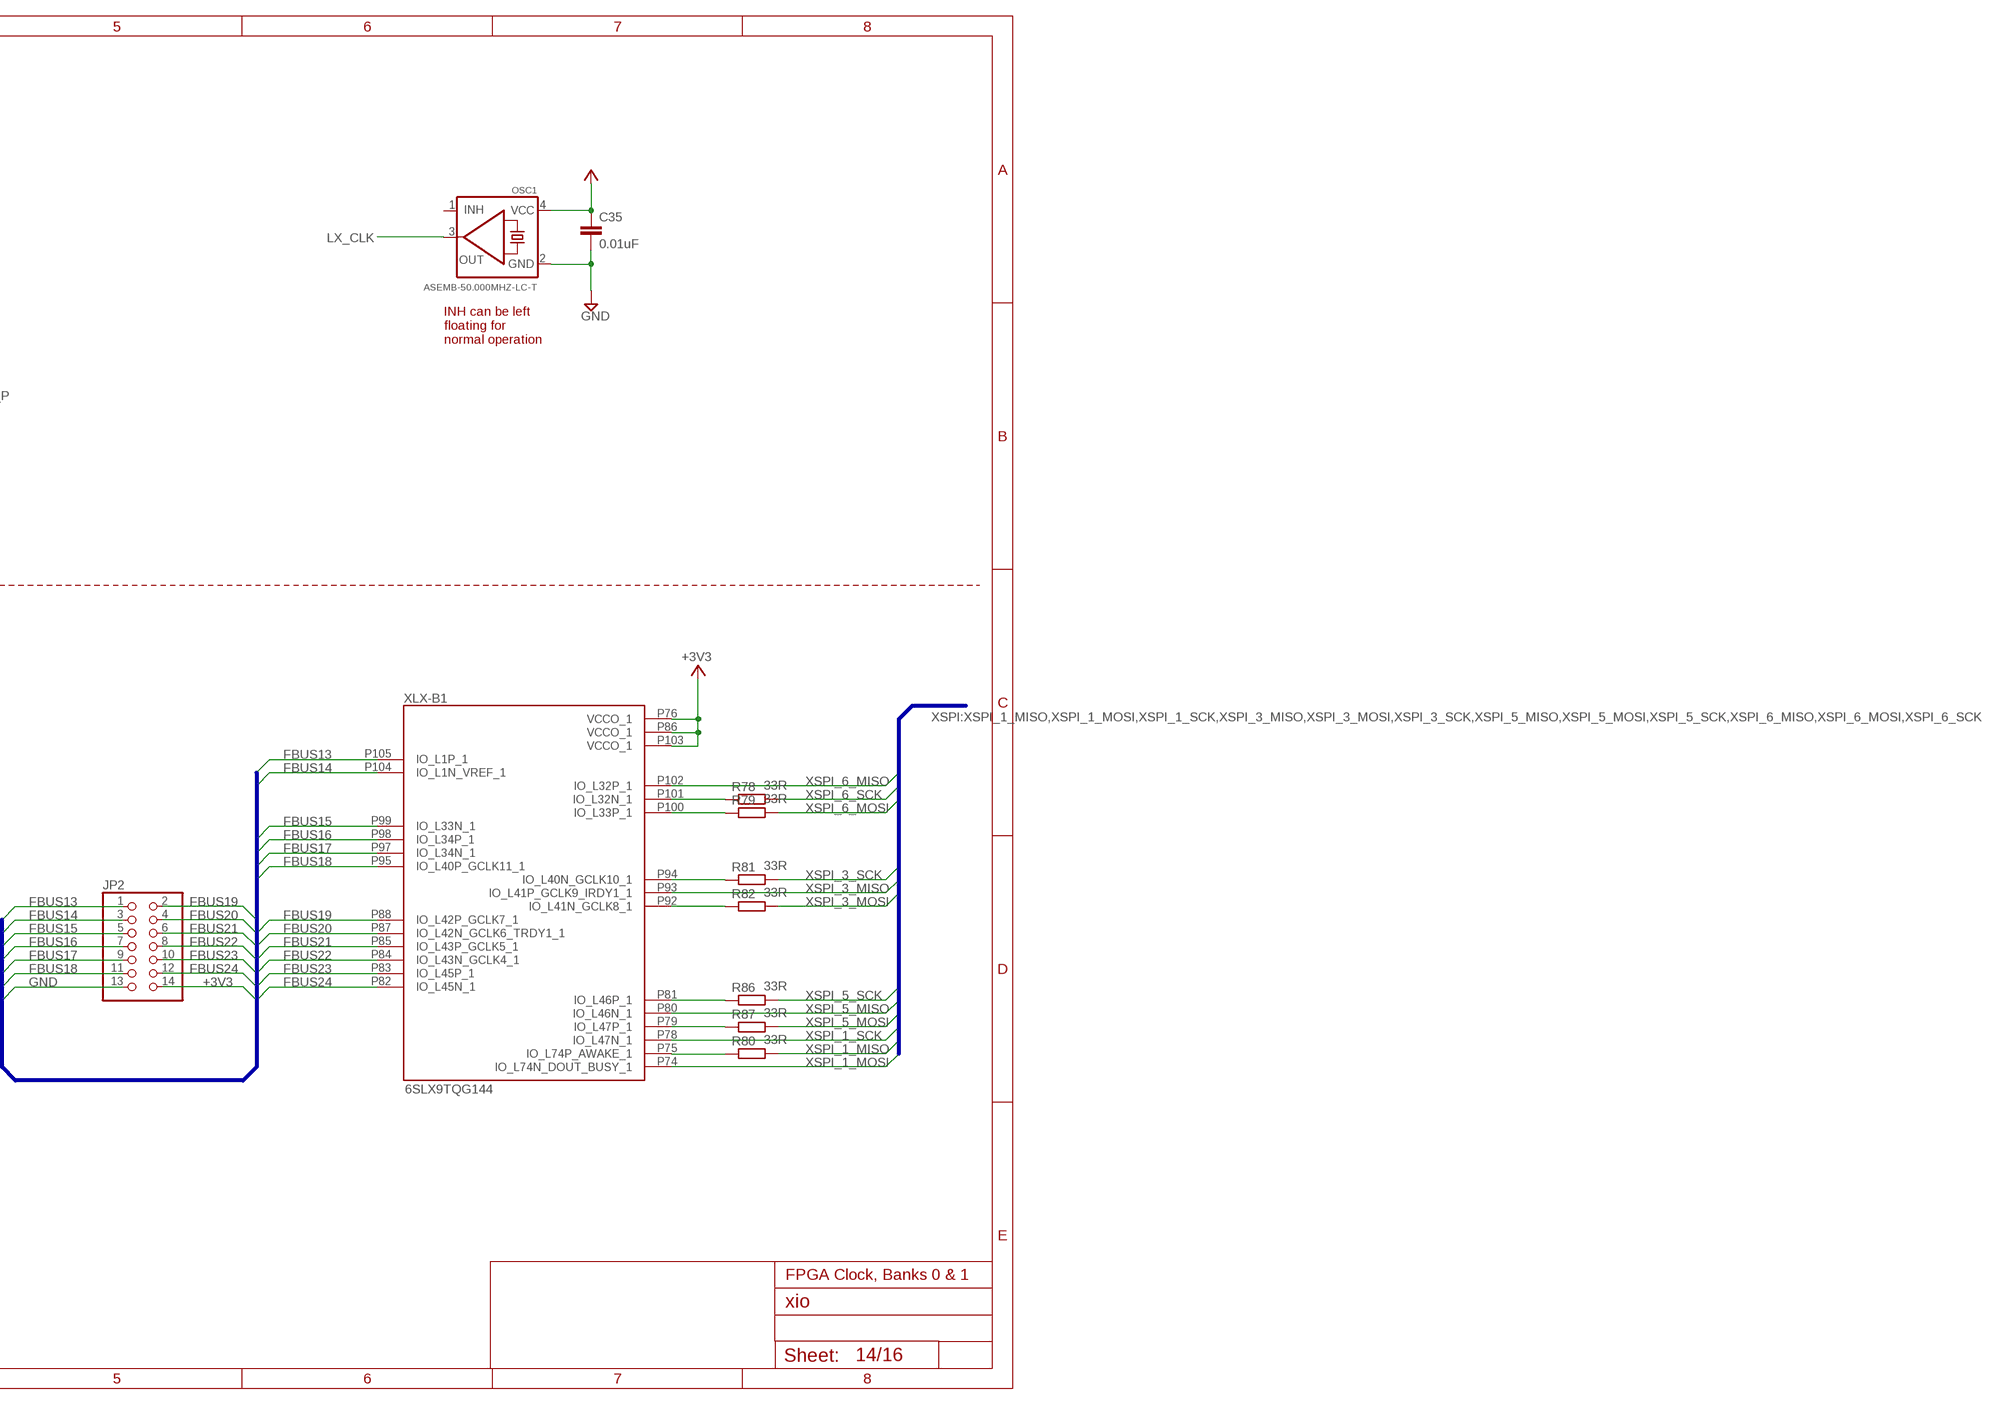
[diagram p16: schematic, sheet 14, part 2 of 2]

### Parts
C35  0.01uF  C-EUC0402K  [C0402K]
J1  12401598E4#2A  [AMPHENOL_12401598E4#2A]
JP1  PINHD-2X8  [2X08]
JP2  PINHD-2X7  [2X07]
OSC1  ASEMB-50.000MHZ-LC-T  OSCILLATOR3.2X2.5  [OSC_3.2X2.5MM]
R78  33R  R-EU_R0402  [R0402]
R79  33R  R-EU_R0402  [R0402]
R80  33R  R-EU_R0402  [R0402]
R81  33R  R-EU_R0402  [R0402]
R82  33R  R-EU_R0402  [R0402]
R86  33R  R-EU_R0402  [R0402]
R87  33R  R-EU_R0402  [R0402]

### Nets
+3V3 [3v3]: C35.1 JP1.15 JP2.14 OSC1.4(VCC) XLX-.P76(B1:VCCO_1) XLX-.P86(B1:VCCO_1) XLX-.P103(B1:VCCO_1) XLX-.P122(B0:VCCO_0) XLX-.P125(B0:VCCO_0) XLX-.P135(B0:VCCO_0) ; also sheet 2,4,5,6,11,12,13,15,16
FBUS0: JP1.14 XLX-.P127(B0:IO_L36P_GCLK15_0)
FBUS1: JP1.12 XLX-.P126(B0:IO_L36N_GCLK14_0)
FBUS2: JP1.10 XLX-.P123(B0:IO_L37N_GCLK12_0)
FBUS3: JP1.8 XLX-.P121(B0:IO_L62P_0)
FBUS4: JP1.6 XLX-.P120(B0:IO_L62N_VREF_0)
FBUS5: JP1.4 XLX-.P119(B0:IO_L63P_SCP7_0)
FBUS6: JP1.2 XLX-.P118(B0:IO_L63N_SCP6_0)
FBUS7: JP1.13 XLX-.P117(B0:IO_L64P_SCP5_0)
FBUS8: JP1.11 XLX-.P116(B0:IO_L64N_SCP4_0)
FBUS9: JP1.9 XLX-.P115(B0:IO_L65P_SCP3_0)
FBUS10: JP1.7 XLX-.P114(B0:IO_L65N_SCP2_0)
FBUS11: JP1.5 XLX-.P112(B0:IO_L66P_SCP1_0)
FBUS12: JP1.3 XLX-.P111(B0:IO_L66N_SCP0_0)
FBUS13: JP2.1 XLX-.P105(B1:IO_L1P_1)
FBUS14: JP2.3 XLX-.P104(B1:IO_L1N_VREF_1)
FBUS15: JP2.5 XLX-.P99(B1:IO_L33N_1)
FBUS16: JP2.7 XLX-.P98(B1:IO_L34P_1)
FBUS17: JP2.9 XLX-.P97(B1:IO_L34N_1)
FBUS18: JP2.11 XLX-.P95(B1:IO_L40P_GCLK11_1)
FBUS19: JP2.2 XLX-.P88(B1:IO_L42P_GCLK7_1)
FBUS20: JP2.4 XLX-.P87(B1:IO_L42N_GCLK6_TRDY1_1)
FBUS21: JP2.6 XLX-.P85(B1:IO_L43P_GCLK5_1)
FBUS22: JP2.8 XLX-.P84(B1:IO_L43N_GCLK4_1)
FBUS23: JP2.10 XLX-.P83(B1:IO_L45P_1)
FBUS24: JP2.12 XLX-.P82(B1:IO_L45N_1)
GND: C35.2 J1.A1(GND) J1.A12(GND) J1.B1(GND) J1.B12(GND) J1.SH1(SHIELD) J1.SH2(SHIELD) J1.SH3(SHIELD) J1.SH4(SHIELD) JP1.1 JP1.16 JP2.13 OSC1.2(GND) XLX-.P144(B0:IO_L1P_HSWAPEN_0) ; also sheet 2,4,5,6,7,8,9,10,11,12,13,15,16
HBUS_DDIR: XLX-.P143(B0:IO_L1N_VREF_0) ; also sheet 16
LX_CLK: OSC1.3(OUT) XLX-.P124(B0:IO_L37P_GCLK13_0)
LX_RC_N [usb90]: J1.B10(SSRXN1) XLX-.P131(B0:IO_L35N_GCLK16_0)
LX_RC_P [usb90]: J1.B11(SSRXP1) XLX-.P132(B0:IO_L35P_GCLK17_0)
LX_RD_N [usb90]: J1.B2(SSTXP2) XLX-.P141(B0:IO_L2N_0)
LX_RD_P [usb90]: J1.B3(SSTXN2) XLX-.P142(B0:IO_L2P_0)
LX_TC_N [usb90]: J1.A6(DP1) XLX-.P137(B0:IO_L4N_0)
LX_TC_P [usb90]: J1.A7(DN1) XLX-.P138(B0:IO_L4P_0)
LX_TD0_N [usb90]: J1.A2(SSTXP1) XLX-.P133(B0:IO_L34N_GCLK18_0)
LX_TD0_P [usb90]: J1.A3(SSTXN1) XLX-.P134(B0:IO_L34P_GCLK19_0)
LX_TD1_N [usb90]: J1.A10(SSRXN2) XLX-.P139(B0:IO_L3N_0)
LX_TD1_P [usb90]: J1.A11(SSRXP2) XLX-.P140(B0:IO_L3P_0)
N$7: R82.1 XLX-.P92(B1:IO_L41N_GCLK8_1)
N$11: R81.1 XLX-.P94(B1:IO_L40N_GCLK10_1)
N$77: R79.1 XLX-.P100(B1:IO_L33P_1)
N$78: R78.1 XLX-.P101(B1:IO_L32N_1)
N$79: R80.1 XLX-.P75(B1:IO_L74P_AWAKE_1)
N$80: R86.1 XLX-.P81(B1:IO_L46P_1)
N$81: R87.1 XLX-.P79(B1:IO_L47P_1)
XSPI_1_MISO: R80.2 ; also sheet 3
XSPI_1_MOSI: XLX-.P74(B1:IO_L74N_DOUT_BUSY_1) ; also sheet 3
XSPI_1_SCK: XLX-.P78(B1:IO_L47N_1) ; also sheet 3
XSPI_3_MISO: XLX-.P93(B1:IO_L41P_GCLK9_IRDY1_1) ; also sheet 3
XSPI_3_MOSI: R82.2 ; also sheet 3
XSPI_3_SCK: R81.2 ; also sheet 3
XSPI_5_MISO: XLX-.P80(B1:IO_L46N_1) ; also sheet 3
XSPI_5_MOSI: R87.2 ; also sheet 3
XSPI_5_SCK: R86.2 ; also sheet 3
XSPI_6_MISO: XLX-.P102(B1:IO_L32P_1) ; also sheet 3
XSPI_6_MOSI: R79.2 ; also sheet 3
XSPI_6_SCK: R78.2 ; also sheet 3
Unconnected: J1.A4(VBUS) J1.A5(CC1) J1.A8(SBU1) J1.A9(VBUS) J1.B4(VBUS) J1.B5(CC2) J1.B6(DP2) J1.B7(DN2) J1.B8(SBU2) J1.B9(VBUS) OSC1.1(INH)

### Buses
LX_LINK:LX_RC_N,LX_RC_P,LX_RD_N,LX_RD_P,LX_TC_N,LX_TC_P,LX_TD0_N,LX_TD0_P,LX_TD1_N,LX_TD1_P
XSPI:XSPI_1_MISO,XSPI_1_MOSI,XSPI_1_SCK,XSPI_3_MISO,XSPI_3_MOSI,XSPI_3_SCK,XSPI_5_MISO,XSPI_5_MOSI,XSPI_5_SCK,XSPI_6_MISO,XSPI_6_MOSI,XSPI_6_SCK
FBUS:+3V3,FBUS[0..24],GND

### Notes on the sheet
- USB3 connections
- Trace thickness
  Prepreg thickness
  Trace width
  Inter-trace spacing
  Prepreg dielectric
  
  Differential impedance
- 0.035 mm
  0.12 mm
  10 mil
  7 mil
  4.4
  
  90.5 ohms
- INH can be left
  floating for
  normal operation
- Clock
- Bank 0
- Bank 1
- FPGA Clock, Banks 0 & 1

## Sheet 15 of 16: FPGA Bank2
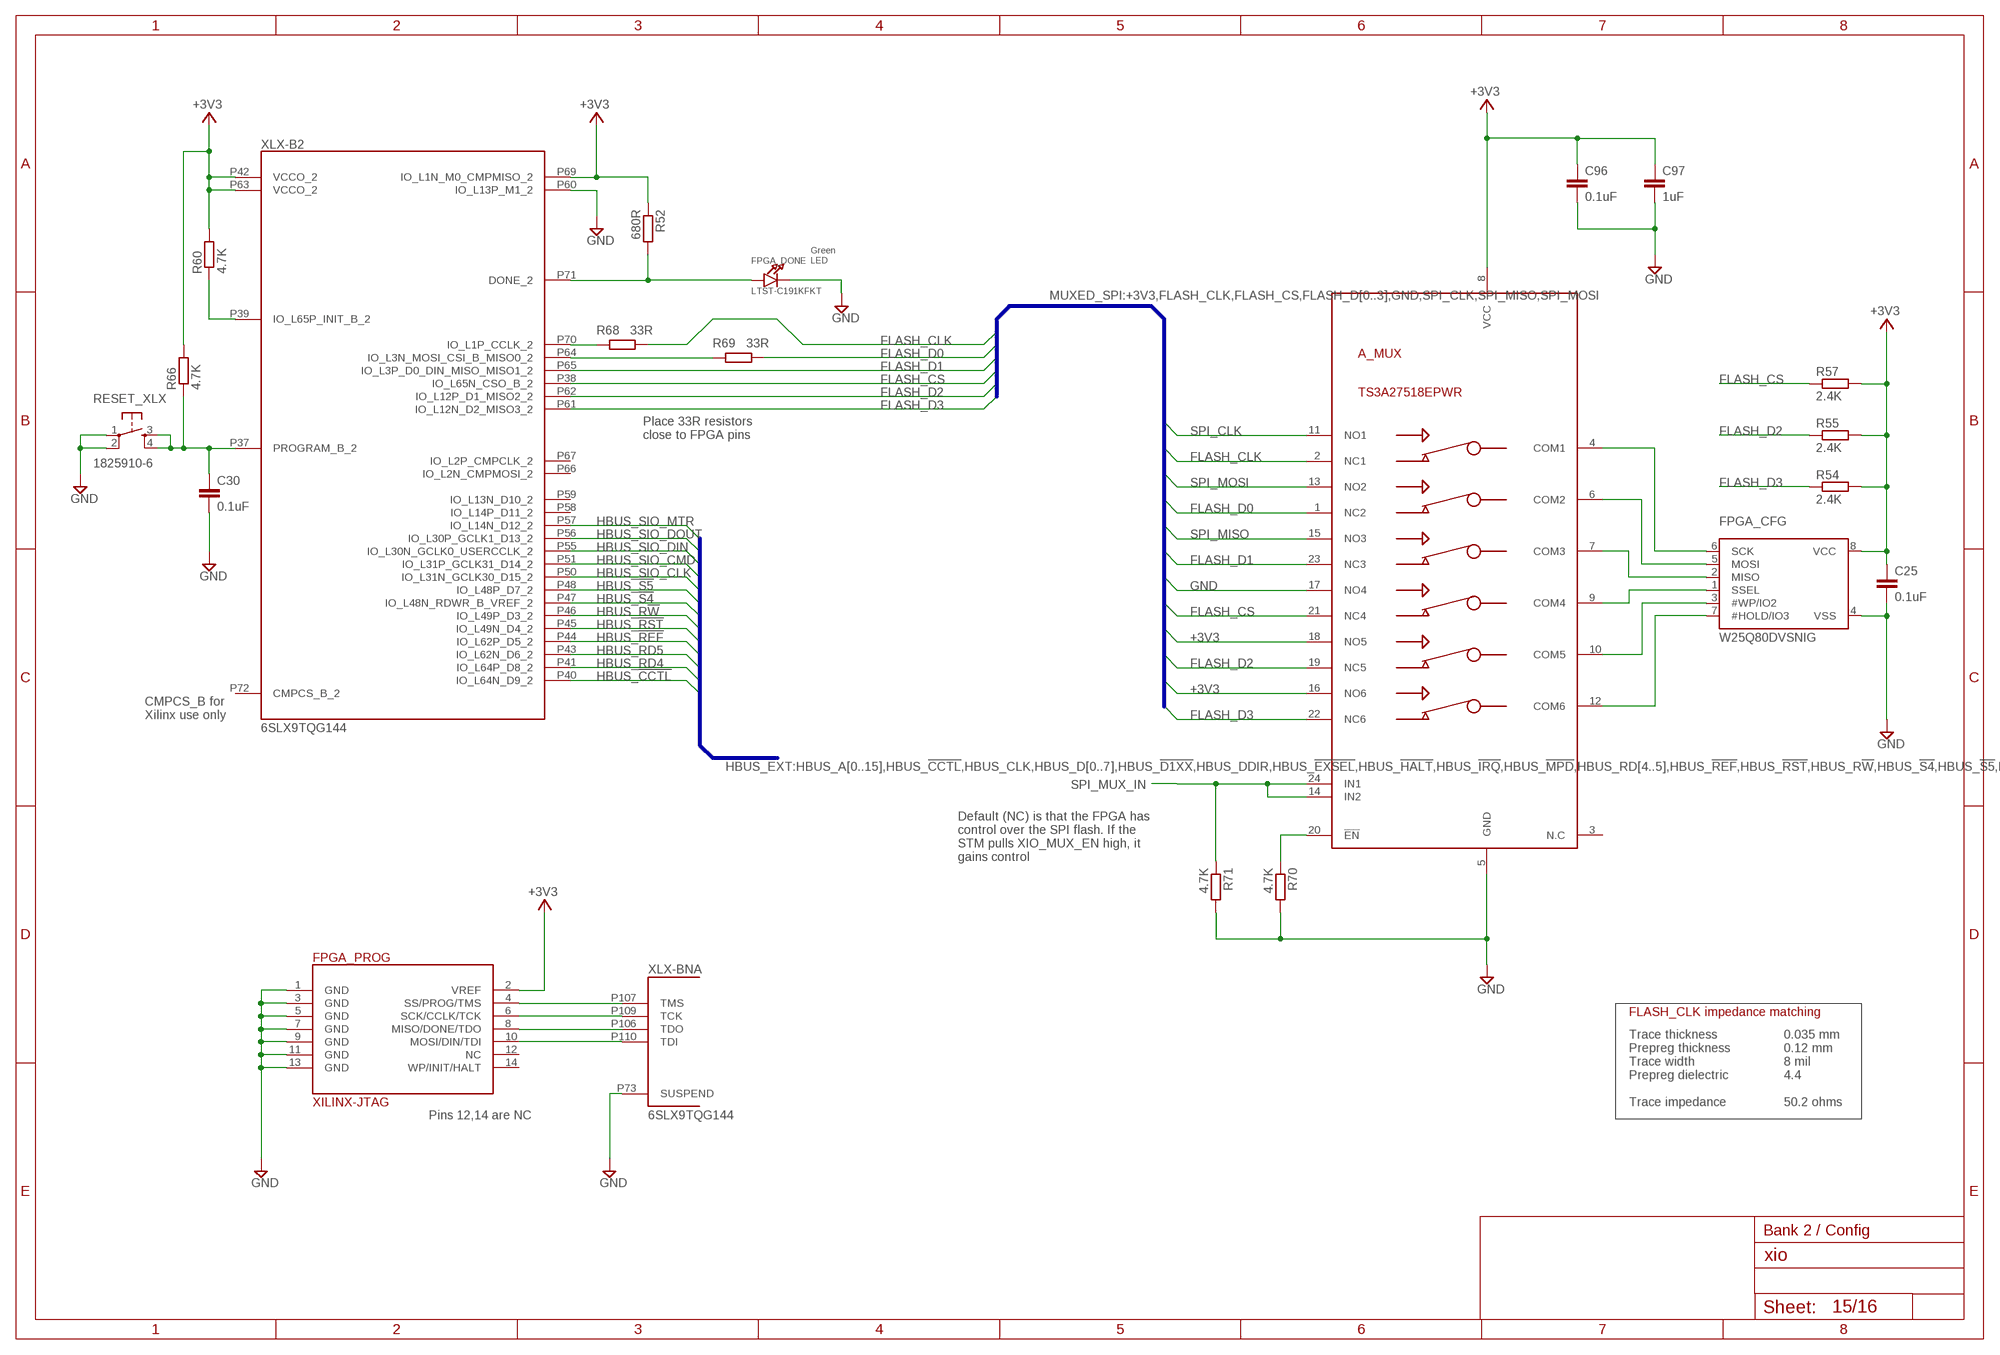
[diagram p17: schematic, sheet 15]

### Parts
A_MUX  TS3A27518EPWR  TS3A27518E  [TSSOP24]
C25  0.1uF  C-EUC0402K  [C0402K]
C30  0.1uF  C-EUC0402K  [C0402K]
C96  0.1uF  C-EUC0402K  [C0402K]
C97  1uF  C-EUC0402K  [C0402K]
FPGA_CFG  W25Q80DVSNIG  SPIFLASH_SOIC8  [SOIC8_150MIL]
FPGA_DONE  LTST-C191KFKT  LED0603  [CHIPLED_0603]
FPGA_PROG  XILINX-JTAG  [332-14]
R52  680R  R-EU_R0402  [R0402]
R54  2.4K  R-EU_R0402  [R0402]
R55  2.4K  R-EU_R0402  [R0402]
R57  2.4K  R-EU_R0402  [R0402]
R60  4.7K  R-EU_R0402  [R0402]
R66  4.7K  R-EU_R0402  [R0402]
R68  33R  R-EU_R0402  [R0402]
R69  33R  R-EU_R0402  [R0402]
R70  4.7K  R-EU_R0402  [R0402]
R71  4.7K  R-EU_R0402  [R0402]
RESET_XLX  1825910-6  TAC_SWITCHPTH  [TACTILE-PTH]

### Nets
+3V3 [3v3]: A_MUX.8(VCC) A_MUX.16(NO6) A_MUX.18(NO5) C25.1 C96.1 C97.1 FPGA_CFG.8(VCC) FPGA_PROG.2(VREF) R52.1 R54.2 R55.2 R57.2 R60.2 R66.2 XLX-.P42(B2:VCCO_2) XLX-.P63(B2:VCCO_2) XLX-.P69(B2:IO_L1N_M0_CMPMISO_2) ; also sheet 2,4,5,6,11,12,13,14,16
FLASH_CLK [cclk50]: A_MUX.2(NC1) R68.2
FLASH_CS: A_MUX.21(NC4) R57.1 XLX-.P38(B2:IO_L65N_CSO_B_2)
FLASH_D0: A_MUX.1(NC2) R69.2
FLASH_D1: A_MUX.23(NC3) XLX-.P65(B2:IO_L3P_D0_DIN_MISO_MISO1_2)
FLASH_D2: A_MUX.19(NC5) R55.1 XLX-.P62(B2:IO_L12P_D1_MISO2_2)
FLASH_D3: A_MUX.22(NC6) R54.1 XLX-.P61(B2:IO_L12N_D2_MISO3_2)
GND: A_MUX.5(GND) A_MUX.17(NO4) C25.2 C30.2 C96.2 C97.2 FPGA_CFG.4(VSS) FPGA_DONE.C FPGA_PROG.1(GND) FPGA_PROG.3(GND) FPGA_PROG.5(GND) FPGA_PROG.7(GND) FPGA_PROG.9(GND) FPGA_PROG.11(GND) FPGA_PROG.13(GND) R70.2 R71.2 RESET_XLX.1 RESET_XLX.2 XLX-.P60(B2:IO_L13P_M1_2) XLX-.P73(BNA:SUSPEND) ; also sheet 2,4,5,6,7,8,9,10,11,12,13,14,16
HBUS_!CCTL!: XLX-.P40(B2:IO_L64N_D9_2) ; also sheet 16
HBUS_!REF!: XLX-.P44(B2:IO_L62P_D5_2) ; also sheet 8,9,10
HBUS_!RST!: XLX-.P45(B2:IO_L49N_D4_2) ; also sheet 8,9,10
HBUS_!S4!: XLX-.P47(B2:IO_L48N_RDWR_B_VREF_2) ; also sheet 16
HBUS_!S5!: XLX-.P48(B2:IO_L48P_D7_2) ; also sheet 16
HBUS_R!W!: XLX-.P46(B2:IO_L49P_D3_2) ; also sheet 8,9,10,16
HBUS_RD4: XLX-.P41(B2:IO_L64P_D8_2) ; also sheet 8,9,10,16
HBUS_RD5: XLX-.P43(B2:IO_L62N_D6_2) ; also sheet 8,9,10,16
HBUS_SIO_CLK: XLX-.P50(B2:IO_L31N_GCLK30_D15_2) ; also sheet 8,9,10
HBUS_SIO_CMD: XLX-.P51(B2:IO_L31P_GCLK31_D14_2) ; also sheet 8,9,10
HBUS_SIO_DIN: XLX-.P55(B2:IO_L30N_GCLK0_USERCCLK_2) ; also sheet 8,9,10
HBUS_SIO_DOUT: XLX-.P56(B2:IO_L30P_GCLK1_D13_2) ; also sheet 8,9,10
HBUS_SIO_MTR: XLX-.P57(B2:IO_L14N_D12_2) ; also sheet 8,9,10
N$4 [cclk50]: A_MUX.4(COM1) FPGA_CFG.6(SCK)
N$48: FPGA_DONE.A R52.2 XLX-.P71(B2:DONE_2)
N$49: R60.1 XLX-.P39(B2:IO_L65P_INIT_B_2)
N$50: C30.1 R66.1 RESET_XLX.3 RESET_XLX.4 XLX-.P37(B2:PROGRAM_B_2)
N$51: FPGA_PROG.4(SS/PROG/TMS) XLX-.P107(BNA:TMS)
N$52: FPGA_PROG.6(SCK/CCLK/TCK) XLX-.P109(BNA:TCK)
N$55: FPGA_PROG.8(MISO/DONE/TDO) XLX-.P106(BNA:TDO)
N$56: FPGA_PROG.10(MOSI/DIN/TDI) XLX-.P110(BNA:TDI)
N$62: A_MUX.6(COM2) FPGA_CFG.5(MOSI)
N$63: A_MUX.7(COM3) FPGA_CFG.2(MISO)
N$66: A_MUX.9(COM4) FPGA_CFG.1(SSEL)
N$67: A_MUX.10(COM5) FPGA_CFG.3(#WP/IO2)
N$68: A_MUX.12(COM6) FPGA_CFG.7(#HOLD/IO3)
N$69: R68.1 XLX-.P70(B2:IO_L1P_CCLK_2)
N$70: R69.1 XLX-.P64(B2:IO_L3N_MOSI_CSI_B_MISO0_2)
N$71: A_MUX.20(!EN!) R70.1
SPI_CLK: A_MUX.11(NO1) ; also sheet 3,8,9,10
SPI_MISO: A_MUX.15(NO3) ; also sheet 3,8,9,10
SPI_MOSI: A_MUX.13(NO2) ; also sheet 3,8,9,10
SPI_MUX_IN: A_MUX.14(IN2) A_MUX.24(IN1) R71.1 ; also sheet 3
Unconnected: A_MUX.3(N.C) FPGA_PROG.12(NC) FPGA_PROG.14(WP/INIT/HALT) XLX-.P58(B2:IO_L14P_D11_2) XLX-.P59(B2:IO_L13N_D10_2) XLX-.P66(B2:IO_L2N_CMPMOSI_2) XLX-.P67(B2:IO_L2P_CMPCLK_2) XLX-.P72(B2:CMPCS_B_2)

### Buses
HBUS_EXT:HBUS_A[0..15],HBUS_!CCTL!,HBUS_CLK,HBUS_D[0..7],HBUS_!D1XX!,HBUS_DDIR,HBUS_!EXSEL!,HBUS_!HALT!,HBUS_!IRQ!,HBUS_!MPD!,HBUS_RD[4..5],HBUS_!REF!,HBUS_!RST!,HBUS_R!W!,HBUS_!S4!,HBUS_!S5!,HBUS_SIO_CLK,HBUS_SIO_CMD,HBUS_SIO_DIN,HBUS_SIO_DOUT,HBUS_SIO_MTR
MUXED_SPI:+3V3,FLASH_CLK,FLASH_CS,FLASH_D[0..3],GND,SPI_CLK,SPI_MISO,SPI_MOSI

### Notes on the sheet
- Green
   LED
- Place 33R resistors
  close to FPGA pins
- CMPCS_B for 
  Xilinx use only
- Default (NC) is that the FPGA has
  control over the SPI flash. If the
  STM pulls XIO_MUX_EN high, it
  gains control
- FLASH_CLK impedance matching
- Trace thickness
  Prepreg thickness
  Trace width
  Prepreg dielectric
  
  Trace impedance
- 0.035 mm
  0.12 mm
  8 mil
  4.4
  
  50.2 ohms
- Pins 12,14 are NC
- Bank 2 / Config